# Altium project rev02.PrjPcb (part 1 of 2)
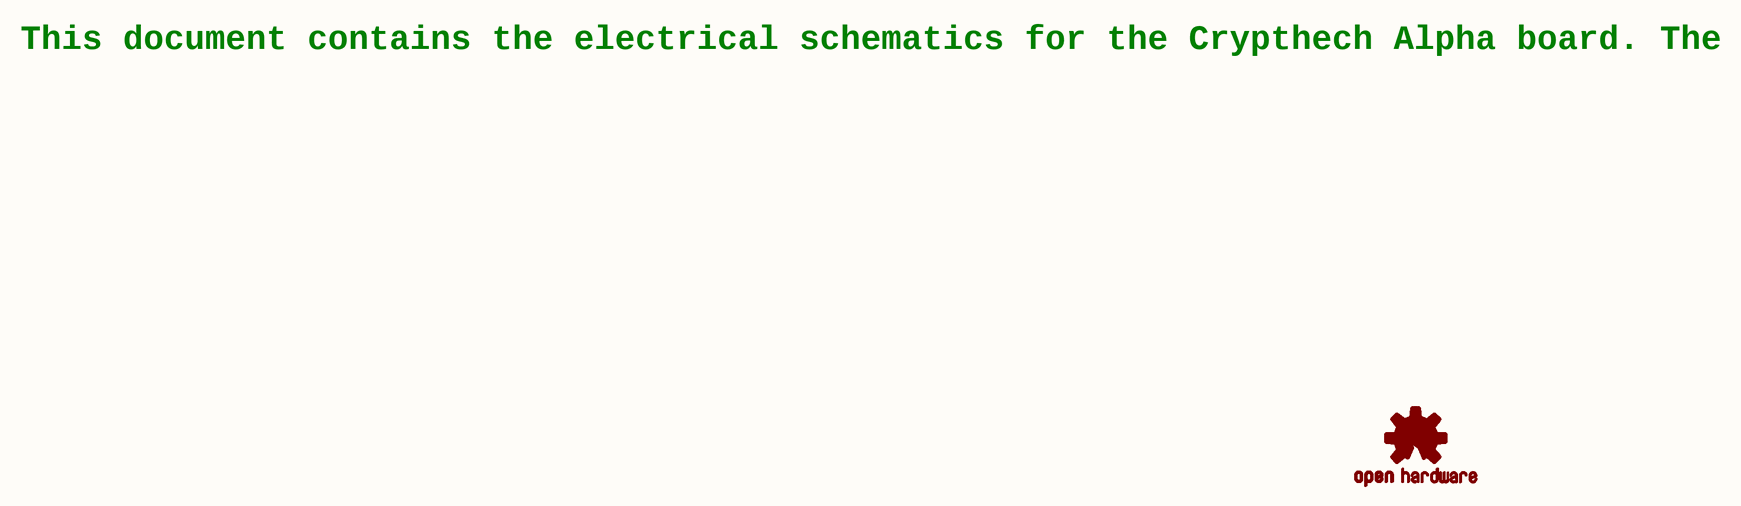
[diagram p0: rev02_0.SchDoc]
26 sheets, 386 parts. Net scope: global (net labels, ports and power ports of the same name join across sheets).
Board file: CrypTech.PcbDoc
Sheets:
  rev02_0.SchDoc
  rev02_1.SchDoc
  rev02_2.SchDoc
  rev02_3.SchDoc
  rev02_4.SchDoc
  rev02_5.SchDoc
  rev02_6.SchDoc
  rev02_7.SchDoc
  rev02_8.SchDoc
  rev02_9.SchDoc
  rev02_10.SchDoc
  rev02_11.SchDoc
  rev02_12.SchDoc
  rev02_13.SchDoc
  rev02_14.SchDoc
  rev02_15.SchDoc
  rev02_16.SchDoc
  rev02_17.SchDoc
  rev02_18.SchDoc
  rev02_19.SchDoc
  rev02_20.SchDoc
  rev02_21.SchDoc
  rev02_22.SchDoc
  rev02_23.SchDoc
  rev02_24.SchDoc
  rev02_25.SchDoc

## Sheet rev02_0.SchDoc
size 409 x 282 mm

### Parts
LOGO1  OSHW-LOGOL-COPPER  [OSHW-LOGO-L_COPPER]  (value not drawn)

### Notes on the sheet
- This document contains the electrical schematics for the Crypthech Alpha board.
  The latest version of these schematics can be found here:
  https://wiki.cryptech.is/browser/hardware/eagle/alpha
  For more information about the Alpha board including functionality, goals
  and block diagram, please see:
  https://wiki.cryptech.is/wiki/AlphaBoardStrategy
  For more information about the Cryptech project, please see:
  https://cryptech.is/

### Library data of the parts
LOGO1 = OSHW-LOGOL-COPPER: Open Source Hardware Logo as defined here :http://freedomdefined.org/OSHW

## Sheet rev02_1.SchDoc
size 409 x 282 mm
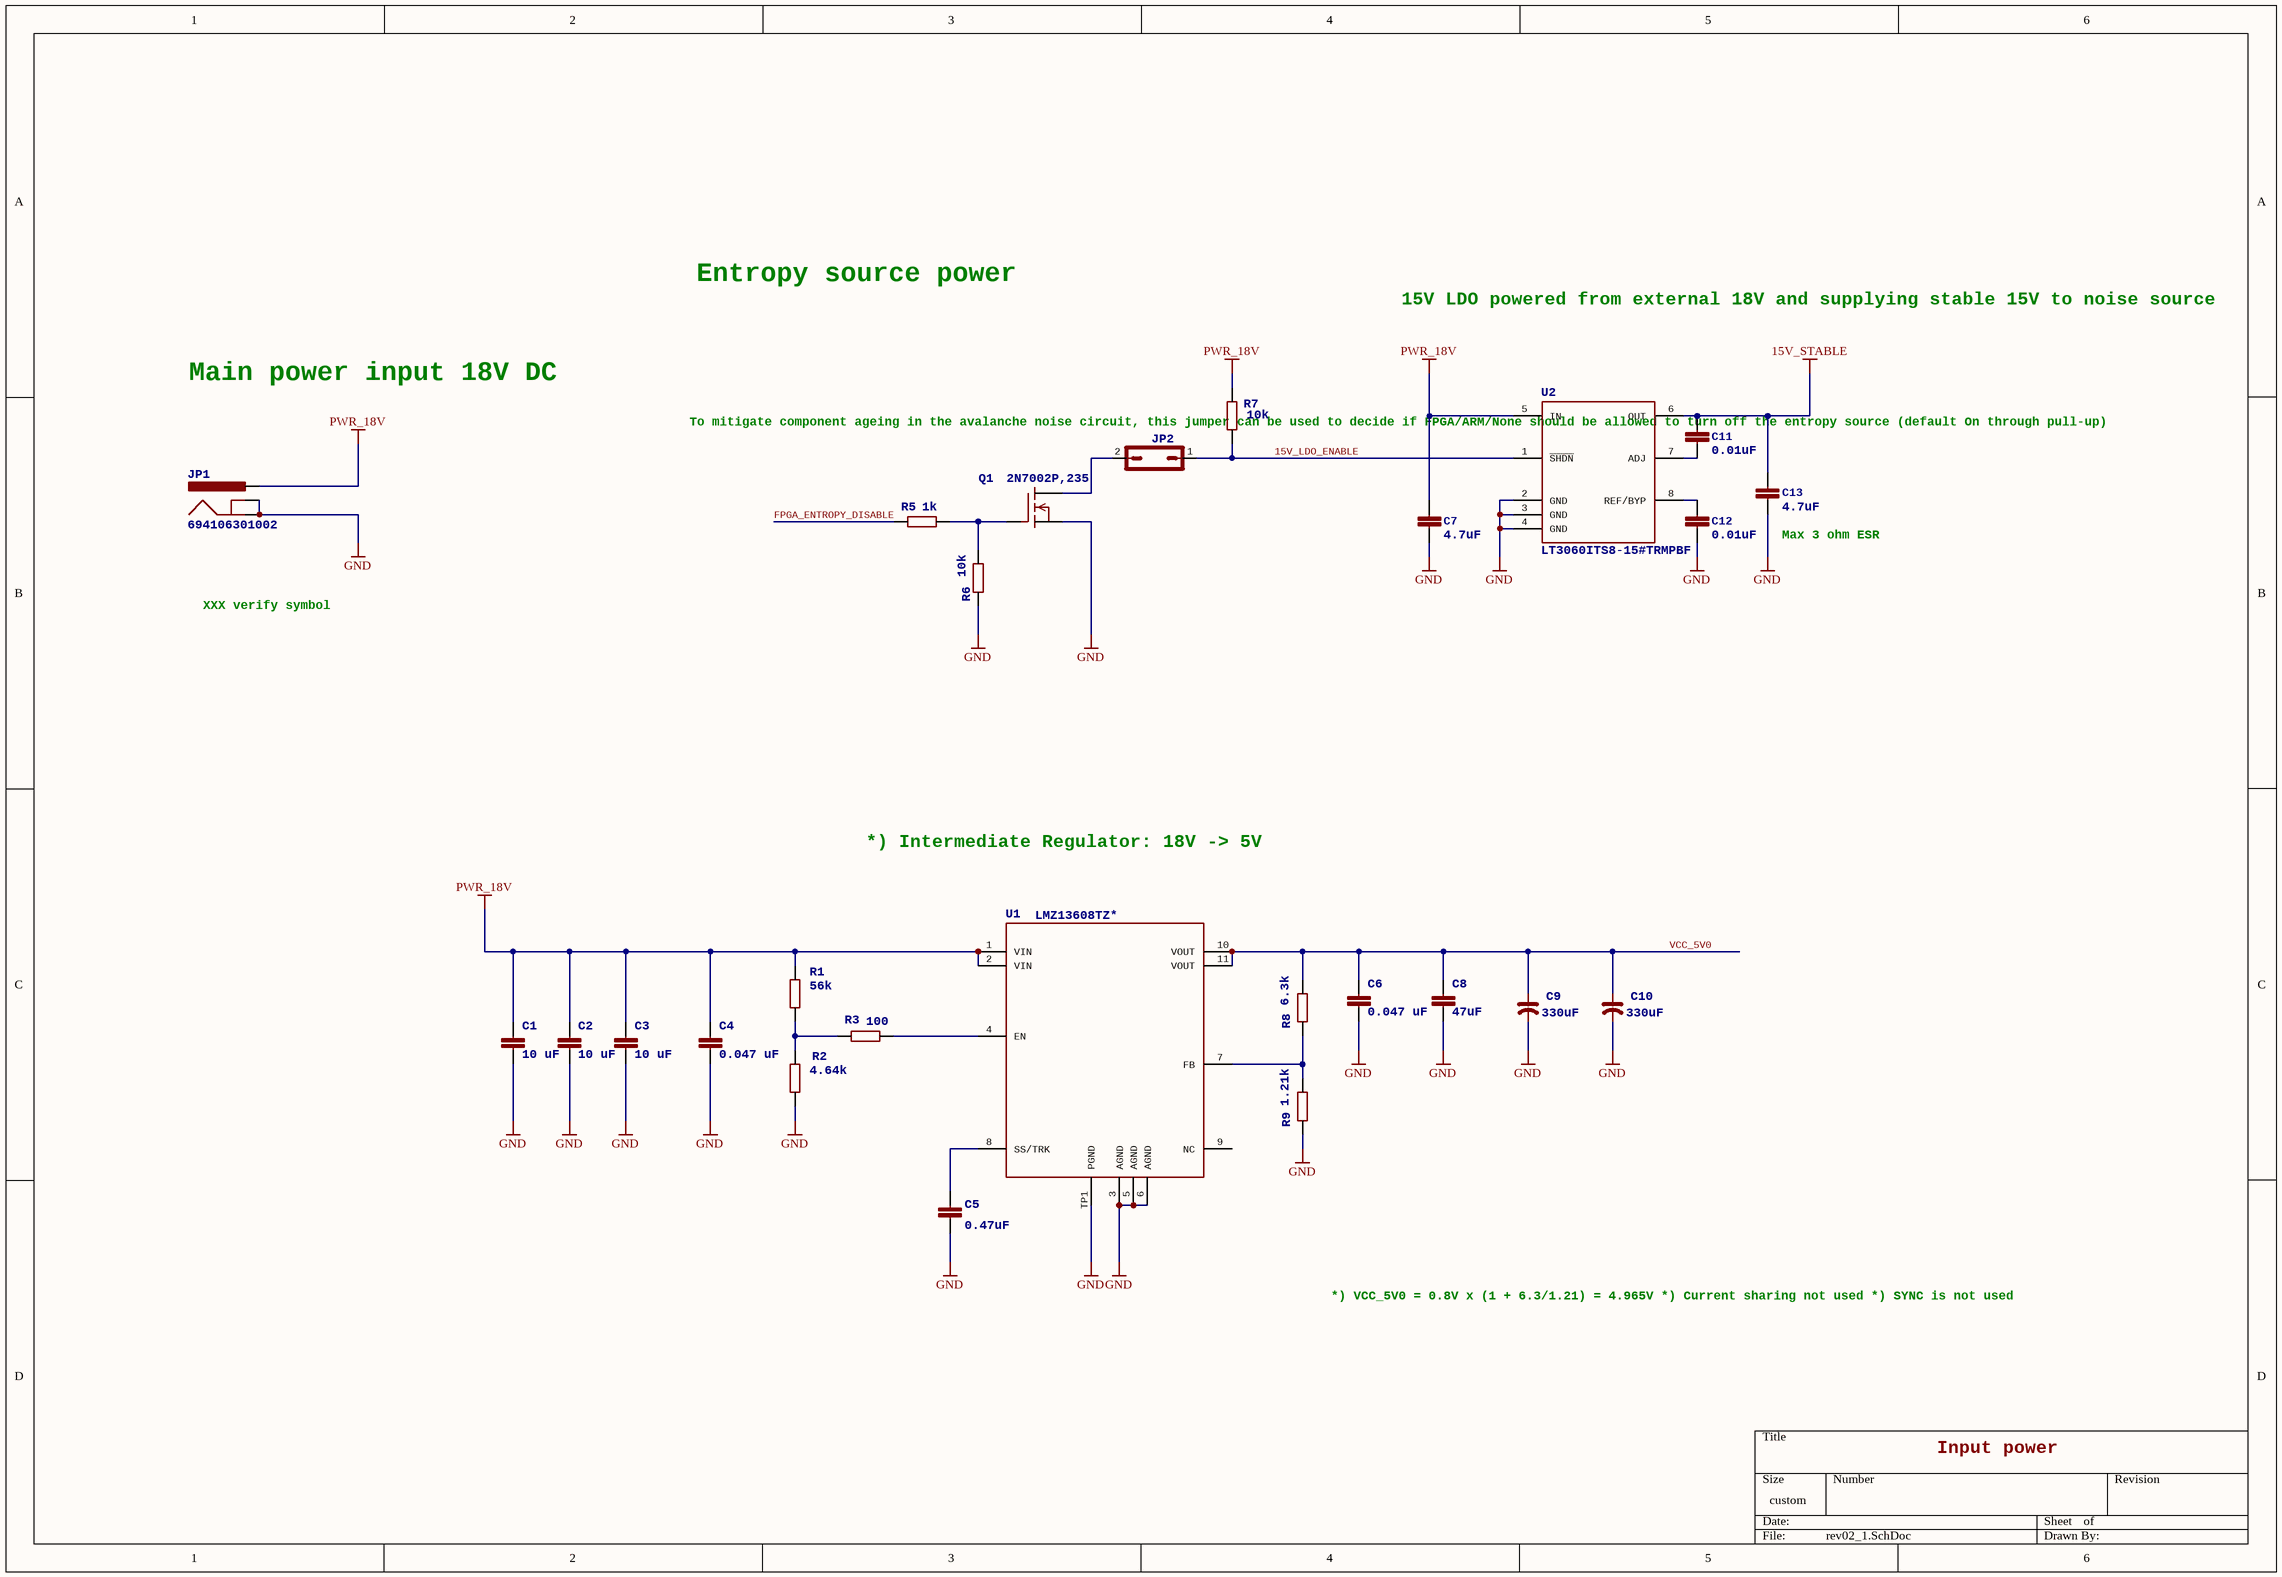
[diagram p1: rev02_1.SchDoc]

### Parts
C1  value 10 uF  >NAME: C1  [C_1210]
C2  value 10 uF  >NAME: C2  [C_1210]
C3  value 10 uF  >NAME: C3  [C_1210]
C4  value 0.047 uF  >NAME: C4  [C_0402]
C5  value 0.47uF  [C_0402]  (hidden comment: GRM155R61A474KE15D)
C6  value 0.047 uF  >NAME: C6  [C_0402]
C7  value 4.7uF  [C_0805]  (hidden comment: TMK212AB7475KG-T)
C8  value 47uF  >NAME: C8  [C_1210]  (hidden comment: GRM32ER70J476ME20L)
C9  value 330uF  [C_D]  (hidden comment: T520D337M006ATE015)
C10  value 330uF  [C_D]  (hidden comment: T520D337M006ATE015)
C11  value 0.01uF  [C_0402]
C12  value 0.01uF  [C_0402]
C13  value 4.7uF  [C_0805]  (hidden comment: TMK212AB7475KG-T)
JP1  694106301002  [694106301002]
JP2  >NAME: JP2  [PLS-2]  (hidden comment: 61300211121)
Q1  2N7002P,235  >NAME: Q1  [SOT-23]
R1  value 56k  [R_0402]
R2  value 4.64k  [R_0402]
R3  value 100  >NAME: R3  [R_0402]
R5  value 1k  [R_0402]
R6  value 10k  >NAME: R6  [R_0402]
R7  value 10k  >NAME: R7  [R_0402]
R8  value 6.3k  [R_0402]
R9  value 1.21k  [R_0402]
U1  LMZ13608TZ*  [NDY]
U2  LT3060ITS8-15#TRMPBF  [TSOT-8-23]

### Nets
15V_STABLE: C11.2 C13.1 U2.6(OUT)
GND: C1.2 C2.2 C3.2 C4.2 C5.2 C6.2 C7.2 C8.2 C9.2(-) C10.2(-) C12.1 C13.2 JP1.2(GND) JP1.3(GNDBREAK) Q1.2(S) R2.1 R6.2 R9.1 U1.3(AGND) U1.5(AGND) U1.6(AGND) U1.TP1(PGND) U2.2(GND) U2.3(GND) U2.4(GND)
PWR_18V: C1.1 C2.1 C3.1 C4.1 C7.1 JP1.1(PWR) R1.2 R7.1 U1.1(VIN) U1.2(VIN) U2.5(IN)
VCC_5V0: C6.1 C8.1 C9.1(+) C10.1(+) R8.2 U1.10(VOUT) U1.11(VOUT)
15V_LDO_ENABLE: JP2.1 R7.2 U2.1(~{SHDN})
FPGA_ENTROPY_DISABLE: R5.1
NetC5_1: C5.1 U1.8(SS/TRK)
NetC11_1: C11.1 U2.7(ADJ)
NetC12_2: C12.2 U2.8(REF/BYP)
NetJP2_2: JP2.2 Q1.3(D)
NetQ1_1: Q1.1(G) R5.2 R6.1
NetR1_1: R1.1 R2.2 R3.1
NetR3_2: R3.2 U1.4(EN)
NetR8_1: R8.1 R9.2 U1.7(FB)

Not connected (* = marked no-connect by the designer): U1 9(NC)

### Notes on the sheet
- Entropy source power
- 15V LDO powered from external 18V
  and supplying stable 15V to noise source
- Main power input
  18V DC
- To mitigate component ageing in the avalanche noise circuit,
  this jumper can be used to decide if FPGA/ARM/None should
  be allowed to turn off the entropy source
  (default On through pull-up)
- (near C13) Max 3 ohm ESR
- XXX verify symbol
- *) Intermediate Regulator: 18V -> 5V
- *) VCC_5V0 = 0.8V x (1 + 6.3/1.21) = 4.965V
  *) Current sharing not used
  *) SYNC is not used
- Input power

### Library data of the parts
C1-C3 = C-EUC1210: 1210 CAPACITOR; DIELECTRIC: X7R; RATED_VOLTAGE: 50V; TOLERANCE: 10%
C4 C6 = C-EUC0402: 0402 CAPACITOR; DIELECTRIC: X7R; RATED_VOLTAGE: 50V; TOLERANCE: 10%
C5 = C-EUC0402: 0402 CAPACITOR; DIELECTRIC: X5R; RATED_VOLTAGE: 6.3V; TOLERANCE: 10%; >NAME: C124
C7 C13 = C-EUC0603: 0805 CAPACITOR X7R 25V
C8 = C-EUC1210: 1210 CAPACITOR X5R 6.3V; RATED_VOLTAGE: 16V; TOLERANCE: 20%; DIELECTRIC: X5R
C9 C10 = CP_E-035X080: Kemet Tantalum Capacitor
C11 C12 = C-EUC0402: 0402 CAPACITOR
JP1 = POWER_JACKSMD: Wurth Power Connector 5.5x2.1mm Barrel; PROD_ID: CONN-08106; SF_ID: PRT-12748
JP2 = JP1Q: Wurth 2pins connector (for jumper); >VALUE: JP1Q
Q1 = 2N7002: OnSemi FET; >VALUE: 2N7002
R1 R2 R8 R9 = R-EU_R0402: 0402 Resistor 1%
R3 R5-R7 = R-EU_R0402: 0402 Resistor 5%
  R3 R6 R7: TOLERANCE: 5%
U1 = LMZ13608: 8-A SIMPLE SWITCHER® Power Module With 36-V Maximum Input Voltage; MPN: LMZ13608TZ/NOPB; OC_FARNELL: 2492265; PACKAGE: NDY (11); SUPPLIER: Texas Instruments
U2 = LT3060ITS8-15: Micropower, Low Noise, 100mA LDO, Linear Regulator; SUPPLIER: Linear Technology; MPN: LT3060ITS8-15#TRMPBF; OC_FARNELL: 2471073

## Sheet rev02_2.SchDoc
size 409 x 282 mm
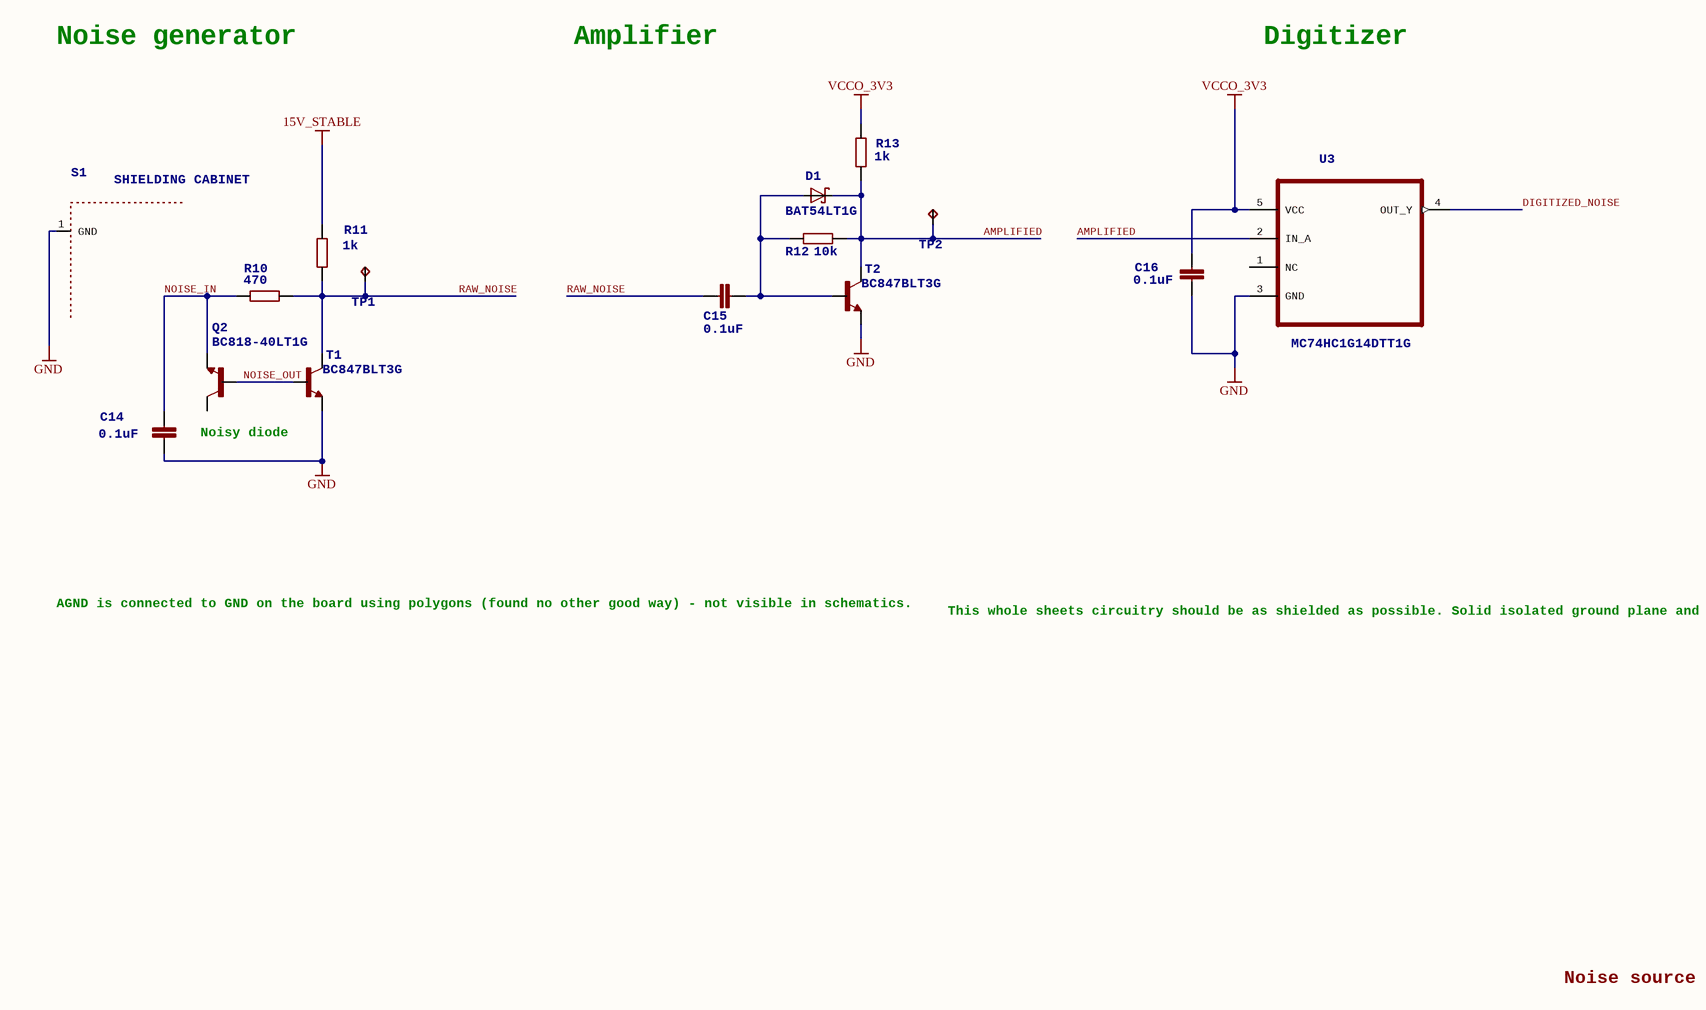
[diagram p2: rev02_2.SchDoc]

### Parts
C14  value 0.1uF  [C_0402]
C15  value 0.1uF  [C_0402]
C16  value 0.1uF  [C_0402]
D1  BAT54LT1G  [SOT-23]
Q2  BC818-40LT1G  [SOT-23]
R10  value 470  [R_0402]
R11  value 1k  [R_0402]
R12  value 10k  [R_0402]
R13  value 1k  [R_0402]
S1  SHIELDING CABINET  [WE-SHC_36103205_NO_CREAM]
T1  BC847BLT3G  [SOT-23]
T2  BC847BLT3G  [SOT-23]
TP1  TPB1,27  [B1,27]  (value not drawn)
TP2  TPB1,27  [B1,27]  (value not drawn)
U3  >NAME: U3  [SOT-23-5]  (hidden comment: MC74HC1G14DTT1G)

### Nets
15V_STABLE: R11.1
GND: C14.1 C16.1 S1.1(GND) T1.2(E) T2.2(E) U3.3(GND)
VCCO_3V3: C16.2 R13.2 U3.5(VCC)
AMPLIFIED: D1.3(C) R12.2 R13.1 T2.3(C) TP2.TP U3.2(IN_A)
DIGITIZED_NOISE: U3.4(OUT_Y)
NOISE_IN: C14.2 Q2.2(E) R10.2
NOISE_OUT: Q2.1(B) T1.1(B)
RAW_NOISE: C15.1 R10.1 R11.2 T1.3(C) TP1.TP
NetC15_2: C15.2 D1.1(A) R12.1 T2.1(B)

Not connected (* = marked no-connect by the designer): Q2 3(C); U3 1(NC)

### Notes on the sheet
- Noise generator
- Amplifier
- Digitizer
- Noisy diode
- AGND is connected to GND on the board using polygons
  (found no other good way) - not visible in schematics.
- This whole sheets circuitry should be as shielded as possible.
  Solid isolated ground plane and internal planes connected
  to the rest of the board at a single point is expected.
- Noise source

### Library data of the parts
C14-C16 = C-EUC0603: 0402 CAPACITOR
D1 = BAT54: OnSemi Schottky Diode
Q2 T1 T2 = BC818*SMD: NPN Transistor
R10-R13 = R-EU_R0402: 0402 Resistor 1%
S1 = WE-SHC: WE-SHC Shielding cabinet
TP1 TP2 = TPB1,27: Test pad
U3 = MC74HC1G14DTT1G: Single Inverter with Schmitt-Trigger Input; MPN: MC74HC1G14DTT1G; OC_FARNELL: 1468757; OC_NEWARK: 71J5593; PACKAGE: SOT-23-5; SUPPLIER: ON SEMICONDUCTOR; >VALUE: MC74HC1G14DTT1G

## Sheet rev02_3.SchDoc
size 409 x 282 mm
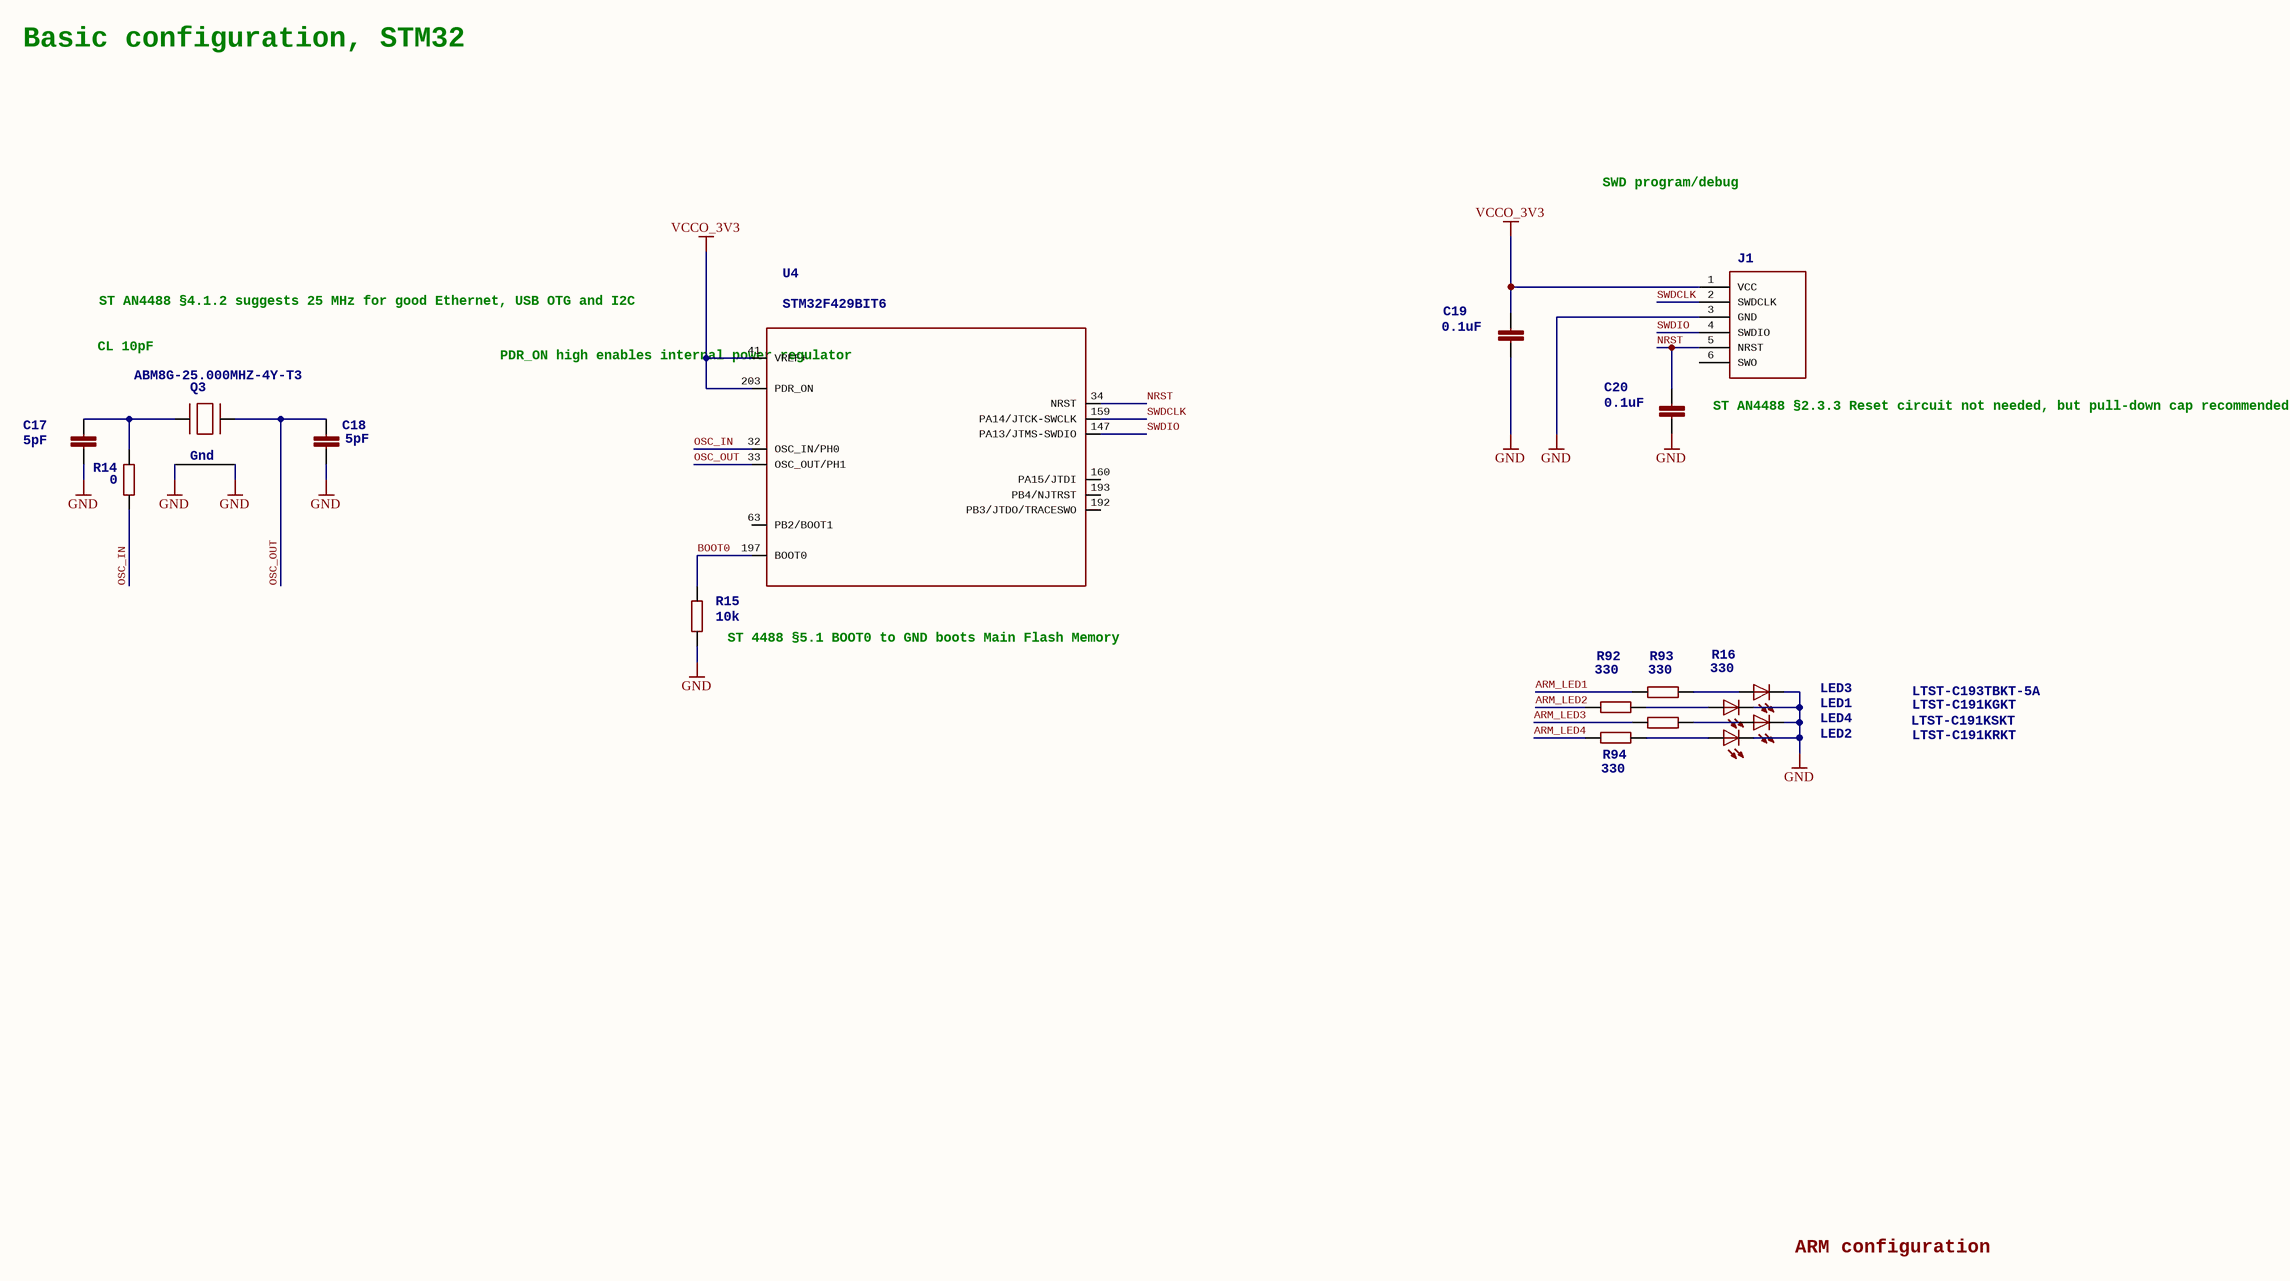
[diagram p3: rev02_3.SchDoc]

### Parts
C17  value 5pF  [C_0402]
C18  value 5pF  [C_0402]
C19  value 0.1uF  [C_0402]
C20  value 0.1uF  [C_0402]
J1  STM32-SWD  [PLS-6]  (value not drawn)
LED1  LTST-C191KGKT  [VD_0603]
LED2  LTST-C191KRKT  [VD_0603]
LED3  LTST-C193TBKT-5A  [VD_0603]
LED4  LTST-C191KSKT  [VD_0603]
Q3  ABM8G-25.000MHZ-4Y-T3  >NAME: Q3  [CRYSTAL_3.2X2.5]
R14  value 0  >NAME: R14  [R_0402]
R15  value 10k  >NAME: R15  [R_0402]
R16  value 330  [R_0402]
R92  value 330  [R_0402]
R93  value 330  [R_0402]
R94  value 330  [R_0402]
U4  >NAME: U4  (hidden comment: STM32F429BIT6)  (part B of 4)

### Nets
GND: C17.1 C18.1 C19.2 C20.2 J1.3(GND) LED1.2(C) LED2.2(C) LED3.2(C) LED4.2(C) Q3.2(G2) Q3.4(G1) R15.1
VCCO_3V3: C19.1 J1.1(VCC) U4.41(VREF+) U4.203(PDR_ON)
ARM_LED1: R93.2
ARM_LED2: R92.2
ARM_LED3: R16.2
ARM_LED4: R94.2
BOOT0: R15.2 U4.197(BOOT0)
NRST: C20.1 J1.5(NRST) U4.34(NRST)
OSC_IN: R14.1 U4.32(OSC_IN/PH0)
OSC_OUT: C18.2 Q3.3(X2) U4.33(OSC_OUT/PH1)
SWDCLK: J1.2(SWDCLK) U4.159(PA14/JTCK-SWCLK)
SWDIO: J1.4(SWDIO) U4.147(PA13/JTMS-SWDIO)
NetC17_2: C17.2 Q3.1(X1) R14.2
NetLED1_1: LED1.1(A) R92.1
NetLED2_1: LED2.1(A) R94.1
NetLED3_1: LED3.1(A) R93.1
NetLED4_1: LED4.1(A) R16.1

Not connected (* = marked no-connect by the designer): J1 6(SWO); U4 63(PB2/BOOT1) 160(PA15/JTDI) 192(PB3/JTDO/TRACESWO) 193(PB4/NJTRST)

### Notes on the sheet
- Basic configuration, STM32
- SWD program/debug
- ST AN4488 §4.1.2
  suggests 25 MHz for good
  Ethernet, USB OTG and I2C
- CL 10pF
- (near U4) PDR_ON high enables
  internal power regulator
- ST AN4488 §2.3.3
  Reset circuit not needed,
  but pull-down cap
  recommended.
- (near R15) ST 4488 §5.1
  BOOT0 to GND boots
  Main Flash Memory
- ARM configuration

### Library data of the parts
C17-C20 = C-EUC0402: 0402 CAPACITOR
J1 = STM32-SWD: STM32 SWD connector
LED1 = LEDCHIP-LED0603: GREEN LED
LED2 = LEDCHIP-LED0603: RED LED
LED3 = LEDCHIP-LED0603: BLUE LED
LED4 = LEDCHIP-LED0603: YELLOW LED
Q3 = XTAL-4-3225: Abracon 25MHz 10pF 4-pin 3.2 x 2.5mm crystal; MPN: ABM8G-25.000MHZ-4Y-T3; OC_FARNELL: 2467848; >VALUE: XTAL-4-3225; Gnd: Gnd
R14-R16 R92-R94 = R-EU_R0402: 0402 Resistor 5%
  R15: TOLERANCE: 5%
U4 = STM32F429BIT6: STM32F429 Cortex-M4 CPU / 180 MHz, 256 KB RAM, 2 MB Flash; OC_FARNELL: 2469581; >VALUE: STM32F429BIT6

## Sheet rev02_4.SchDoc
size 409 x 282 mm
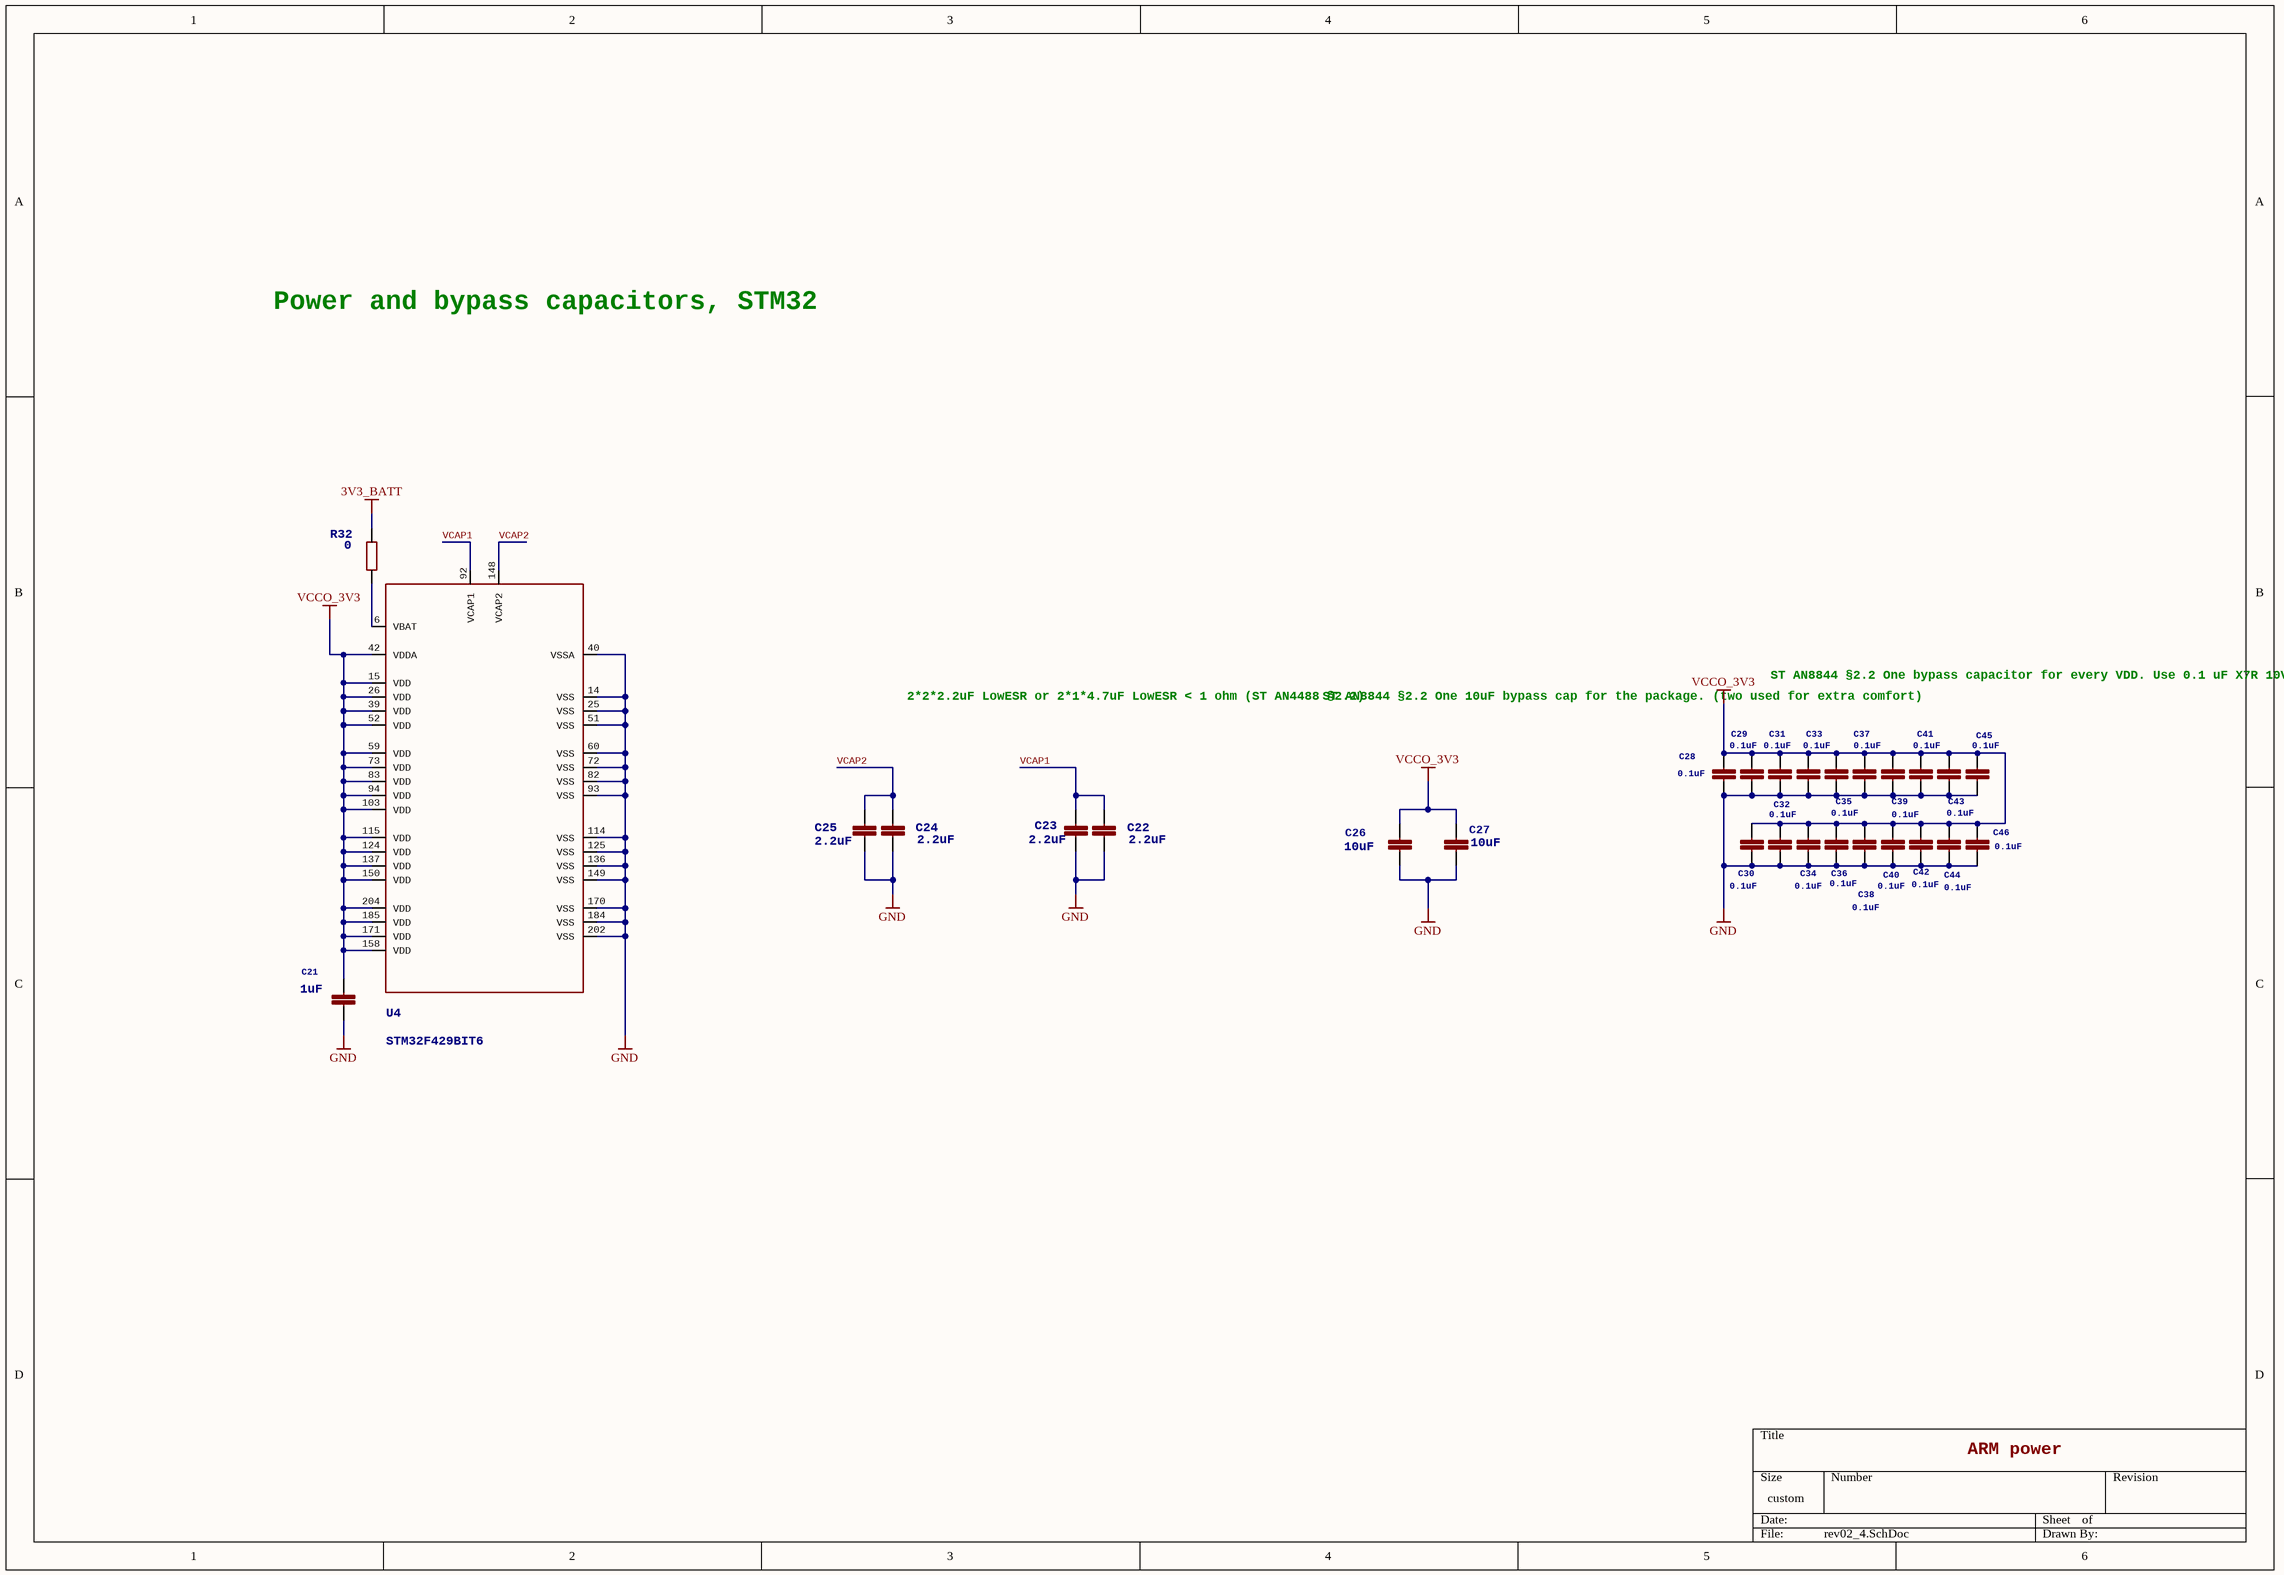
[diagram p4: rev02_4.SchDoc]

### Parts
C21  value 1uF  [C_0603]
C22  value 2.2uF  [C_0603]
C23  value 2.2uF  [C_0603]
C24  value 2.2uF  [C_0603]
C25  value 2.2uF  [C_0603]
C26  value 10uF  [C_0805]
C27  value 10uF  [C_0805]
C28  value 0.1uF  [C_0402]
C29  value 0.1uF  [C_0402]
C30  value 0.1uF  [C_0402]
C31  value 0.1uF  [C_0402]
C32  value 0.1uF  [C_0402]
C33  value 0.1uF  [C_0402]
C34  value 0.1uF  [C_0402]
C35  value 0.1uF  [C_0402]
C36  value 0.1uF  [C_0402]
C37  value 0.1uF  [C_0402]
C38  value 0.1uF  [C_0402]
C39  value 0.1uF  [C_0402]
C40  value 0.1uF  [C_0402]
C41  value 0.1uF  [C_0402]
C42  value 0.1uF  [C_0402]
C43  value 0.1uF  [C_0402]
C44  value 0.1uF  [C_0402]
C45  value 0.1uF  [C_0402]
C46  value 0.1uF  [C_0402]
R32  value 0  [R_0402]
U4  >NAME: U4  (hidden comment: STM32F429BIT6)  (part C of 4)

### Nets
3V3_BATT: R32.1
GND: C21.2 C22.1 C23.1 C24.1 C25.1 C26.2 C27.2 C28.2 C29.2 C30.2 C31.2 C32.2 C33.2 C34.2 C35.2 C36.2 C37.2 C38.2 C39.2 C40.2 C41.2 C42.2 C43.2 C44.2 C45.2 C46.2 U4.14(VSS) U4.25(VSS) U4.40(VSSA) U4.51(VSS) U4.60(VSS) U4.72(VSS) U4.82(VSS) U4.93(VSS) U4.114(VSS) U4.125(VSS) U4.136(VSS) U4.149(VSS) U4.170(VSS) U4.184(VSS) U4.202(VSS)
VCCO_3V3: C21.1 C26.1 C27.1 C28.1 C29.1 C30.1 C31.1 C32.1 C33.1 C34.1 C35.1 C36.1 C37.1 C38.1 C39.1 C40.1 C41.1 C42.1 C43.1 C44.1 C45.1 C46.1 U4.15(VDD) U4.26(VDD) U4.39(VDD) U4.42(VDDA) U4.52(VDD) U4.59(VDD) U4.73(VDD) U4.83(VDD) U4.94(VDD) U4.103(VDD) U4.115(VDD) U4.124(VDD) U4.137(VDD) U4.150(VDD) U4.158(VDD) U4.171(VDD) U4.185(VDD) U4.204(VDD)
VCAP1: C22.2 C23.2 U4.92(VCAP1)
VCAP2: C24.2 C25.2 U4.148(VCAP2)
NetR32_2: R32.2 U4.6(VBAT)

### Notes on the sheet
- Power and bypass capacitors, STM32
- ST AN8844 §2.2
  One bypass capacitor for every VDD.
  Use 0.1 uF X7R 10V.
- 2*2*2.2uF LowESR or
  2*1*4.7uF LowESR
  < 1 ohm
  (ST AN4488 §2.2)
- ST AN8844 §2.2
  One 10uF bypass cap for the package.
  (two used for extra comfort)
- ARM power

### Library data of the parts
C21-C25 = C-EUC0603: 0603 CAPACITOR
C26 C27 = C-EUC0805: 0805 CAPACITOR
C28-C46 = C-EUC0402: 0402 CAPACITOR
R32 = R-EU_R0402: 0402 Resistor 5%
U4 = STM32F429BIT6: as U4 on sheet rev02_3; OC_FARNELL: 2469581; >VALUE: STM32F429BIT6

## Sheet rev02_5.SchDoc
size 409 x 282 mm
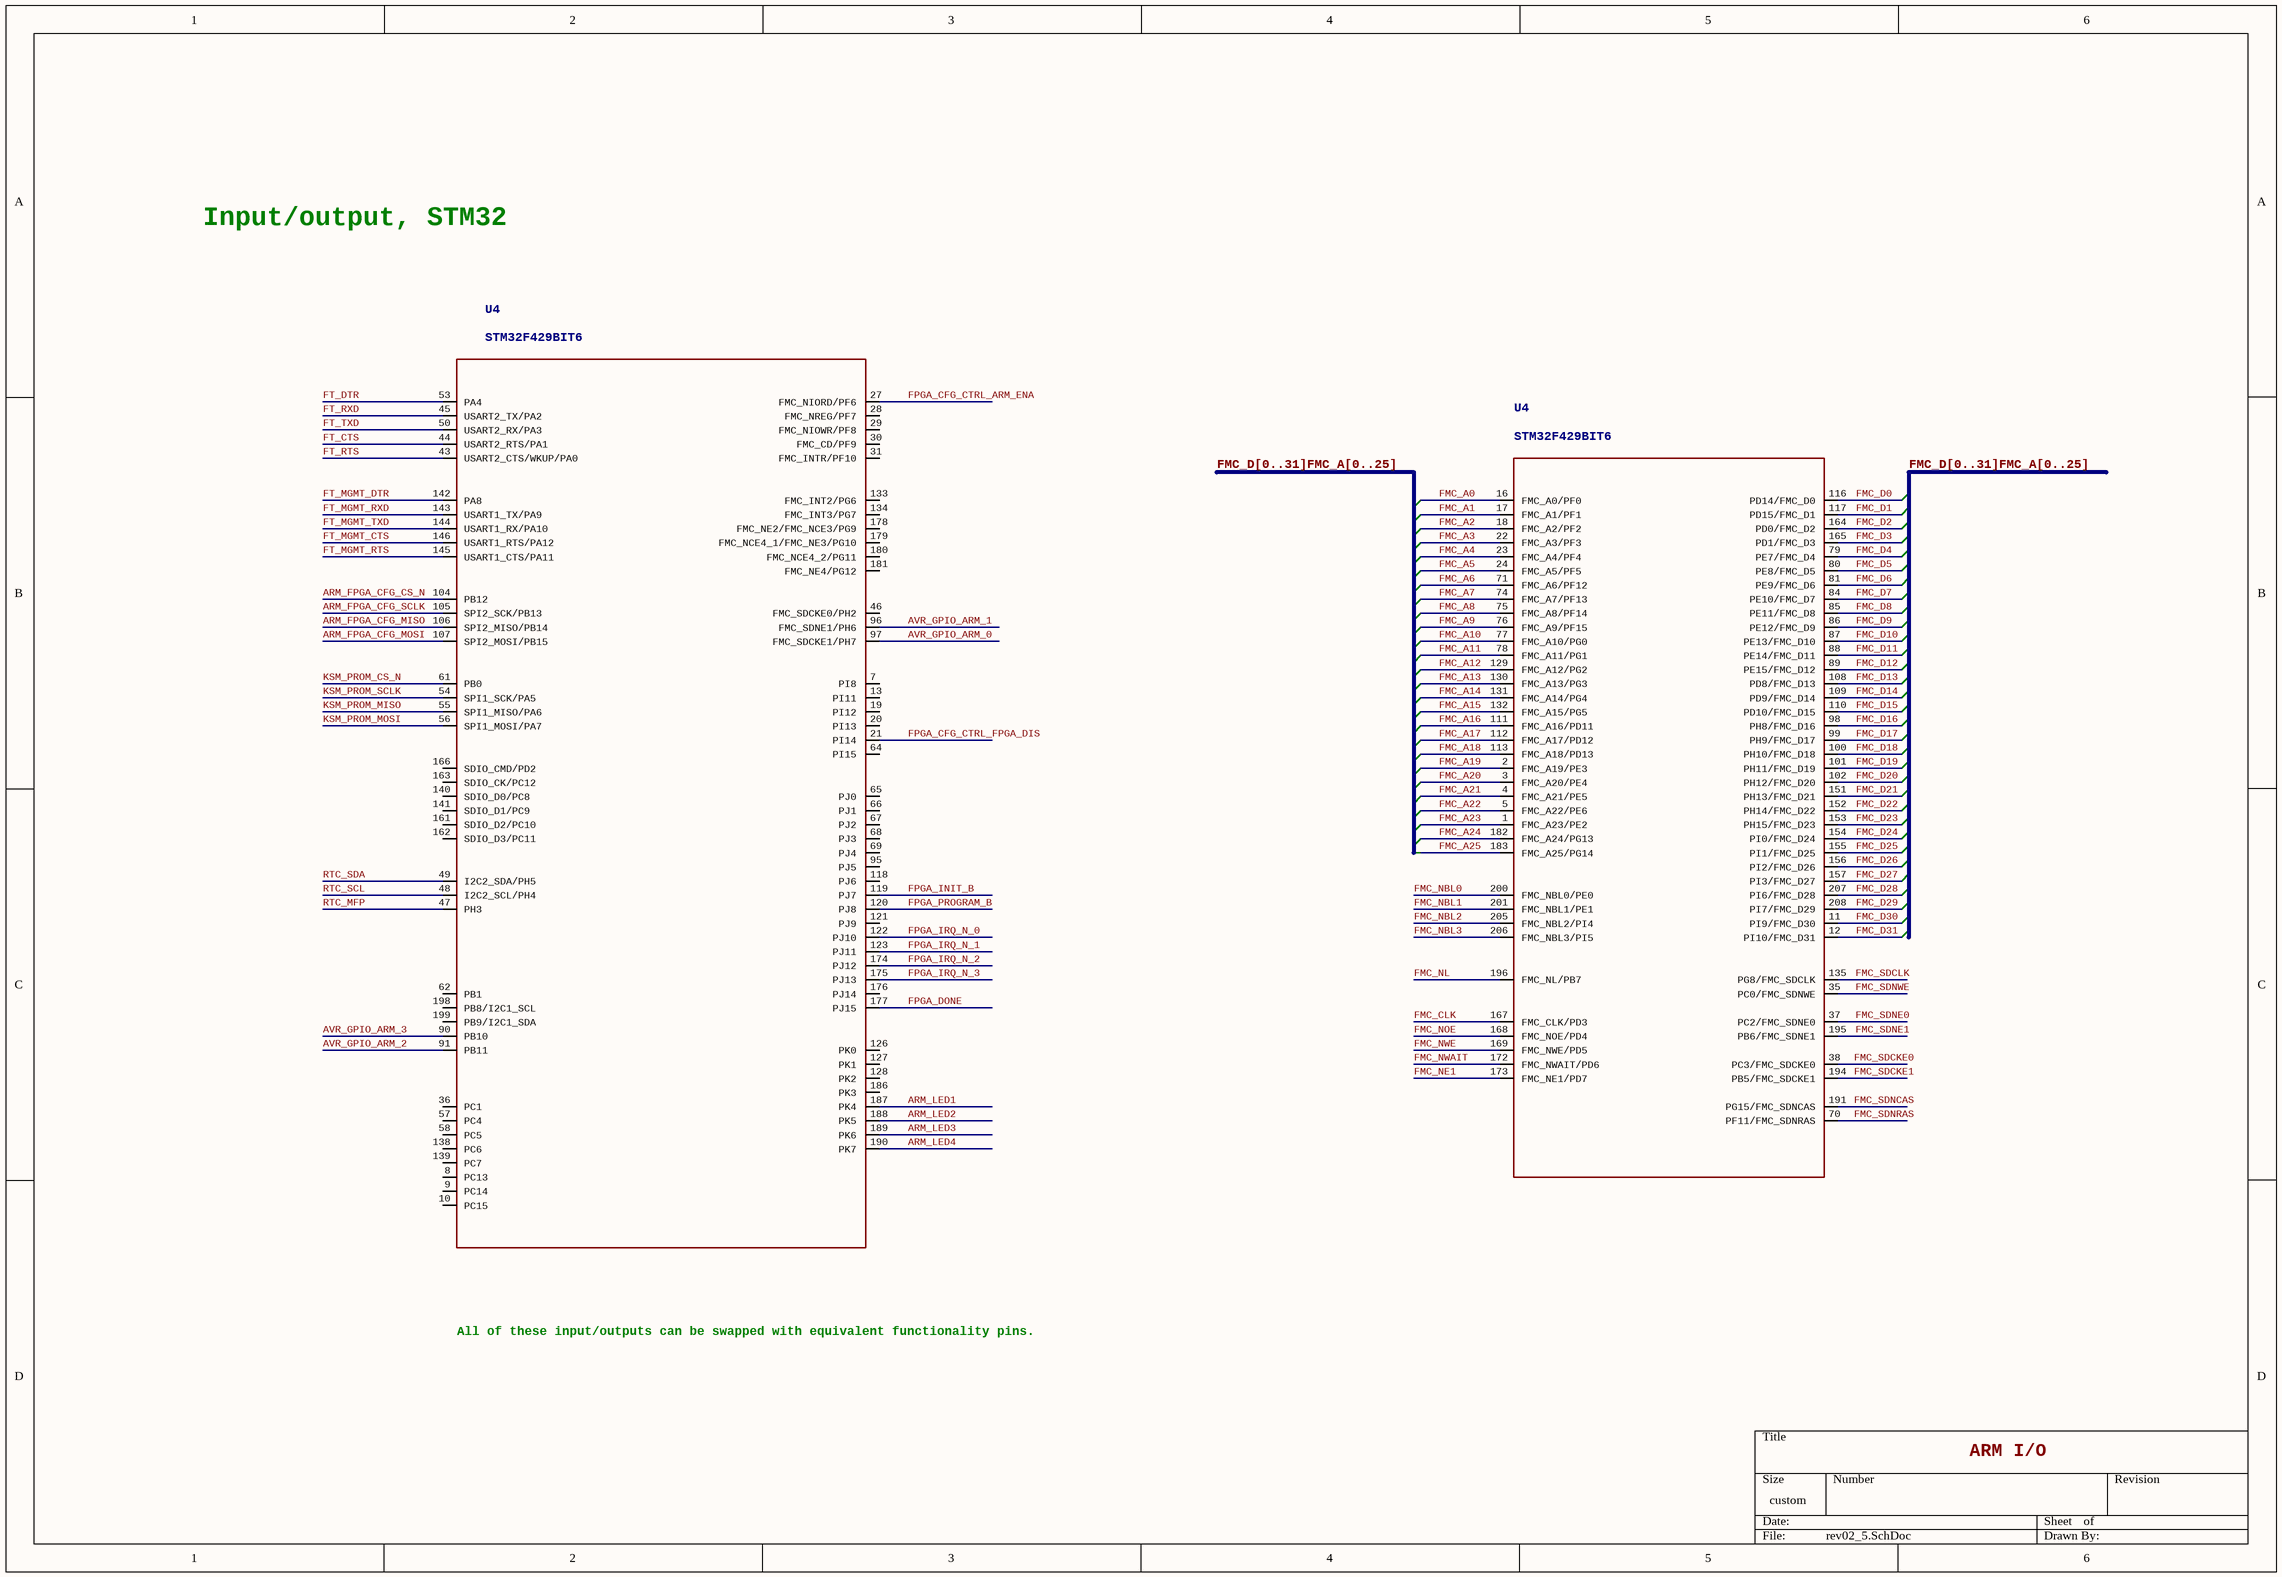
[diagram p5: rev02_5.SchDoc]

### Parts
U4  >NAME: U4  [TSQFP50P3000X3000X160-208N]  (hidden comment: STM32F429BIT6)  (parts A,D of 4)

### Nets
ARM_FPGA_CFG_CS_N: U4.104(PB12)
ARM_FPGA_CFG_MISO: U4.106(SPI2_MISO/PB14)
ARM_FPGA_CFG_MOSI: U4.107(SPI2_MOSI/PB15)
ARM_FPGA_CFG_SCLK: U4.105(SPI2_SCK/PB13)
ARM_LED1: U4.187(PK4)
ARM_LED2: U4.188(PK5)
ARM_LED3: U4.189(PK6)
ARM_LED4: U4.190(PK7)
AVR_GPIO_ARM_0: U4.97(FMC_SDCKE1/PH7)
AVR_GPIO_ARM_1: U4.96(FMC_SDNE1/PH6)
AVR_GPIO_ARM_2: U4.91(PB11)
AVR_GPIO_ARM_3: U4.90(PB10)
FMC_A0: U4.16(FMC_A0/PF0)
FMC_A1: U4.17(FMC_A1/PF1)
FMC_A2: U4.18(FMC_A2/PF2)
FMC_A3: U4.22(FMC_A3/PF3)
FMC_A4: U4.23(FMC_A4/PF4)
FMC_A5: U4.24(FMC_A5/PF5)
FMC_A6: U4.71(FMC_A6/PF12)
FMC_A7: U4.74(FMC_A7/PF13)
FMC_A8: U4.75(FMC_A8/PF14)
FMC_A9: U4.76(FMC_A9/PF15)
FMC_A10: U4.77(FMC_A10/PG0)
FMC_A11: U4.78(FMC_A11/PG1)
FMC_A12: U4.129(FMC_A12/PG2)
FMC_A13: U4.130(FMC_A13/PG3)
FMC_A14: U4.131(FMC_A14/PG4)
FMC_A15: U4.132(FMC_A15/PG5)
FMC_A16: U4.111(FMC_A16/PD11)
FMC_A17: U4.112(FMC_A17/PD12)
FMC_A18: U4.113(FMC_A18/PD13)
FMC_A19: U4.2(FMC_A19/PE3)
FMC_A20: U4.3(FMC_A20/PE4)
FMC_A21: U4.4(FMC_A21/PE5)
FMC_A22: U4.5(FMC_A22/PE6)
FMC_A23: U4.1(FMC_A23/PE2)
FMC_A24: U4.182(FMC_A24/PG13)
FMC_A25: U4.183(FMC_A25/PG14)
FMC_CLK: U4.167(FMC_CLK/PD3)
FMC_D0: U4.116(PD14/FMC_D0)
FMC_D1: U4.117(PD15/FMC_D1)
FMC_D2: U4.164(PD0/FMC_D2)
FMC_D3: U4.165(PD1/FMC_D3)
FMC_D4: U4.79(PE7/FMC_D4)
FMC_D5: U4.80(PE8/FMC_D5)
FMC_D6: U4.81(PE9/FMC_D6)
FMC_D7: U4.84(PE10/FMC_D7)
FMC_D8: U4.85(PE11/FMC_D8)
FMC_D9: U4.86(PE12/FMC_D9)
FMC_D10: U4.87(PE13/FMC_D10)
FMC_D11: U4.88(PE14/FMC_D11)
FMC_D12: U4.89(PE15/FMC_D12)
FMC_D13: U4.108(PD8/FMC_D13)
FMC_D14: U4.109(PD9/FMC_D14)
FMC_D15: U4.110(PD10/FMC_D15)
FMC_D16: U4.98(PH8/FMC_D16)
FMC_D17: U4.99(PH9/FMC_D17)
FMC_D18: U4.100(PH10/FMC_D18)
FMC_D19: U4.101(PH11/FMC_D19)
FMC_D20: U4.102(PH12/FMC_D20)
FMC_D21: U4.151(PH13/FMC_D21)
FMC_D22: U4.152(PH14/FMC_D22)
FMC_D23: U4.153(PH15/FMC_D23)
FMC_D24: U4.154(PI0/FMC_D24)
FMC_D25: U4.155(PI1/FMC_D25)
FMC_D26: U4.156(PI2/FMC_D26)
FMC_D27: U4.157(PI3/FMC_D27)
FMC_D28: U4.207(PI6/FMC_D28)
FMC_D29: U4.208(PI7/FMC_D29)
FMC_D30: U4.11(PI9/FMC_D30)
FMC_D31: U4.12(PI10/FMC_D31)
FMC_NBL0: U4.200(FMC_NBL0/PE0)
FMC_NBL1: U4.201(FMC_NBL1/PE1)
FMC_NBL2: U4.205(FMC_NBL2/PI4)
FMC_NBL3: U4.206(FMC_NBL3/PI5)
FMC_NE1: U4.173(FMC_NE1/PD7)
FMC_NL: U4.196(FMC_NL/PB7)
FMC_NOE: U4.168(FMC_NOE/PD4)
FMC_NWAIT: U4.172(FMC_NWAIT/PD6)
FMC_NWE: U4.169(FMC_NWE/PD5)
FMC_SDCKE0: U4.38(PC3/FMC_SDCKE0)
FMC_SDCKE1: U4.194(PB5/FMC_SDCKE1)
FMC_SDCLK: U4.135(PG8/FMC_SDCLK)
FMC_SDNCAS: U4.191(PG15/FMC_SDNCAS)
FMC_SDNE0: U4.37(PC2/FMC_SDNE0)
FMC_SDNE1: U4.195(PB6/FMC_SDNE1)
FMC_SDNRAS: U4.70(PF11/FMC_SDNRAS)
FMC_SDNWE: U4.35(PC0/FMC_SDNWE)
FPGA_CFG_CTRL_ARM_ENA: U4.27(FMC_NIORD/PF6)
FPGA_CFG_CTRL_FPGA_DIS: U4.21(PI14)
FPGA_DONE: U4.177(PJ15)
FPGA_INIT_B: U4.119(PJ7)
FPGA_IRQ_N_0: U4.122(PJ10)
FPGA_IRQ_N_1: U4.123(PJ11)
FPGA_IRQ_N_2: U4.174(PJ12)
FPGA_IRQ_N_3: U4.175(PJ13)
FPGA_PROGRAM_B: U4.120(PJ8)
FT_CTS: U4.44(USART2_RTS/PA1)
FT_DTR: U4.53(PA4)
FT_MGMT_CTS: U4.146(USART1_RTS/PA12)
FT_MGMT_DTR: U4.142(PA8)
FT_MGMT_RTS: U4.145(USART1_CTS/PA11)
FT_MGMT_RXD: U4.143(USART1_TX/PA9)
FT_MGMT_TXD: U4.144(USART1_RX/PA10)
FT_RTS: U4.43(USART2_CTS/WKUP/PA0)
FT_RXD: U4.45(USART2_TX/PA2)
FT_TXD: U4.50(USART2_RX/PA3)
KSM_PROM_CS_N: U4.61(PB0)
KSM_PROM_MISO: U4.55(SPI1_MISO/PA6)
KSM_PROM_MOSI: U4.56(SPI1_MOSI/PA7)
KSM_PROM_SCLK: U4.54(SPI1_SCK/PA5)
RTC_MFP: U4.47(PH3)
RTC_SCL: U4.48(I2C2_SCL/PH4)
RTC_SDA: U4.49(I2C2_SDA/PH5)

Not connected (* = marked no-connect by the designer): U4 7(PI8) 8(PC13) 9(PC14) 10(PC15) 13(PI11) 19(PI12) 20(PI13) 28(FMC_NREG/PF7) 29(FMC_NIOWR/PF8) 30(FMC_CD/PF9) 31(FMC_INTR/PF10) 36(PC1) 46(FMC_SDCKE0/PH2) 57(PC4) 58(PC5) 62(PB1) 64(PI15) 65(PJ0) 66(PJ1) 67(PJ2) 68(PJ3) 69(PJ4) 95(PJ5) 118(PJ6) 121(PJ9) 126(PK0) 127(PK1) 128(PK2) 133(FMC_INT2/PG6) 134(FMC_INT3/PG7) 138(PC6) 139(PC7) 140(SDIO_D0/PC8) 141(SDIO_D1/PC9) 161(SDIO_D2/PC10) 162(SDIO_D3/PC11) 163(SDIO_CK/PC12) 166(SDIO_CMD/PD2) 176(PJ14) 178(FMC_NE2/FMC_NCE3/PG9) 179(FMC_NCE4_1/FMC_NE3/PG10) 180(FMC_NCE4_2/PG11) 181(FMC_NE4/PG12) 186(PK3) 198(PB8/I2C1_SCL) 199(PB9/I2C1_SDA)

### Buses and harness runs
bus FMC_D[0..31]FMC_A[0..25]

### Notes on the sheet
- Input/output, STM32
- All of these input/outputs can be swapped
  with equivalent functionality pins.
- ARM I/O

### Library data of the parts
U4 = STM32F429BIT6: as U4 on sheet rev02_3; OC_FARNELL: 2469581; >VALUE: STM32F429BIT6

## Sheet rev02_6.SchDoc
size 409 x 282 mm
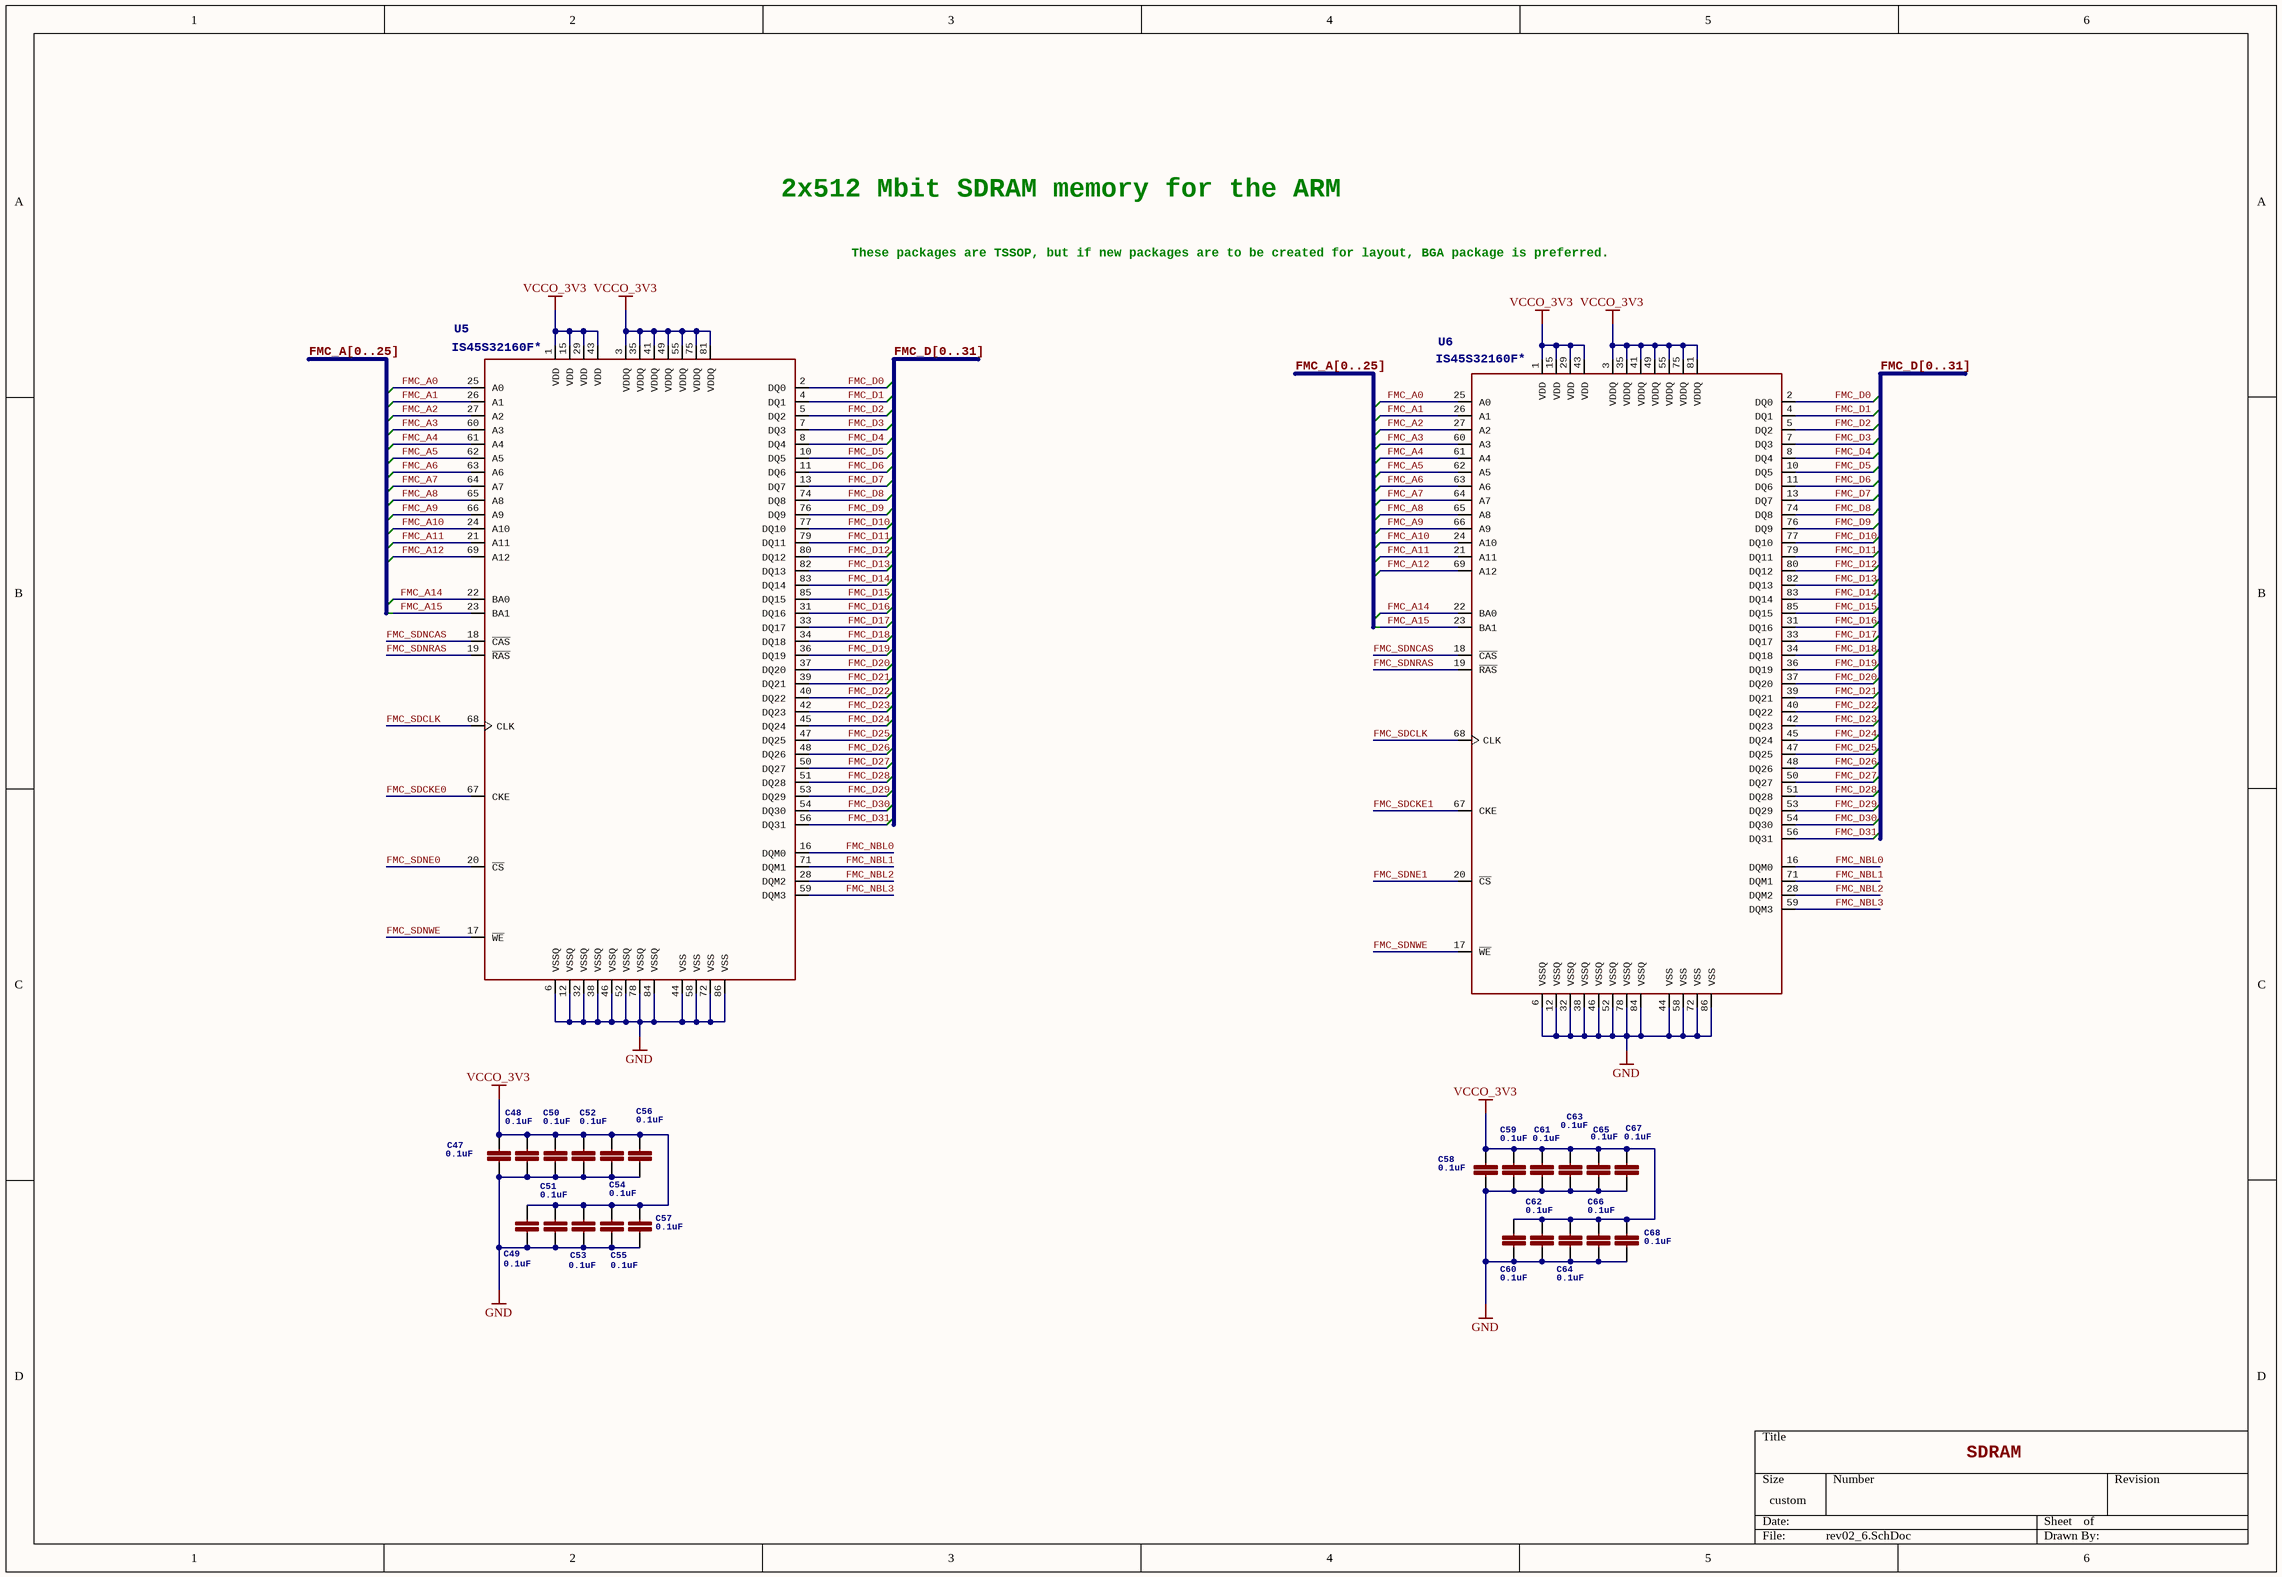
[diagram p6: rev02_6.SchDoc]

### Parts
C47  value 0.1uF  [C_0402]
C48  value 0.1uF  [C_0402]
C49  value 0.1uF  [C_0402]
C50  value 0.1uF  [C_0402]
C51  value 0.1uF  [C_0402]
C52  value 0.1uF  [C_0402]
C53  value 0.1uF  [C_0402]
C54  value 0.1uF  [C_0402]
C55  value 0.1uF  [C_0402]
C56  value 0.1uF  [C_0402]
C57  value 0.1uF  [C_0402]
C58  value 0.1uF  [C_0402]
C59  value 0.1uF  [C_0402]
C60  value 0.1uF  [C_0402]
C61  value 0.1uF  [C_0402]
C62  value 0.1uF  [C_0402]
C63  value 0.1uF  [C_0402]
C64  value 0.1uF  [C_0402]
C65  value 0.1uF  [C_0402]
C66  value 0.1uF  [C_0402]
C67  value 0.1uF  [C_0402]
C68  value 0.1uF  [C_0402]
U5  IS45S32160F*  >NAME: U5  [TSSOP50P1180X120-86N]
U6  IS45S32160F*  >NAME: U6  [TSSOP50P1180X120-86N]

### Nets
GND: C47.2 C48.2 C49.2 C50.2 C51.2 C52.2 C53.2 C54.2 C55.2 C56.2 C57.2 C58.2 C59.2 C60.2 C61.2 C62.2 C63.2 C64.2 C65.2 C66.2 C67.2 C68.2 U5.6(VSSQ) U5.12(VSSQ) U5.32(VSSQ) U5.38(VSSQ) U5.44(VSS) U5.46(VSSQ) U5.52(VSSQ) U5.58(VSS) U5.72(VSS) U5.78(VSSQ) U5.84(VSSQ) U5.86(VSS) U6.6(VSSQ) U6.12(VSSQ) U6.32(VSSQ) U6.38(VSSQ) U6.44(VSS) U6.46(VSSQ) U6.52(VSSQ) U6.58(VSS) U6.72(VSS) U6.78(VSSQ) U6.84(VSSQ) U6.86(VSS)
VCCO_3V3: C47.1 C48.1 C49.1 C50.1 C51.1 C52.1 C53.1 C54.1 C55.1 C56.1 C57.1 C58.1 C59.1 C60.1 C61.1 C62.1 C63.1 C64.1 C65.1 C66.1 C67.1 C68.1 U5.1(VDD) U5.3(VDDQ) U5.15(VDD) U5.29(VDD) U5.35(VDDQ) U5.41(VDDQ) U5.43(VDD) U5.49(VDDQ) U5.55(VDDQ) U5.75(VDDQ) U5.81(VDDQ) U6.1(VDD) U6.3(VDDQ) U6.15(VDD) U6.29(VDD) U6.35(VDDQ) U6.41(VDDQ) U6.43(VDD) U6.49(VDDQ) U6.55(VDDQ) U6.75(VDDQ) U6.81(VDDQ)
FMC_A0: U5.25(A0) U6.25(A0)
FMC_A1: U5.26(A1) U6.26(A1)
FMC_A2: U5.27(A2) U6.27(A2)
FMC_A3: U5.60(A3) U6.60(A3)
FMC_A4: U5.61(A4) U6.61(A4)
FMC_A5: U5.62(A5) U6.62(A5)
FMC_A6: U5.63(A6) U6.63(A6)
FMC_A7: U5.64(A7) U6.64(A7)
FMC_A8: U5.65(A8) U6.65(A8)
FMC_A9: U5.66(A9) U6.66(A9)
FMC_A10: U5.24(A10) U6.24(A10)
FMC_A11: U5.21(A11) U6.21(A11)
FMC_A12: U5.69(A12) U6.69(A12)
FMC_A14: U5.22(BA0) U6.22(BA0)
FMC_A15: U5.23(BA1) U6.23(BA1)
FMC_D0: U5.2(DQ0) U6.2(DQ0)
FMC_D1: U5.4(DQ1) U6.4(DQ1)
FMC_D2: U5.5(DQ2) U6.5(DQ2)
FMC_D3: U5.7(DQ3) U6.7(DQ3)
FMC_D4: U5.8(DQ4) U6.8(DQ4)
FMC_D5: U5.10(DQ5) U6.10(DQ5)
FMC_D6: U5.11(DQ6) U6.11(DQ6)
FMC_D7: U5.13(DQ7) U6.13(DQ7)
FMC_D8: U5.74(DQ8) U6.74(DQ8)
FMC_D9: U5.76(DQ9) U6.76(DQ9)
FMC_D10: U5.77(DQ10) U6.77(DQ10)
FMC_D11: U5.79(DQ11) U6.79(DQ11)
FMC_D12: U5.80(DQ12) U6.80(DQ12)
FMC_D13: U5.82(DQ13) U6.82(DQ13)
FMC_D14: U5.83(DQ14) U6.83(DQ14)
FMC_D15: U5.85(DQ15) U6.85(DQ15)
FMC_D16: U5.31(DQ16) U6.31(DQ16)
FMC_D17: U5.33(DQ17) U6.33(DQ17)
FMC_D18: U5.34(DQ18) U6.34(DQ18)
FMC_D19: U5.36(DQ19) U6.36(DQ19)
FMC_D20: U5.37(DQ20) U6.37(DQ20)
FMC_D21: U5.39(DQ21) U6.39(DQ21)
FMC_D22: U5.40(DQ22) U6.40(DQ22)
FMC_D23: U5.42(DQ23) U6.42(DQ23)
FMC_D24: U5.45(DQ24) U6.45(DQ24)
FMC_D25: U5.47(DQ25) U6.47(DQ25)
FMC_D26: U5.48(DQ26) U6.48(DQ26)
FMC_D27: U5.50(DQ27) U6.50(DQ27)
FMC_D28: U5.51(DQ28) U6.51(DQ28)
FMC_D29: U5.53(DQ29) U6.53(DQ29)
FMC_D30: U5.54(DQ30) U6.54(DQ30)
FMC_D31: U5.56(DQ31) U6.56(DQ31)
FMC_NBL0: U5.16(DQM0) U6.16(DQM0)
FMC_NBL1: U5.71(DQM1) U6.71(DQM1)
FMC_NBL2: U5.28(DQM2) U6.28(DQM2)
FMC_NBL3: U5.59(DQM3) U6.59(DQM3)
FMC_SDCKE0: U5.67(CKE)
FMC_SDCKE1: U6.67(CKE)
FMC_SDCLK: U5.68(CLK) U6.68(CLK)
FMC_SDNCAS: U5.18(~{CAS}) U6.18(~{CAS})
FMC_SDNE0: U5.20(~{CS})
FMC_SDNE1: U6.20(~{CS})
FMC_SDNRAS: U5.19(~{RAS}) U6.19(~{RAS})
FMC_SDNWE: U5.17(~{WE}) U6.17(~{WE})

### Buses and harness runs
bus FMC_A[0..25]
bus FMC_D[0..31]

### Notes on the sheet
- 2x512 Mbit SDRAM memory for the ARM
- These packages are TSSOP, but if new packages are to be created
  for layout, BGA package is preferred.
- SDRAM

### Library data of the parts
C47-C68 = C-EUC0402: 0402 CAPACITOR
U5 U6 = IS45S32160F: 16Mx32, 512Mb SDRAM / Clock frequency: 166, 143 MHz; MPN: IS45S32160F; SUPPLIER: ISSI; >VALUE: IS45S32160F

## Sheet rev02_7.SchDoc
size 409 x 282 mm
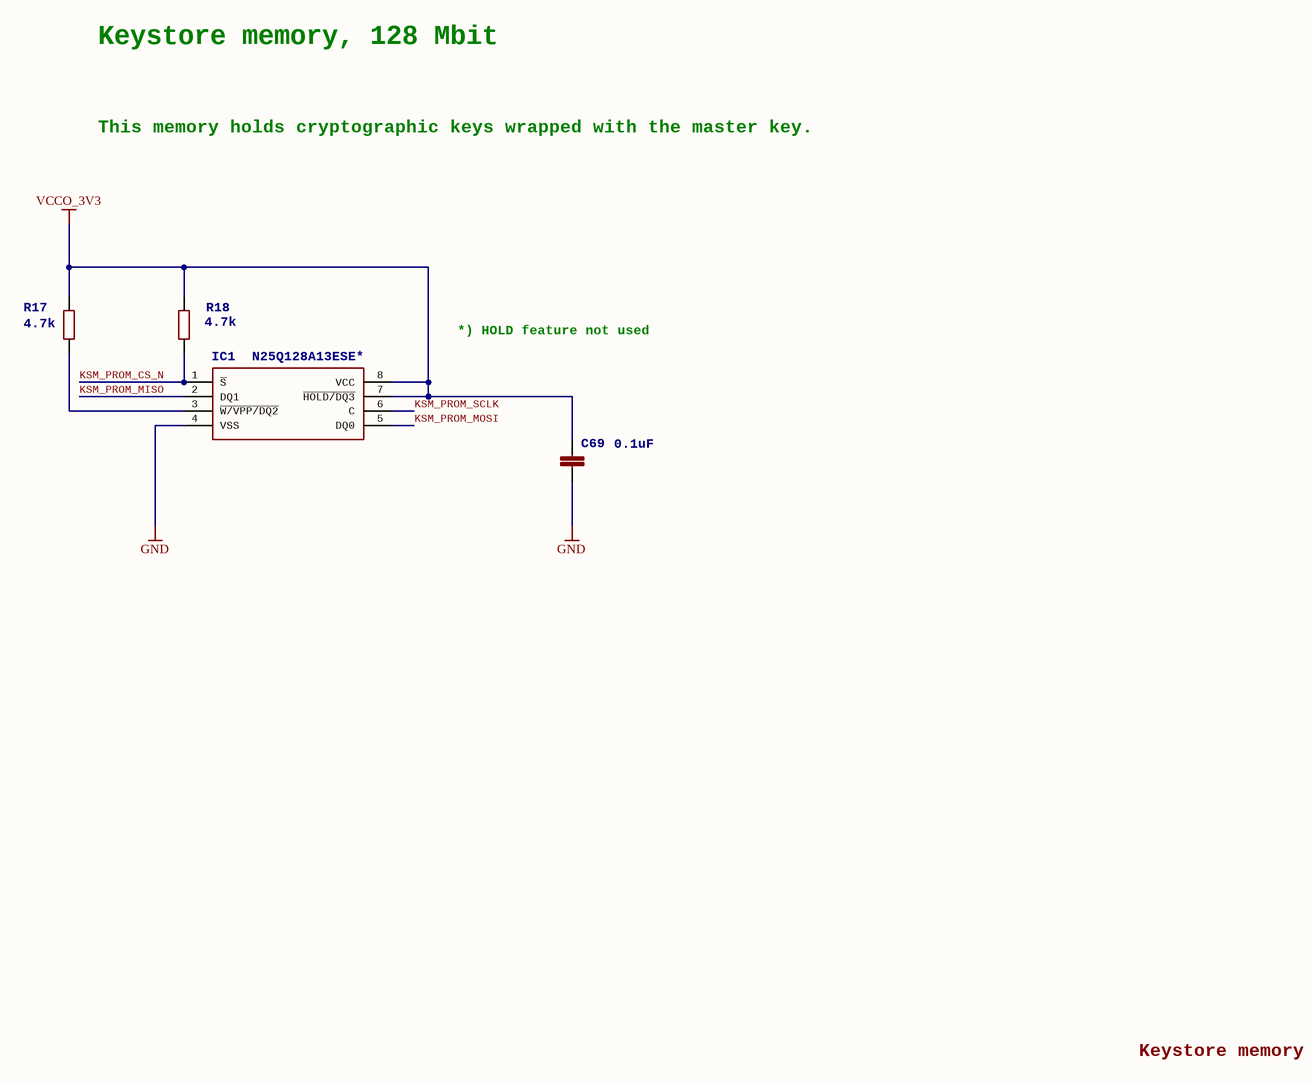
[diagram p7: rev02_7.SchDoc]

### Parts
C69  value 0.1uF  >NAME: C69  [C_0402]
IC1  N25Q128A13ESE*  >Name: IC1  [SO08]
R17  value 4.7k  [R_0402]
R18  value 4.7k  [R_0402]

### Nets
GND: C69.2 IC1.4(VSS)
VCCO_3V3: C69.1 IC1.7(~{HOLD/DQ3}) IC1.8(VCC) R17.1 R18.1
KSM_PROM_CS_N: IC1.1(~{S}) R18.2
KSM_PROM_MISO: IC1.2(DQ1)
KSM_PROM_MOSI: IC1.5(DQ0)
KSM_PROM_SCLK: IC1.6(C)
NetIC1_3: IC1.3(~{W/VPP/DQ2}) R17.2

### Notes on the sheet
- Keystore memory, 128 Mbit
- This memory holds cryptographic keys
  wrapped with the master key.
- *) HOLD feature not used
- Keystore memory

### Library data of the parts
C69 = C-EUC0402: 0402 CAPACITOR; DIELECTRIC: X7R; RATED_VOLTAGE: 50V; TOLERANCE: 10%; >VALUE: 0.1 uF
IC1 = N25Q128A13ES: NOR Flash; OC_DIGIKEY: 557-1562-ND; OC_FARNELL: 2253682; PRICE100_DIGIKEY: 1.30470; PRICE100_FARNELL: 5.10; >Value: N25Q128A13ES
R17 R18 = R-EU_R0402: 0402 Resistor 5%

## Sheet rev02_8.SchDoc
size 409 x 282 mm
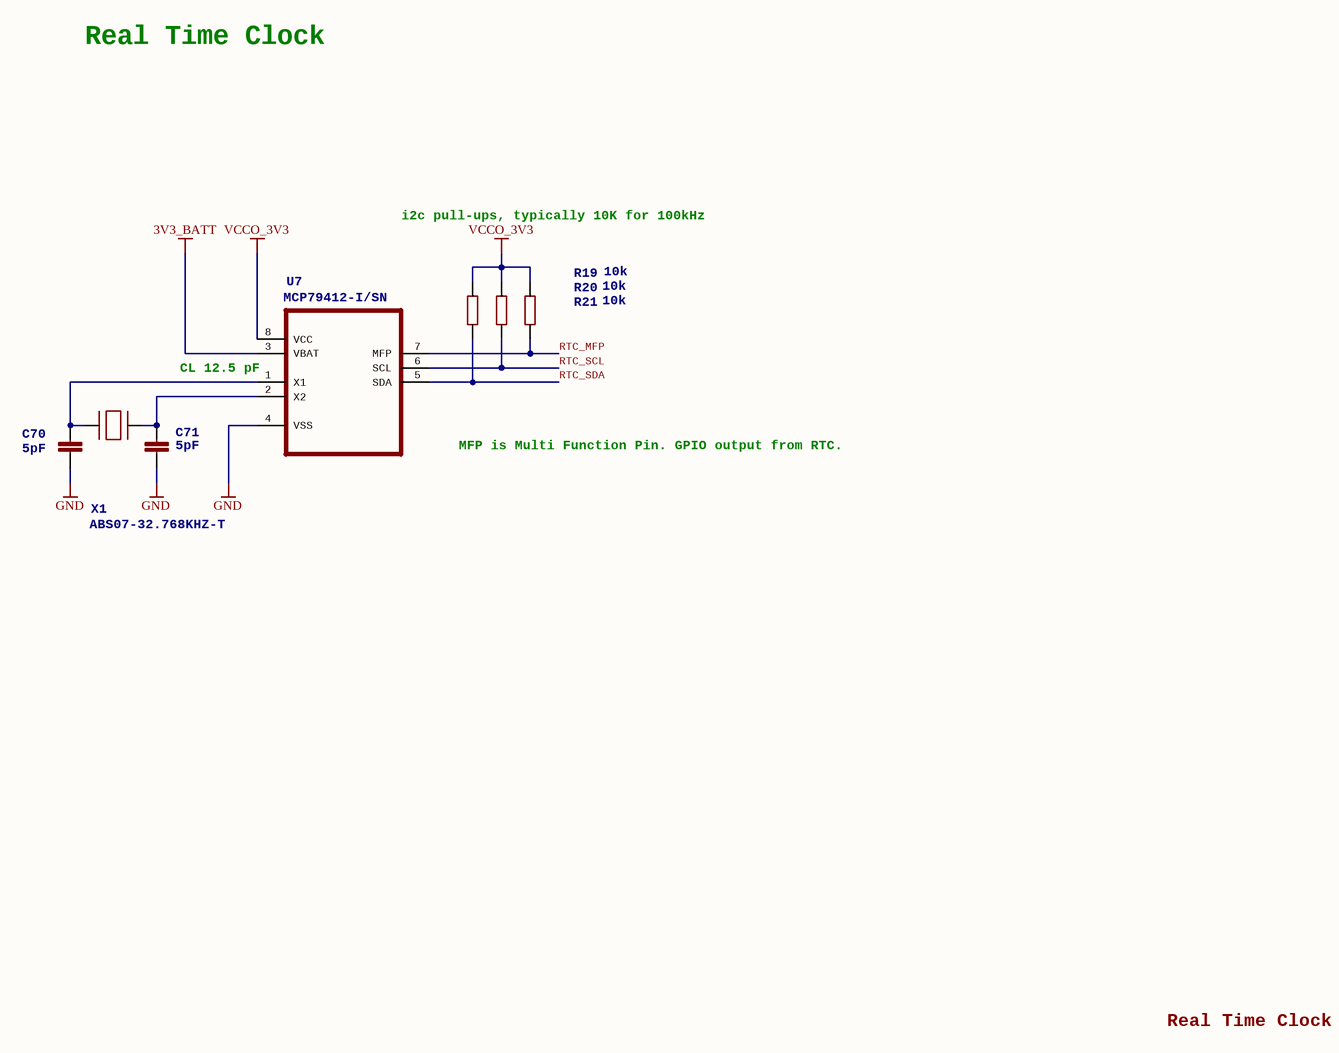
[diagram p8: rev02_8.SchDoc]

### Parts
C70  value 5pF  [C_0402]
C71  value 5pF  [C_0402]
R19  value 10k  [R_0402]
R20  value 10k  [R_0402]
R21  value 10k  [R_0402]
U7  MCP79412-I/SN  >NAME: U7  [SOIC127P600X175-8N]
X1  ABS07-32.768KHZ-T  >NAME: X1  [XTAL3215]

### Nets
3V3_BATT: U7.3(VBAT)
GND: C70.1 C71.1 U7.4(VSS)
VCCO_3V3: R19.1 R20.1 R21.1 U7.8(VCC)
RTC_MFP: R21.2 U7.7(MFP)
RTC_SCL: R20.2 U7.6(SCL)
RTC_SDA: R19.2 U7.5(SDA)
NetC70_2: C70.2 U7.1(X1) X1.P$1
NetC71_2: C71.2 U7.2(X2) X1.P$2

### Notes on the sheet
- Real Time Clock
- i2c pull-ups, typically 10K for 100kHz
- (near U7) CL 12.5 pF
- MFP is Multi Function Pin.
  GPIO output from RTC.

### Library data of the parts
C70 C71 = C-EUC0402: 0402 CAPACITOR
R19-R21 = R-EU_R0402: 0402 Resistor 5%
U7 = MCP79412-I/SN: RTCC, I2C, 1K EE, 64B SRAM, 8SOIC; MPN: MCP79412-I/SN; OC_FARNELL: 2103565; OC_NEWARK: 94T5863; PACKAGE: SOIC-8; SUPPLIER: Microchip; >VALUE: MCP79412-I/SN
X1 = XTAL-3.2X1.5: Crystal 32.768kHz; MPN: ABS07-32.768KHZ-T; OC_FARNELL: 2101347; >VALUE: XTAL-3.2X1.5

## Sheet rev02_9.SchDoc
size 409 x 282 mm
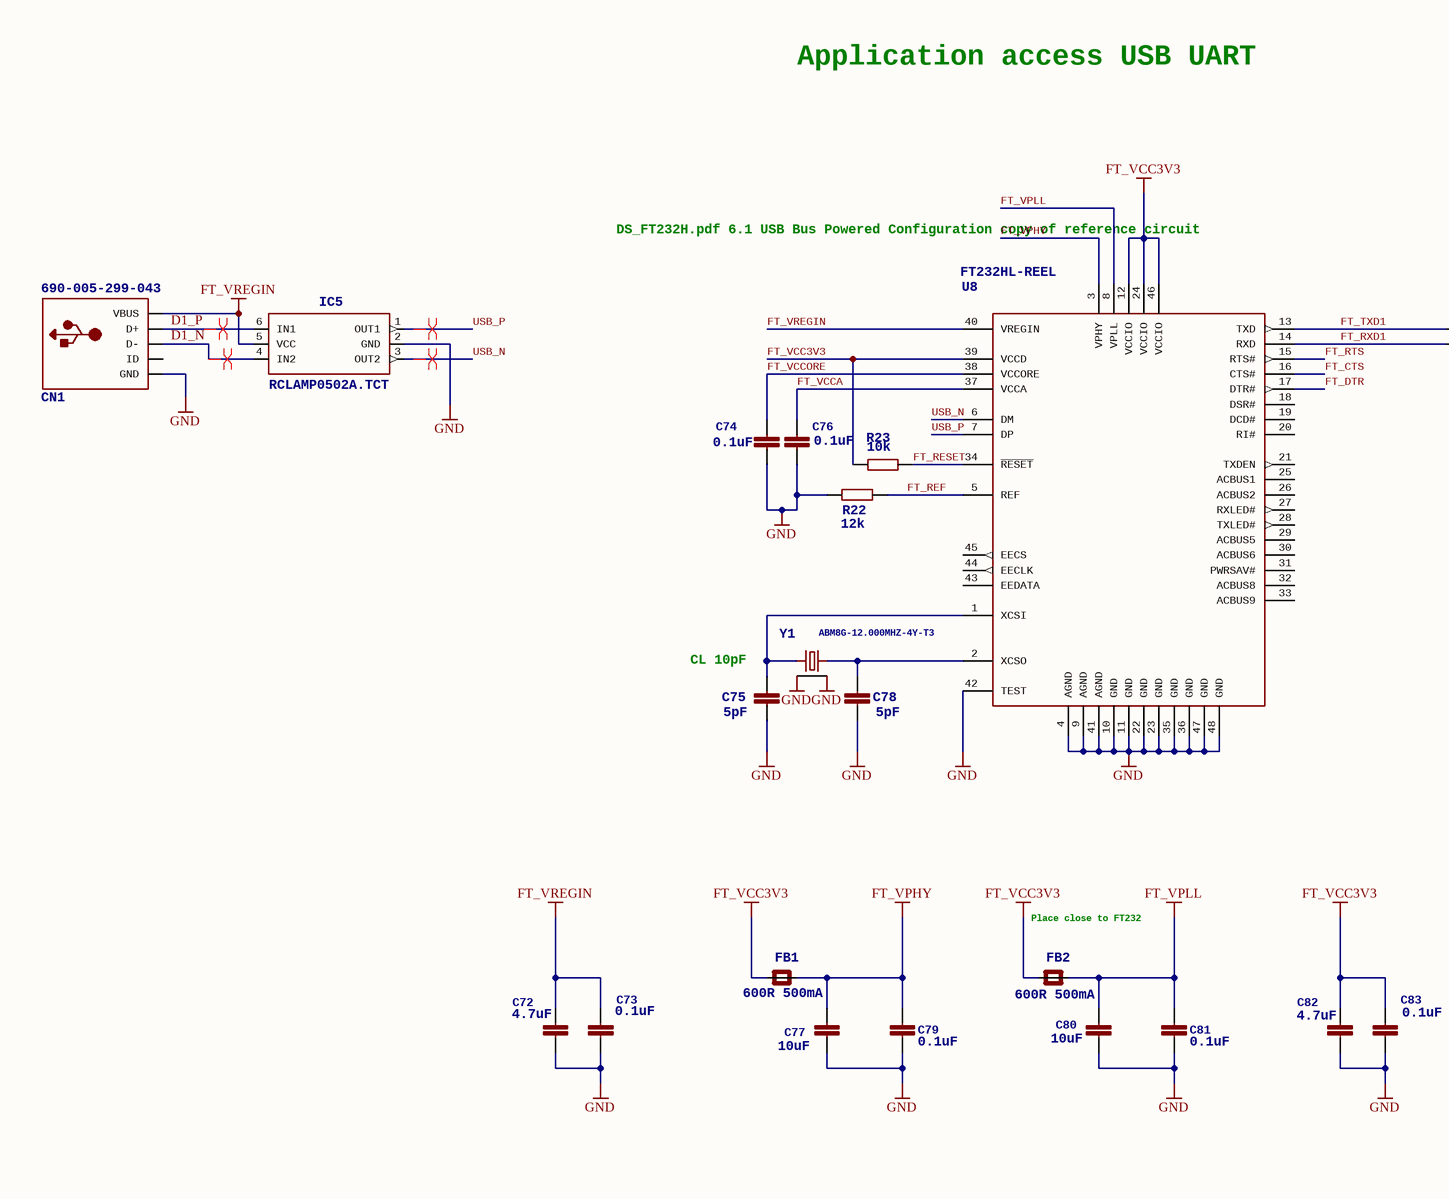
[diagram p9: rev02_9.SchDoc, left]
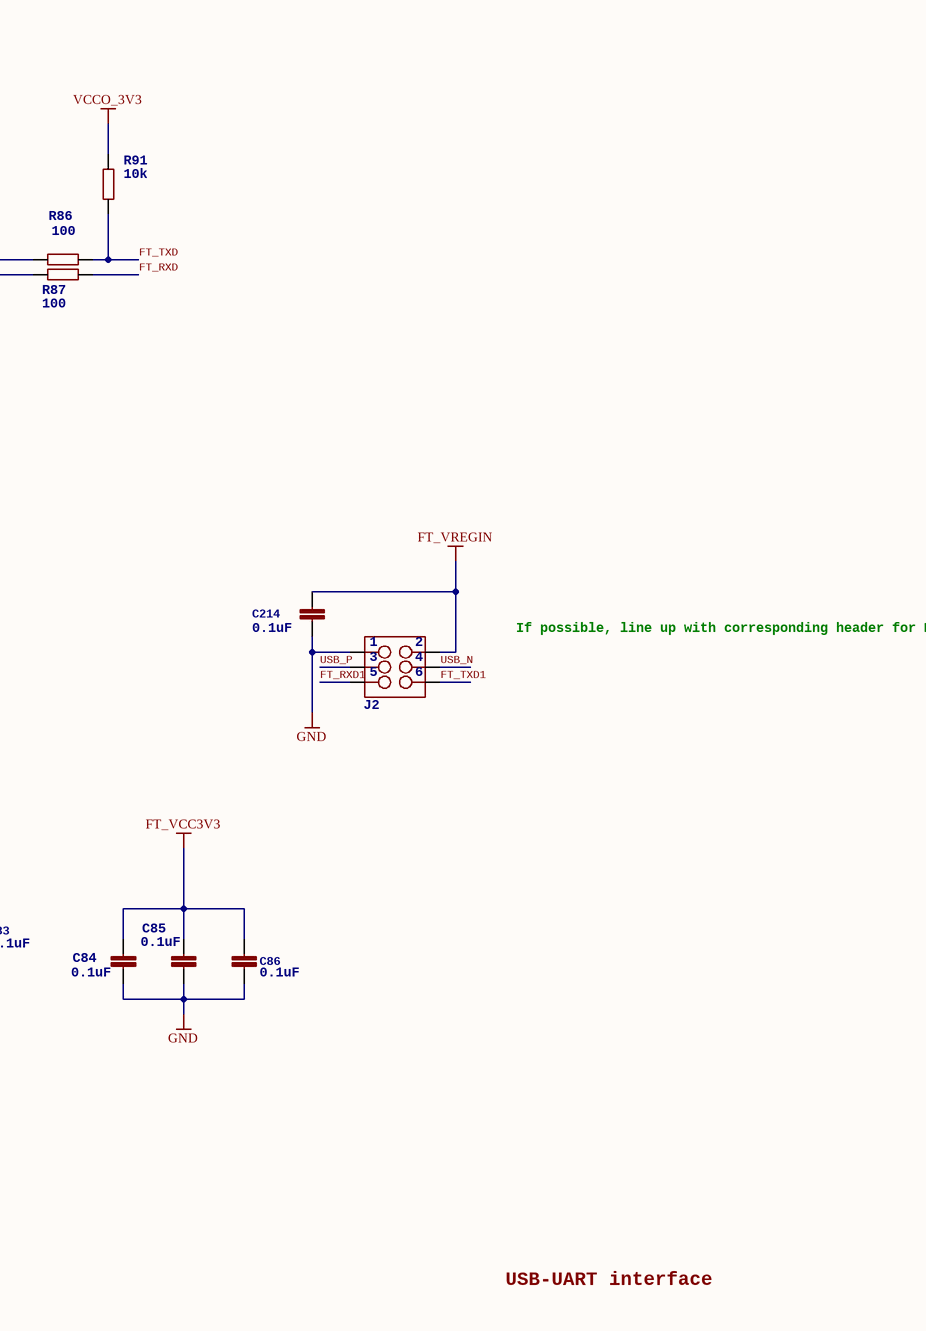
[diagram p10: rev02_9.SchDoc, right]

### Parts
C72  value 4.7uF  [C_0805]  (hidden comment: GRM21BR71A475KA73L)
C73  value 0.1uF  [C_0402]
C74  value 0.1uF  [C_0402]
C75  value 5pF  [C_0402]
C76  value 0.1uF  [C_0402]
C77  value 10uF  [C_0805]
C78  value 5pF  [C_0402]
C79  value 0.1uF  [C_0402]
C80  value 10uF  [C_0805]
C81  value 0.1uF  [C_0402]
C82  value 4.7uF  [C_0805]  (hidden comment: GRM21BR71A475KA73L)
C83  value 0.1uF  [C_0402]
C84  value 0.1uF  [C_0402]
C85  value 0.1uF  [C_0402]
C86  value 0.1uF  [C_0402]
C214  value 0.1uF  [C_0402]
CN1  690-005-299-043  [USB-MINIB]
FB1  >NAME: FB1  >VALUE: 600R 500mA  [L_0603]  (hidden comment: FBMH1608HL601-T)
FB2  >NAME: FB2  >VALUE: 600R 500mA  [L_0603]  (hidden comment: FBMH1608HL601-T)
IC5  RCLAMP0502A.TCT  >NAME: IC5  [RCLAMP0502A]
J2  M03X2NO_SILK  [PLD-6]  (value not drawn)
R22  value 12k  [R_0402]
R23  value 10k  >NAME: R23  [R_0402]
R86  value 100  [R_0402]
R87  value 100  [R_0402]
R91  value 10k  [R_0402]
U8  FT232HL-REEL  >NAME: U8  [LQFP-48]
Y1  ABM8G-12.000MHZ-4Y-T3  [CRYSTAL_3.2X2.5]

### Nets
FT_VCC3V3: C82.1 C83.1 C84.1 C85.1 C86.1 FB1.1(P$1) FB2.1(P$1) R23.2 U8.12(VCCIO) U8.24(VCCIO) U8.39(VCCD) U8.46(VCCIO)
FT_VPHY: C77.1 C79.1 FB1.2(P$2) U8.3(VPHY)
FT_VPLL: C80.1 C81.1 FB2.2(P$2) U8.8(VPLL)
FT_VREGIN: C72.1 C73.1 C214.1 CN1.VBUS IC5.5(VCC) J2.2 U8.40(VREGIN)
GND: C72.2 C73.2 C74.2 C75.1 C76.2 C77.2 C78.1 C79.2 C80.2 C81.2 C82.2 C83.2 C84.2 C85.2 C86.2 C214.2 CN1.GND IC5.2(GND) J2.1 R22.2 U8.4(AGND) U8.9(AGND) U8.10(GND) U8.11(GND) U8.22(GND) U8.23(GND) U8.35(GND) U8.36(GND) U8.41(AGND) U8.42(TEST) U8.47(GND) U8.48(GND) Y1.2 Y1.4
VCCO_3V3: R91.1
D1_N: CN1.D- IC5.4(IN2)
D1_P: CN1.D+ IC5.6(IN1)
FT_CTS: U8.16(CTS#)
FT_DTR: U8.17(DTR#)
FT_REF: R22.1 U8.5(REF)
FT_RESET: R23.1 U8.34(~{RESET})
FT_RTS: U8.15(RTS#)
FT_RXD: R87.1
FT_RXD1: J2.5 R87.2 U8.14(RXD)
FT_TXD: R86.1 R91.2
FT_TXD1: J2.6 R86.2 U8.13(TXD)
FT_VCCA: C76.1 U8.37(VCCA)
FT_VCCORE: C74.1 U8.38(VCCORE)
USB_N: IC5.3(OUT2) J2.4 U8.6(DM)
USB_P: IC5.1(OUT1) J2.3 U8.7(DP)
NetC75_2: C75.2 U8.1(XCSI) Y1.3
NetC78_2: C78.2 U8.2(XCSO) Y1.1

Not connected (* = marked no-connect by the designer): CN1 ID; U8 18(DSR#) 19(DCD#) 20(RI#) 21(TXDEN) 25(ACBUS1) 26(ACBUS2) 27(RXLED#) 28(TXLED#) 29(ACBUS5) 30(ACBUS6) 31(PWRSAV#) 32(ACBUS8) 33(ACBUS9) 43(EEDATA) 44(EECLK) 45(EECS)

### Layout directives
differential pair: D1_N, D1_P, USB_N, USB_P

### Notes on the sheet
- Application access USB UART
- DS_FT232H.pdf
  6.1 USB Bus Powered Configuration
  copy of reference circuit
- CL 10pF
- If possible, line up with
  corresponding header
  for MGMT USB-UART and
  label pins on silk screen
- (near FB2) Place close to FT232
- USB-UART interface

### Library data of the parts
C72 C82 = C-EUC0603: 0805 CAPACITOR
C73-C76 C78 C79 C81 C83-C86 C214 = C-EUC0402: 0402 CAPACITOR
C77 C80 = C-EUC0805: 0805 CAPACITOR
CN1 = USBMINIB: mini USB type B Connector
FB1 FB2 = FERRITE_0603MP: Ferrite Bead 600 Ohm 500mA
IC5 = RCLAMP0502ASC-89: USB protective diodes; MFR: SEMTECH; MPN: RCLAMP0502A; OC_FARNELL: 2058982; >VALUE: RCLAMP0502ASC-89
J2 = M03X2NO_SILK: 2x3 .1" header; 1: 1; 2: 2; 3: 3; 4: 4; 5: 5; 6: 6
R22 = R-EU_R0402: 0402 Resistor 1%
R23 R86 R87 R91 = R-EU_R0402: 0402 Resistor 5%
  R23: TOLERANCE: 5%
U8 = FT232H_SERIAL: INTERFACE, USB - UART/FIFO; OC_FARNELL: 1870924; >VALUE: FT232H_SERIAL
Y1 = CRYSTALTHIN: Crystal 12MHz

## Sheet rev02_10.SchDoc
size 409 x 282 mm
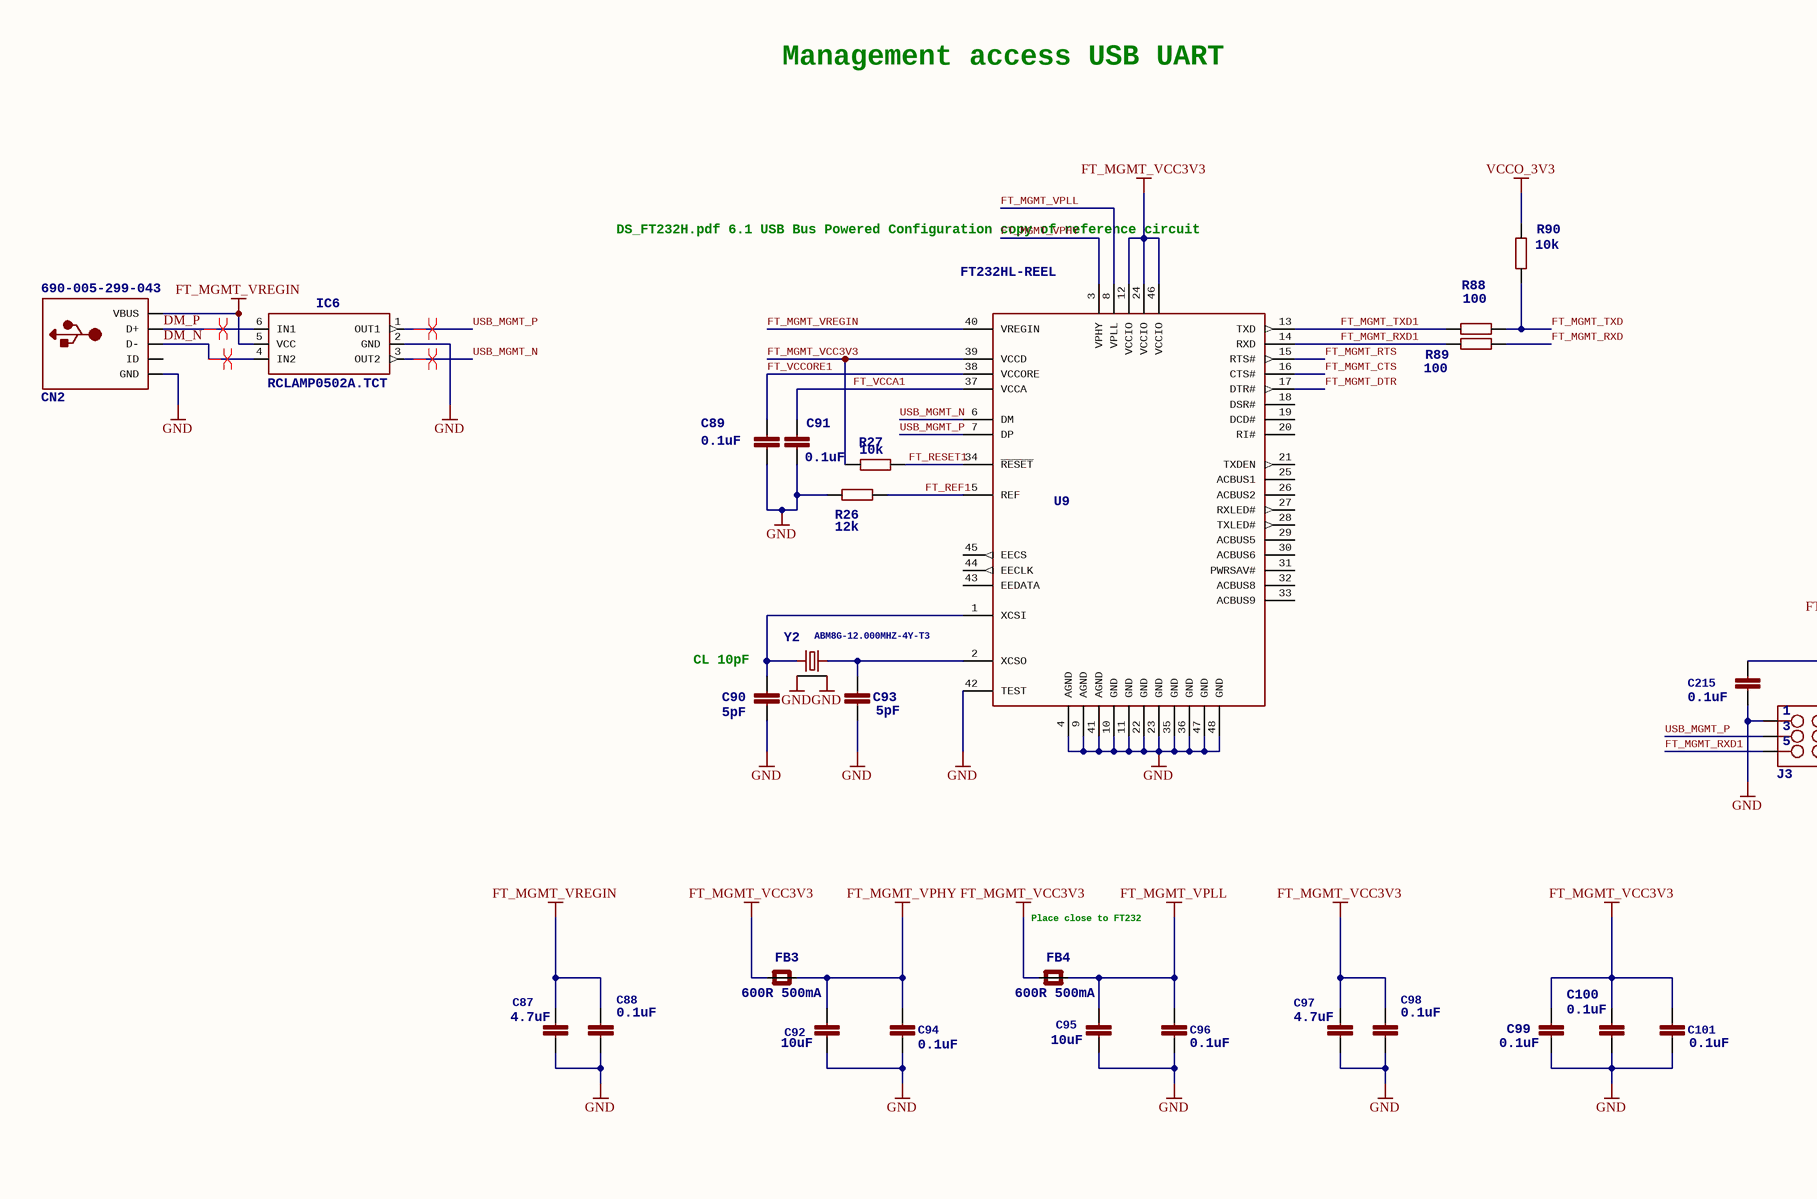
[diagram p11: rev02_10.SchDoc, left]
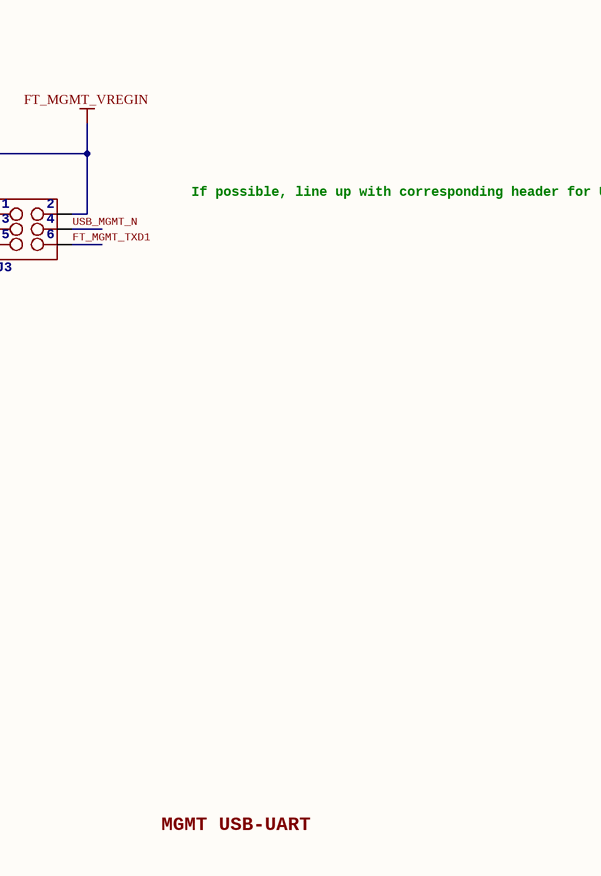
[diagram p12: rev02_10.SchDoc, right]

### Parts
C87  value 4.7uF  [C_0805]  (hidden comment: GRM21BR71A475KA73L)
C88  value 0.1uF  [C_0402]
C89  value 0.1uF  [C_0402]
C90  value 5pF  [C_0402]
C91  value 0.1uF  >NAME: C91  [C_0402]
C92  value 10uF  [C_0805]
C93  value 5pF  [C_0402]
C94  value 0.1uF  [C_0402]
C95  value 10uF  [C_0805]
C96  value 0.1uF  [C_0402]
C97  value 4.7uF  [C_0805]  (hidden comment: GRM21BR71A475KA73L)
C98  value 0.1uF  [C_0402]
C99  value 0.1uF  [C_0402]
C100  value 0.1uF  [C_0402]
C101  value 0.1uF  [C_0402]
C215  value 0.1uF  [C_0402]
CN2  690-005-299-043  [USB-MINIB]
FB3  >NAME: FB3  >VALUE: 600R 500mA  [L_0603]  (hidden comment: FBMH1608HL601-T)
FB4  >NAME: FB4  >VALUE: 600R 500mA  [L_0603]  (hidden comment: FBMH1608HL601-T)
IC6  RCLAMP0502A.TCT  >NAME: IC6  [RCLAMP0502A]
J3  M03X2NO_SILK  [PLD-6]  (value not drawn)
R26  value 12k  [R_0402]
R27  value 10k  >NAME: R27  [R_0402]
R88  value 100  [R_0402]
R89  value 100  [R_0402]
R90  value 10k  [R_0402]
U9  FT232HL-REEL  >NAME: U9  [LQFP-48]
Y2  ABM8G-12.000MHZ-4Y-T3  [CRYSTAL_3.2X2.5]

### Nets
FT_MGMT_VCC3V3: C97.1 C98.1 C99.1 C100.1 C101.1 FB3.1(P$1) FB4.1(P$1) R27.2 U9.12(VCCIO) U9.24(VCCIO) U9.39(VCCD) U9.46(VCCIO)
FT_MGMT_VPHY: C92.1 C94.1 FB3.2(P$2) U9.3(VPHY)
FT_MGMT_VPLL: C95.1 C96.1 FB4.2(P$2) U9.8(VPLL)
FT_MGMT_VREGIN: C87.1 C88.1 C215.1 CN2.VBUS IC6.5(VCC) J3.2 U9.40(VREGIN)
GND: C87.2 C88.2 C89.2 C90.1 C91.2 C92.2 C93.1 C94.2 C95.2 C96.2 C97.2 C98.2 C99.2 C100.2 C101.2 C215.2 CN2.GND IC6.2(GND) J3.1 R26.2 U9.4(AGND) U9.9(AGND) U9.10(GND) U9.11(GND) U9.22(GND) U9.23(GND) U9.35(GND) U9.36(GND) U9.41(AGND) U9.42(TEST) U9.47(GND) U9.48(GND) Y2.2 Y2.4
VCCO_3V3: R90.1
DM_N: CN2.D- IC6.4(IN2)
DM_P: CN2.D+ IC6.6(IN1)
FT_MGMT_CTS: U9.16(CTS#)
FT_MGMT_DTR: U9.17(DTR#)
FT_MGMT_RTS: U9.15(RTS#)
FT_MGMT_RXD: R89.1
FT_MGMT_RXD1: J3.5 R89.2 U9.14(RXD)
FT_MGMT_TXD: R88.1 R90.2
FT_MGMT_TXD1: J3.6 R88.2 U9.13(TXD)
FT_REF1: R26.1 U9.5(REF)
FT_RESET1: R27.1 U9.34(~{RESET})
FT_VCCA1: C91.1 U9.37(VCCA)
FT_VCCORE1: C89.1 U9.38(VCCORE)
USB_MGMT_N: IC6.3(OUT2) J3.4 U9.6(DM)
USB_MGMT_P: IC6.1(OUT1) J3.3 U9.7(DP)
NetC90_2: C90.2 U9.1(XCSI) Y2.3
NetC93_2: C93.2 U9.2(XCSO) Y2.1

Not connected (* = marked no-connect by the designer): CN2 ID; U9 18(DSR#) 19(DCD#) 20(RI#) 21(TXDEN) 25(ACBUS1) 26(ACBUS2) 27(RXLED#) 28(TXLED#) 29(ACBUS5) 30(ACBUS6) 31(PWRSAV#) 32(ACBUS8) 33(ACBUS9) 43(EEDATA) 44(EECLK) 45(EECS)

### Layout directives
differential pair: DM_N, DM_P, USB_MGMT_N, USB_MGMT_P

### Notes on the sheet
- Management access USB UART
- DS_FT232H.pdf
  6.1 USB Bus Powered Configuration
  copy of reference circuit
- CL 10pF
- If possible, line up with
  corresponding header
  for USB-UART and label
  pins on silk screen
- (near FB4) Place close to FT232
- MGMT USB-UART

### Library data of the parts
C87 C97 = C-EUC0603: 0805 CAPACITOR
C88-C90 C93 C94 C96 C98-C101 C215 = C-EUC0402: 0402 CAPACITOR
C91 = C-EUC0402: 0402 CAPACITOR; DIELECTRIC: X7R; RATED_VOLTAGE: 10V; >VALUE: 0.1 uF
C92 C95 = C-EUC0805: 0805 CAPACITOR
CN2 = USBMINIB: mini USB type B Connector
FB3 FB4 = FERRITE_0603MP: Ferrite Bead 600 Ohm 500mA
IC6 = RCLAMP0502ASC-89: USB protective diodes; MFR: SEMTECH; MPN: RCLAMP0502A; OC_FARNELL: 2058982; >VALUE: RCLAMP0502ASC-89
J3 = M03X2NO_SILK: 2x3 .1" header; 1: 1; 2: 2; 3: 3; 4: 4; 5: 5; 6: 6
R26 = R-EU_R0402: 0402 Resistor 1%
R27 R88-R90 = R-EU_R0402: 0402 Resistor 5%
  R27: TOLERANCE: 5%
U9 = FT232H_SERIAL: INTERFACE, USB - UART/FIFO; OC_FARNELL: 1870924; >VALUE: FT232H_SERIAL
Y2 = CRYSTALTHIN: Crystal 12MHz

## Sheet rev02_11.SchDoc
size 409 x 282 mm
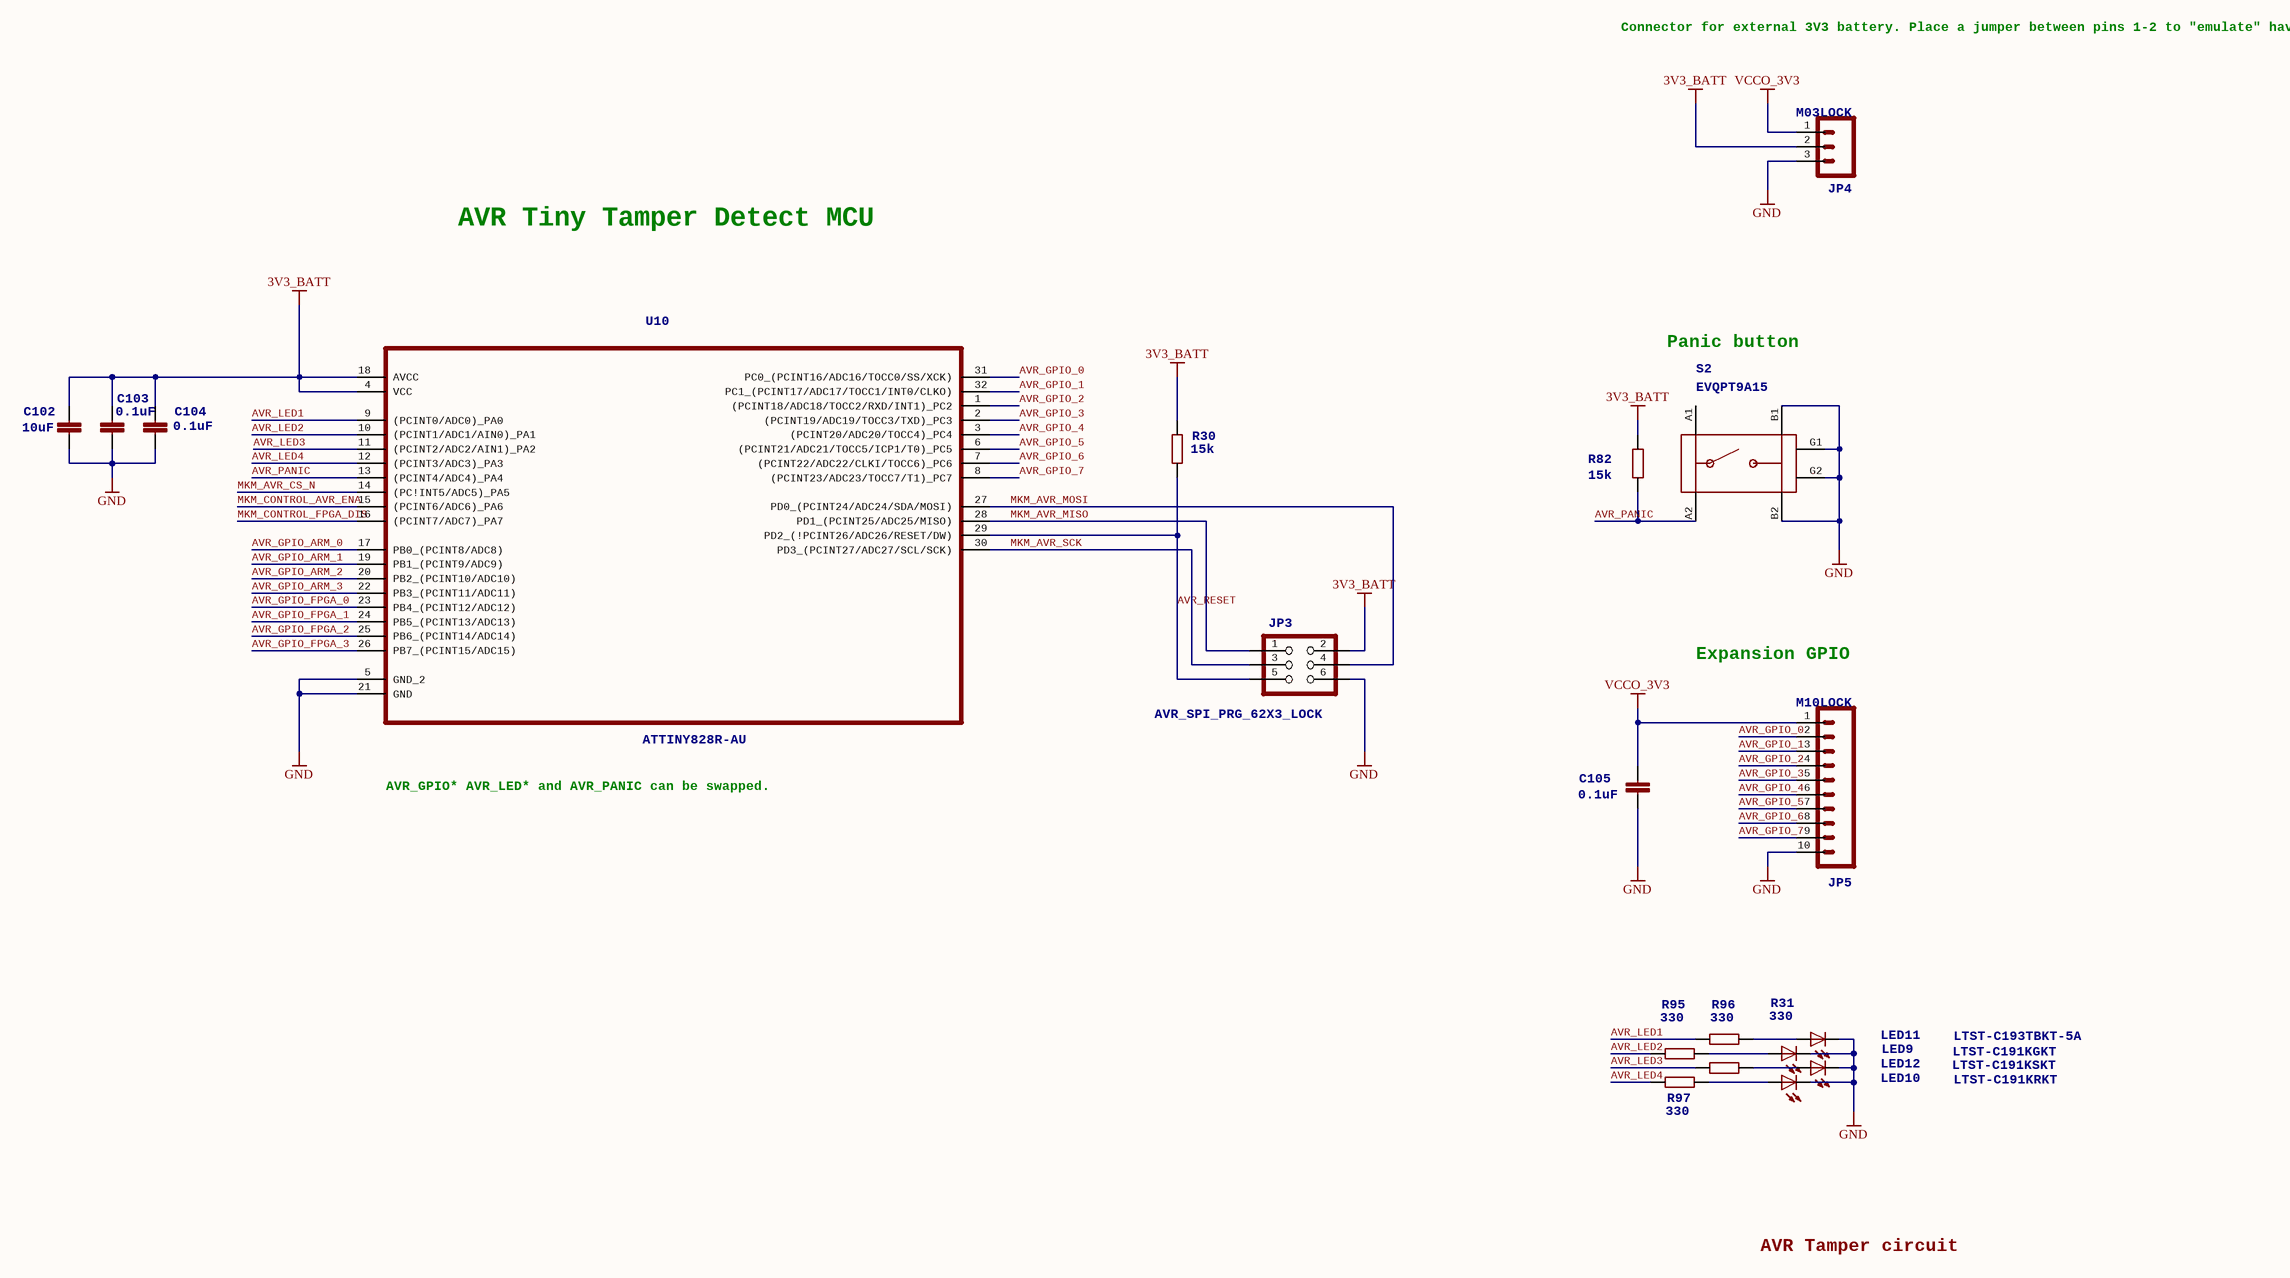
[diagram p13: rev02_11.SchDoc]

### Parts
C102  value 10uF  [C_0805]
C103  value 0.1uF  [C_0402]
C104  value 0.1uF  [C_0402]
C105  value 0.1uF  [C_0402]
JP3  AVR_SPI_PRG_62X3_LOCK  [PLD-6]
JP4  >NAME: JP4  [PLS-3]  (hidden comment: M03LOCK)
JP5  >NAME: JP5  [HDR1X10]  (hidden comment: M10LOCK)
LED9  LTST-C191KGKT  [VD_0603]
LED10  LTST-C191KRKT  [VD_0603]
LED11  LTST-C193TBKT-5A  [VD_0603]
LED12  LTST-C191KSKT  [VD_0603]
R30  value 15k  >NAME: R30  [R_0402]
R31  value 330  [R_0402]
R82  value 15k  [R_0402]
R95  value 330  [R_0402]
R96  value 330  [R_0402]
R97  value 330  [R_0402]
S2  EVQPT9A15  >NAME: S2  [TACTILE_SWITCH]
U10  >NAME: U10  [LQFP-32]  (hidden comment: ATTINY828R-AU)

### Nets
3V3_BATT: C102.1 C103.1 C104.1 JP3.2 JP4.2 R30.2 R82.2 U10.4(VCC) U10.18(AVCC)
GND: C102.2 C103.2 C104.2 C105.2 JP3.6 JP4.3 JP5.10 LED9.2(C) LED10.2(C) LED11.2(C) LED12.2(C) S2.B1 S2.B2 S2.G1 S2.G2 U10.5(GND_2) U10.21(GND)
VCCO_3V3: C105.1 JP4.1 JP5.1
AVR_GPIO_0: JP5.2 U10.31(PC0_(PCINT16/ADC16/TOCC0/SS/XCK))
AVR_GPIO_1: JP5.3 U10.32(PC1_(PCINT17/ADC17/TOCC1/INT0/CLKO))
AVR_GPIO_2: JP5.4 U10.1((PCINT18/ADC18/TOCC2/RXD/INT1)_PC2)
AVR_GPIO_3: JP5.5 U10.2((PCINT19/ADC19/TOCC3/TXD)_PC3)
AVR_GPIO_4: JP5.6 U10.3((PCINT20/ADC20/TOCC4)_PC4)
AVR_GPIO_5: JP5.7 U10.6((PCINT21/ADC21/TOCC5/ICP1/T0)_PC5)
AVR_GPIO_6: JP5.8 U10.7((PCINT22/ADC22/CLKI/TOCC6)_PC6)
AVR_GPIO_7: JP5.9 U10.8((PCINT23/ADC23/TOCC7/T1)_PC7)
AVR_GPIO_ARM_0: U10.17(PB0_(PCINT8/ADC8))
AVR_GPIO_ARM_1: U10.19(PB1_(PCINT9/ADC9))
AVR_GPIO_ARM_2: U10.20(PB2_(PCINT10/ADC10))
AVR_GPIO_ARM_3: U10.22(PB3_(PCINT11/ADC11))
AVR_GPIO_FPGA_0: U10.23(PB4_(PCINT12/ADC12))
AVR_GPIO_FPGA_1: U10.24(PB5_(PCINT13/ADC13))
AVR_GPIO_FPGA_2: U10.25(PB6_(PCINT14/ADC14))
AVR_GPIO_FPGA_3: U10.26(PB7_(PCINT15/ADC15))
AVR_LED1: R96.2 U10.9((PCINT0/ADC0)_PA0)
AVR_LED2: R95.2 U10.10((PCINT1/ADC1/AIN0)_PA1)
AVR_LED3: R31.2 U10.11((PCINT2/ADC2/AIN1)_PA2)
AVR_LED4: R97.2 U10.12((PCINT3/ADC3)_PA3)
AVR_PANIC: R82.1 S2.A2 U10.13((PCINT4/ADC4)_PA4)
AVR_RESET: JP3.5 R30.1 U10.29(PD2_(!PCINT26/ADC26/RESET/DW))
MKM_AVR_CS_N: U10.14((PC!INT5/ADC5)_PA5)
MKM_AVR_MISO: JP3.1 U10.28(PD1_(PCINT25/ADC25/MISO))
MKM_AVR_MOSI: JP3.4 U10.27(PD0_(PCINT24/ADC24/SDA/MOSI))
MKM_AVR_SCK: JP3.3 U10.30(PD3_(PCINT27/ADC27/SCL/SCK))
MKM_CONTROL_AVR_ENA: U10.15((PCINT6/ADC6)_PA6)
MKM_CONTROL_FPGA_DIS: U10.16((PCINT7/ADC7)_PA7)
NetLED9_1: LED9.1(A) R95.1
NetLED10_1: LED10.1(A) R97.1
NetLED11_1: LED11.1(A) R96.1
NetLED12_1: LED12.1(A) R31.1

Not connected (* = marked no-connect by the designer): S2 A1

### Notes on the sheet
- Connector for external 3V3 battery.
  Place a jumper between pins 1-2
  to "emulate" having a battery present.
- AVR Tiny Tamper Detect MCU
- Panic button
- Expansion GPIO
- AVR_GPIO* AVR_LED* and AVR_PANIC can be swapped.
- AVR Tamper circuit

### Library data of the parts
C102 = C-EUC0805: 0805 CAPACITOR
C103-C105 = C-EUC0402: 0402 CAPACITOR
JP3 = AVR_SPI_PRG_62X3_LOCK: AVR ISP 6 Pin. / This is the reduced ISP connector for AVR programming. Common on Arduino. This footprint will take up less PCB space and can be used with a 10-pin to 6-pin adapter such as SKU: BOB-08508. *Special note about "TEST_POINT" package. The stop mask is on the top side, so if you want your programming test points to be on the bottom of your board, make sure to place this package on the bottom side of the board. This also ensure that the orientation to program from the bottom side will be correct.
JP4 = M03LOCK: Standard 3-pin 0.1" header. Use with straight break away headers (SKU : PRT-00116), right angle break away headers (PRT-00553), swiss pins (PRT-00743), machine pins (PRT-00117), and female headers (PRT-00115). Molex polarized connector foot print use with SKU : PRT-08232 with associated crimp pins and housings.; >VALUE: M03LOCK
JP5 = M10LOCK: Standard 10-pin 0.1" header. Use with straight break away headers (SKU : PRT-00116), right angle break away headers (PRT-00553), swiss pins (PRT-00743), machine pins (PRT-00117), and female headers (PRT-00115).; >VALUE: M10LOCK
LED9 = LEDCHIP-LED0603: GREEN LED
LED10 = LEDCHIP-LED0603: RED LED
LED11 = LEDCHIP-LED0603: BLUE LED
LED12 = LEDCHIP-LED0603: YELLOW LED
R30 R31 R82 R95-R97 = R-EU_R0402: 0402 Resistor 5%
S2 = TACTILE_SWITCH: Tacktile switch; OC_FARNELL: 2425618
U10 = ATTINY828R-AU: IC, MCU, 8KB, FLASH, 20MHZ, TQFP-32; MPN: ATTINY828R-AU; OC_FARNELL: 2249850; OC_NEWARK: Unknown; PACKAGE: TQFP-32; SUPPLIER: ATMEL; >VALUE: ATTINY828R-AU

## Sheet rev02_12.SchDoc
size 409 x 282 mm
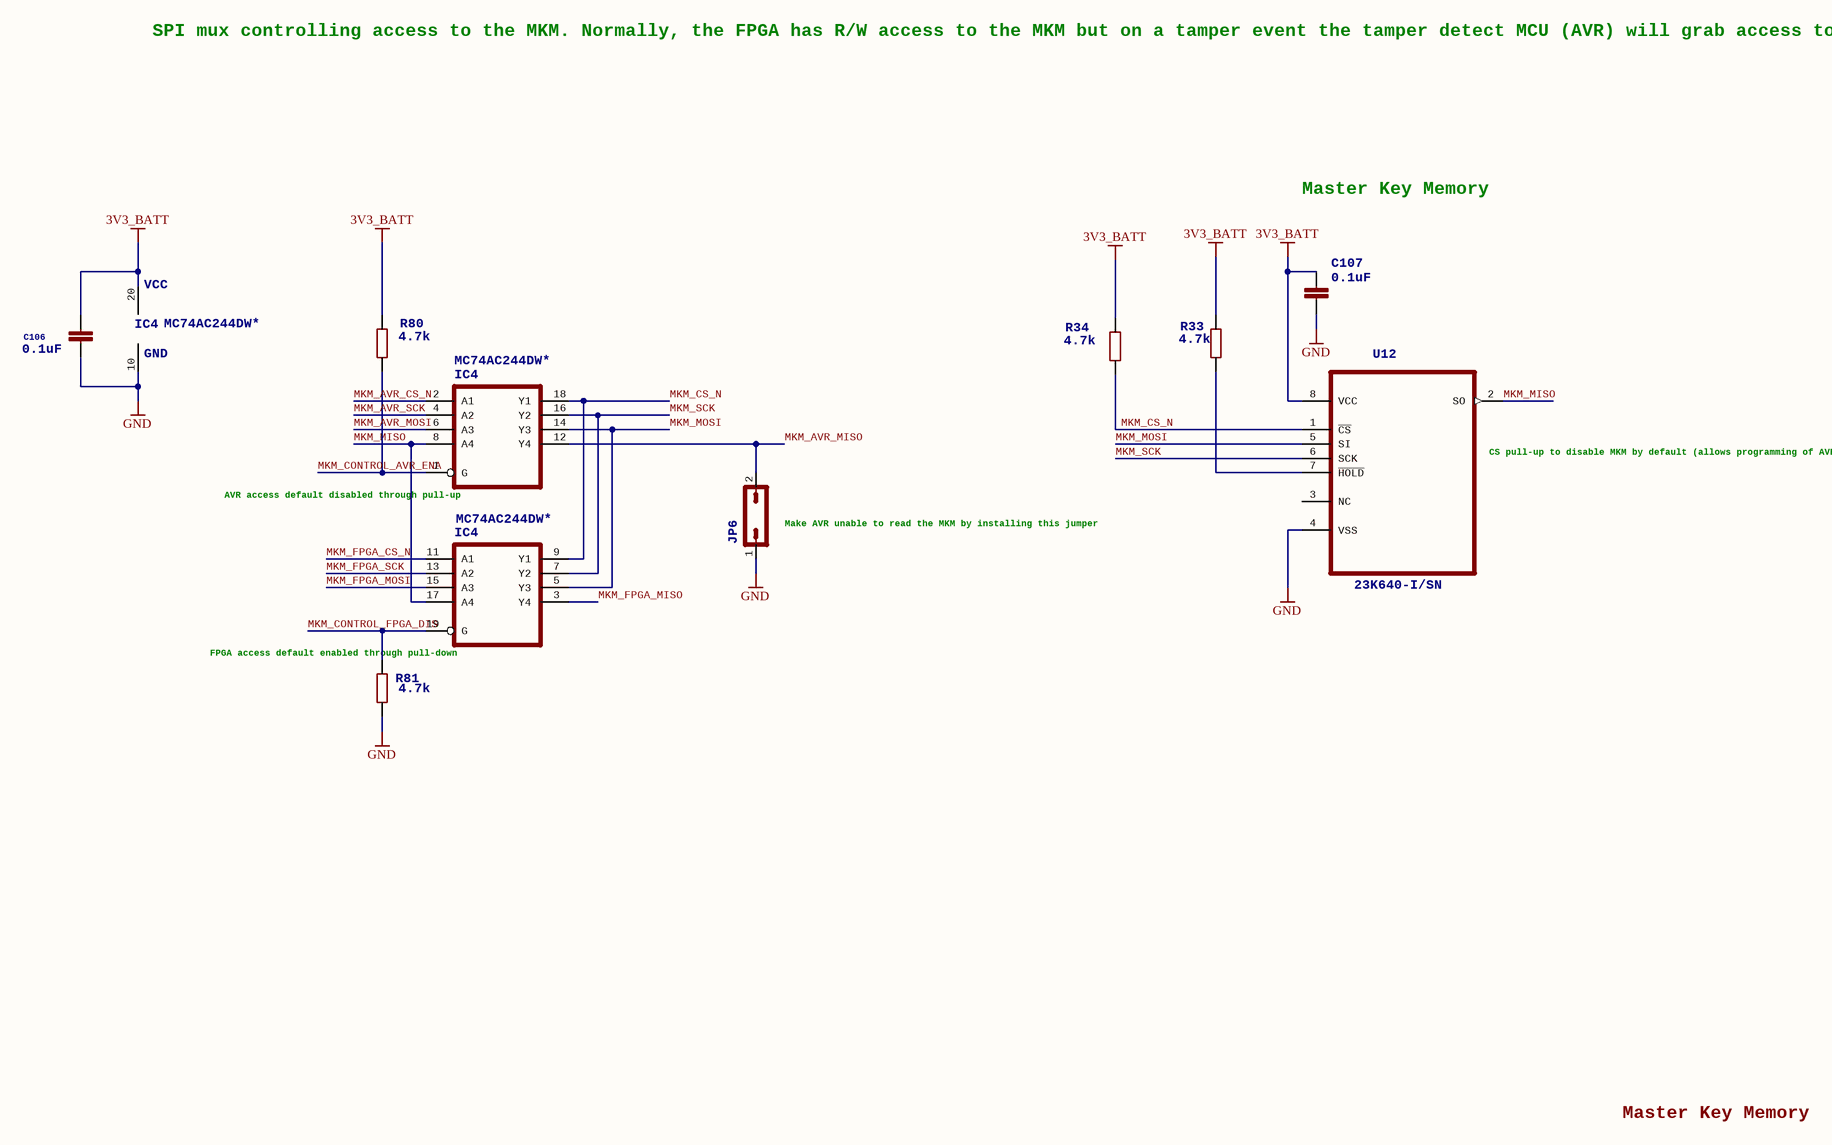
[diagram p14: rev02_12.SchDoc]

### Parts
C106  value 0.1uF  [C_0402]
C107  value 0.1uF  [C_0402]
IC4  MC74AC244DW*  >NAME: IC4  [SO20W]  (parts A,B,C of 3)
JP6  >NAME: JP6  [PLS-2]  (hidden comment: 61300211121)
R33  value 4.7k  [R_0402]
R34  value 4.7k  [R_0402]
R80  value 4.7k  >NAME: R80  [R_0402]
R81  value 4.7k  >NAME: R81  [R_0402]
U12  >NAME: U12  [SOIC127P600X175-8N]  (hidden comment: 23K640-I/SN)

### Nets
3V3_BATT: C106.1 C107.1 IC4.20(VCC) R33.1 R34.2 R80.2 U12.8(VCC)
GND: C106.2 C107.2 IC4.10(GND) JP6.1 R81.2 U12.4(VSS)
MKM_AVR_CS_N: IC4.2(A1)
MKM_AVR_MISO: IC4.12(Y4) JP6.2
MKM_AVR_MOSI: IC4.6(A3)
MKM_AVR_SCK: IC4.4(A2)
MKM_CONTROL_AVR_ENA: IC4.1(G) R80.1
MKM_CONTROL_FPGA_DIS: IC4.19(G) R81.1
MKM_CS_N: IC4.9(Y1) IC4.18(Y1) R34.1 U12.1(~{CS})
MKM_FPGA_CS_N: IC4.11(A1)
MKM_FPGA_MISO: IC4.3(Y4)
MKM_FPGA_MOSI: IC4.15(A3)
MKM_FPGA_SCK: IC4.13(A2)
MKM_MISO: IC4.8(A4) IC4.17(A4) U12.2(SO)
MKM_MOSI: IC4.5(Y3) IC4.14(Y3) U12.5(SI)
MKM_SCK: IC4.7(Y2) IC4.16(Y2) U12.6(SCK)
NetR33_2: R33.2 U12.7(~{HOLD})

Not connected (* = marked no-connect by the designer): U12 3(NC)

### Notes on the sheet
- SPI mux controlling access to the MKM.
  Normally, the FPGA has R/W access to the MKM but on a
  tamper event the tamper detect MCU (AVR) will grab access
  to the MKM and erase the contents.
- Master Key Memory
- (near U12) CS pull-up to disable MKM by
  default (allows programming
  of AVR)
- (near IC4) AVR access default
  disabled through pull-up
- (near JP6) Make AVR unable to read the
  MKM by installing this jumper
- (near R81) FPGA access default
  enabled through pull-down

### Library data of the parts
C106 C107 = C-EUC0402: 0402 CAPACITOR
IC4 = 74*244DW: Octal BUFFER and LINE DRIVER, 3-state; >VALUE: 74*244DW
JP6 = JP1Q: Wurth 2pins connector (for jumper); >VALUE: JP1Q
R33 R34 R80 R81 = R-EU_R0402: 0402 Resistor 5%
  R80 R81: TOLERANCE: 5%
U12 = 23K640-I/SN: 64K SPI Bus Low-Power Serial SRAM,SOIC-8; MPN: 23K640-I/SN; OC_FARNELL: 1695549; OC_NEWARK: 71P4706; PACKAGE: SOIC-8; SUPPLIER: MICROCHIP; >VALUE: 23K640-I/SN

## Sheet rev02_13.SchDoc
size 282 x 200 mm
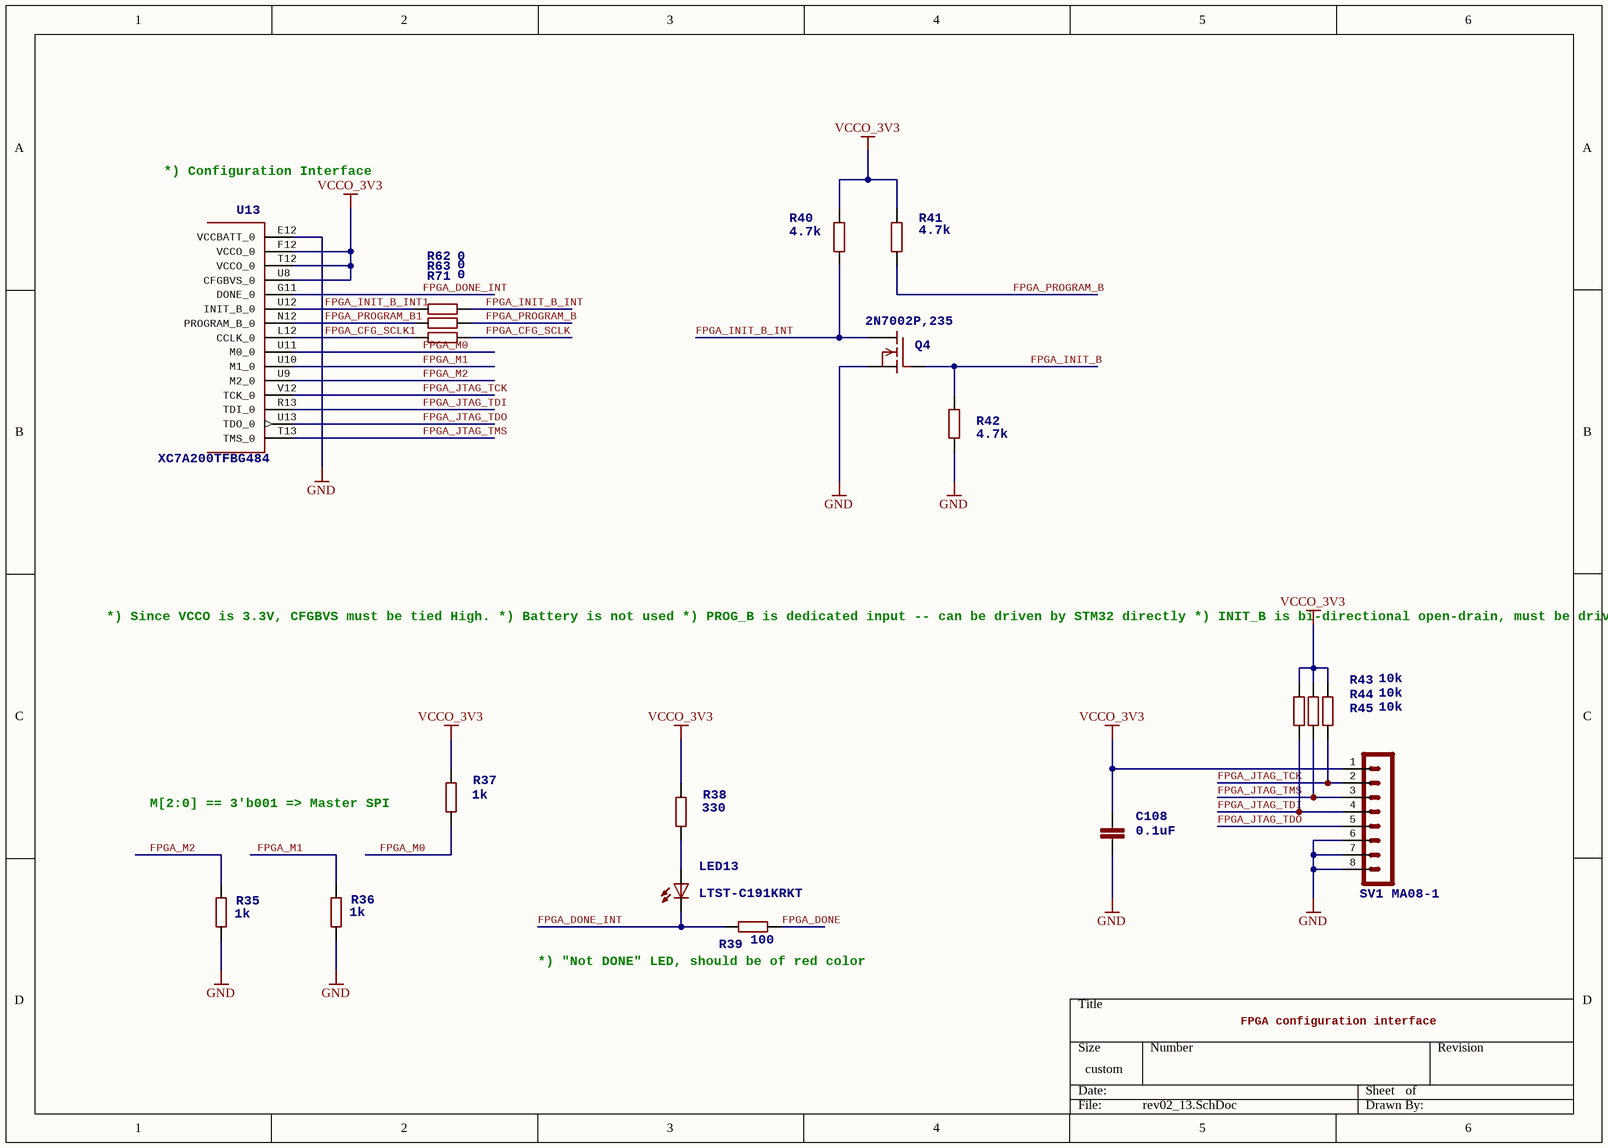
[diagram p15: rev02_13.SchDoc]

### Parts
C108  value 0.1uF  >NAME: C108  [C_0402]
LED13  LTST-C191KRKT  [VD_0603]
Q4  2N7002P,235  >NAME: Q4  [SOT-23]
R35  value 1k  >NAME: R35  [R_0402]
R36  value 1k  >NAME: R36  [R_0402]
R37  value 1k  [R_0402]
R38  value 330  [R_0402]
R39  value 100  >NAME: R39  [R_0402]
R40  value 4.7k  [R_0402]
R41  value 4.7k  [R_0402]
R42  value 4.7k  [R_0402]
R43  value 10k  [R_0402]
R44  value 10k  [R_0402]
R45  value 10k  [R_0402]
R62  value 0  [R_0402]
R63  value 0  [R_0402]
R71  value 0  [R_0402]
SV1  MA08-1  [PLS-8]
U13  >NAME: U13  [BGA484C100P22X22_2300X2300X254]  (hidden comment: XC7A200TFBG484)  (part A of 17)

### Nets
GND: C108.2 Q4.2(S) R35.1 R36.1 R42.1 SV1.6 SV1.7 SV1.8 U13.E12(VCCBATT_0)
VCCO_3V3: C108.1 R37.2 R38.2 R40.2 R41.2 R43.2 R44.2 R45.2 SV1.1 U13.F12(VCCO_0) U13.T12(VCCO_0) U13.U8(CFGBVS_0)
FPGA_CFG_SCLK: R71.1
FPGA_CFG_SCLK1: R71.2 U13.L12(CCLK_0)
FPGA_DONE: R39.1
FPGA_DONE_INT: LED13.2(C) R39.2 U13.G11(DONE_0)
FPGA_INIT_B: Q4.1(G) R42.2
FPGA_INIT_B_INT: Q4.3(D) R40.1 R62.1
FPGA_INIT_B_INT1: R62.2 U13.U12(INIT_B_0)
FPGA_JTAG_TCK: R45.1 SV1.2 U13.V12(TCK_0)
FPGA_JTAG_TDI: R43.1 SV1.4 U13.R13(TDI_0)
FPGA_JTAG_TDO: SV1.5 U13.U13(TDO_0)
FPGA_JTAG_TMS: R44.1 SV1.3 U13.T13(TMS_0)
FPGA_M0: R37.1 U13.U11(M0_0)
FPGA_M1: R36.2 U13.U10(M1_0)
FPGA_M2: R35.2 U13.U9(M2_0)
FPGA_PROGRAM_B: R41.1 R63.1
FPGA_PROGRAM_B1: R63.2 U13.N12(PROGRAM_B_0)
NetLED13_1: LED13.1(A) R38.1

### Notes on the sheet
- *) Configuration Interface
- *) Since VCCO is 3.3V, CFGBVS must be tied High.
  *) Battery is not used
  *) PROG_B is dedicated input -- can be driven by STM32 directly
  *) INIT_B is bi-directional open-drain, must be driven with MOSFET to ground
- M[2:0] == 3'b001 => Master SPI
- (near R39) *) "Not DONE" LED, should be of red color
- FPGA configuration interface

### Library data of the parts
C108 = C-EUC0402: as C69 on sheet rev02_7
LED13 = LEDCHIP-LED0603: RED LED
Q4 = 2N7002: OnSemi FET; >VALUE: 2N7002
R35-R45 = R-EU_R0402: 0402 Resistor 5%
  R35 R36 R39: TOLERANCE: 5%
R62 R63 R71 = R-EU_R0603: 0402 Resistor 5%
SV1 = MA08-1: PIN HEADER 0.1"; OC_FARNELL: unknown; OC_NEWARK: unknown
U13 = XC7A200TFBG484: Xilinx FPGA: XC7A200TFBG484; MPN: XC7A200T-1FBG484C; MFR: Xilinx; OC_DIGIKEY: 122-1871-ND; >VALUE: XC7A200TFBG484

## Sheet rev02_14.SchDoc
size 282 x 200 mm
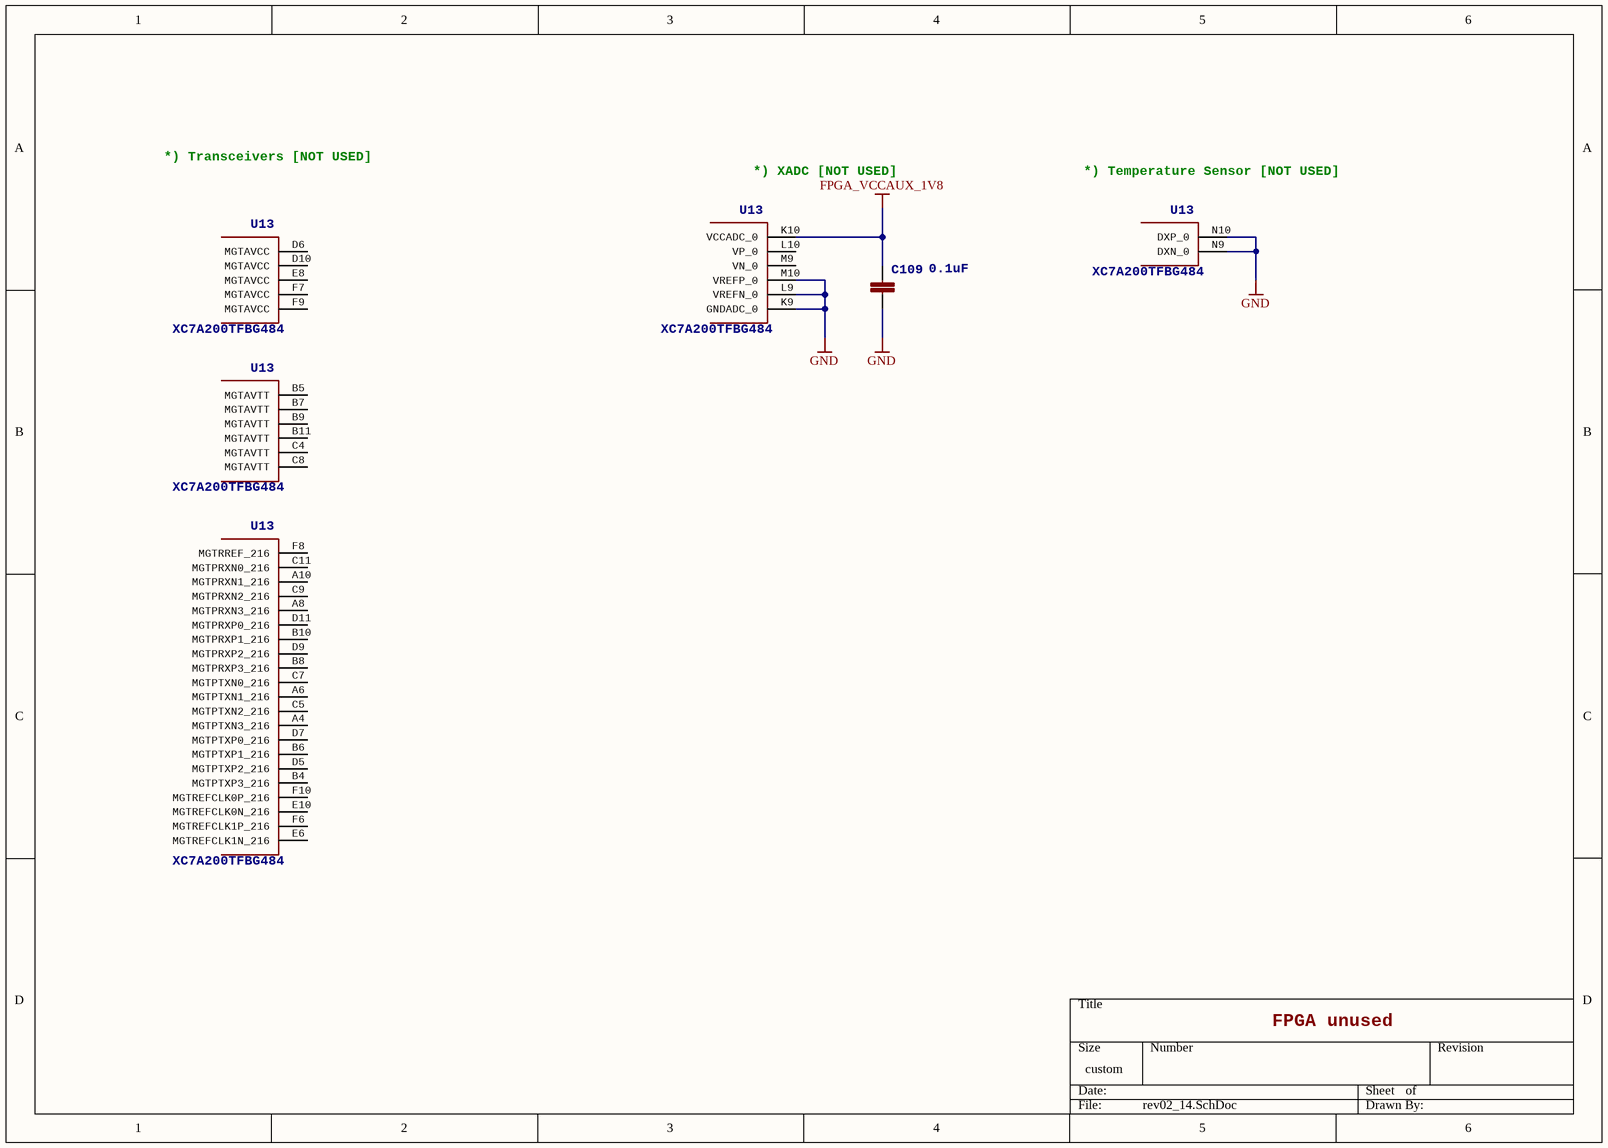
[diagram p16: rev02_14.SchDoc]

### Parts
C109  value 0.1uF  >NAME: C109  [C_0402]
U13  >NAME: U13  [BGA484C100P22X22_2300X2300X254]  (hidden comment: XC7A200TFBG484)  (parts H,K,L,M,Q of 17)

### Nets
FPGA_VCCAUX_1V8: C109.1 U13.K10(VCCADC_0)
GND: C109.2 U13.K9(GNDADC_0) U13.L9(VREFN_0) U13.M10(VREFP_0) U13.N9(DXN_0) U13.N10(DXP_0)

Not connected (* = marked no-connect by the designer): U13 A4(MGTPTXN3_216) A6(MGTPTXN1_216) A8(MGTPRXN3_216) A10(MGTPRXN1_216) B4(MGTPTXP3_216) B5(MGTAVTT) B6(MGTPTXP1_216) B7(MGTAVTT) B8(MGTPRXP3_216) B9(MGTAVTT) B10(MGTPRXP1_216) B11(MGTAVTT) C4(MGTAVTT) C5(MGTPTXN2_216) C7(MGTPTXN0_216) C8(MGTAVTT) C9(MGTPRXN2_216) C11(MGTPRXN0_216) D5(MGTPTXP2_216) D6(MGTAVCC) D7(MGTPTXP0_216) D9(MGTPRXP2_216) D10(MGTAVCC) D11(MGTPRXP0_216) E6(MGTREFCLK1N_216) E8(MGTAVCC) E10(MGTREFCLK0N_216) F6(MGTREFCLK1P_216) F7(MGTAVCC) F8(MGTRREF_216) F9(MGTAVCC) F10(MGTREFCLK0P_216) L10(VP_0) M9(VN_0)

### Notes on the sheet
- *) Transceivers [NOT USED]
- *) XADC [NOT USED]
- *) Temperature Sensor [NOT USED]
- FPGA unused

### Library data of the parts
C109 = C-EUC0402: as C69 on sheet rev02_7
U13 = XC7A200TFBG484: as U13 on sheet rev02_13; MFR: Xilinx; OC_DIGIKEY: 122-1871-ND; >VALUE: XC7A200TFBG484

## Sheet rev02_15.SchDoc
size 282 x 200 mm
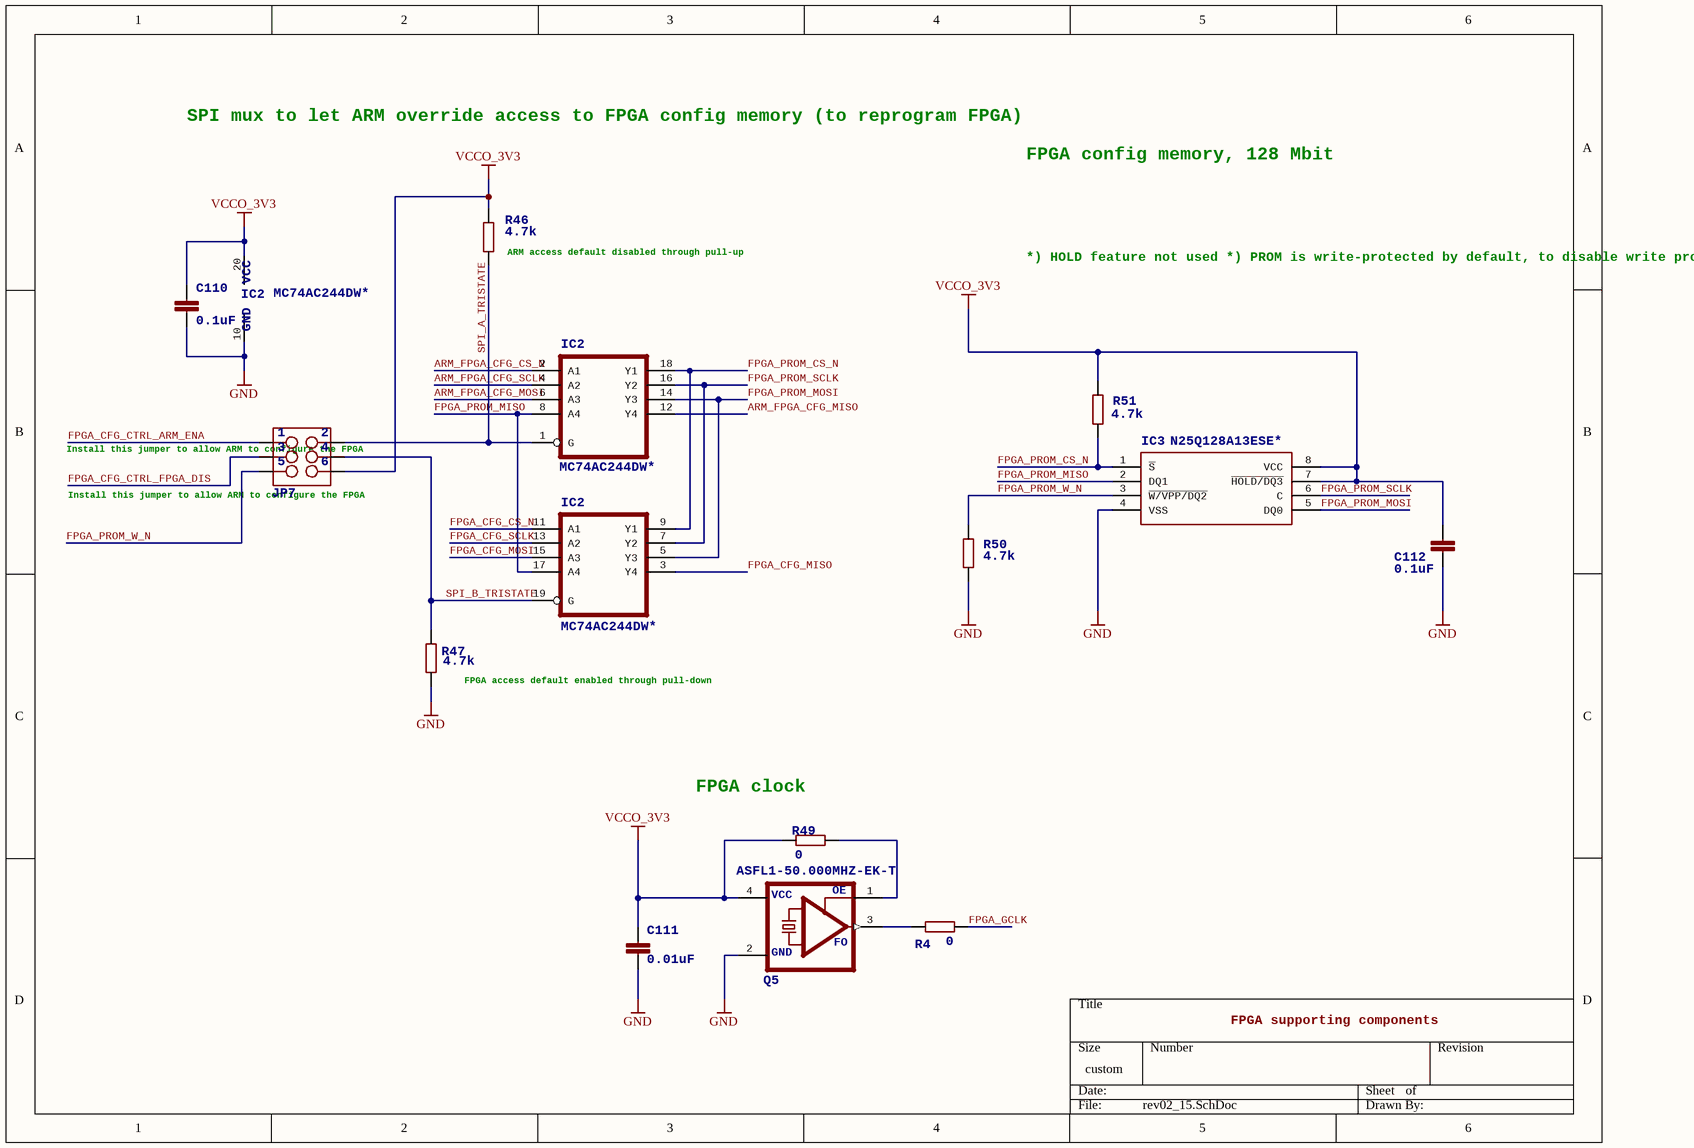
[diagram p17: rev02_15.SchDoc]

### Parts
C110  value 0.1uF  [C_0402]
C111  value 0.01uF  >NAME: C111  [C_0402]
C112  value 0.1uF  [C_0402]
IC2  MC74AC244DW*  >NAME: IC2  [SO20W]  (parts A,B,C of 3)
IC3  N25Q128A13ESE*  >Name: IC3  [SO08]
JP7  M03X2NO_SILK  [PLD-6]  (value not drawn)
Q5  ASFL1-50.000MHZ-EK-T  [ASF]
R4  value 0  >NAME: R4  [R_0402]
R46  value 4.7k  >NAME: R46  [R_0402]
R47  value 4.7k  >NAME: R47  [R_0402]
R49  value 0  >NAME: R49  [R_0402]
R50  value 4.7k  >NAME: R50  [R_0402]
R51  value 4.7k  >NAME: R51  [R_0402]

### Nets
GND: C110.2 C111.2 C112.2 IC2.10(GND) IC3.4(VSS) Q5.2(GND) R47.2 R50.1
VCCO_3V3: C110.1 C111.1 C112.1 IC2.20(VCC) IC3.7(~{HOLD/DQ3}) IC3.8(VCC) JP7.6 Q5.4(VCC) R46.2 R49.2 R51.2
ARM_FPGA_CFG_CS_N: IC2.2(A1)
ARM_FPGA_CFG_MISO: IC2.12(Y4)
ARM_FPGA_CFG_MOSI: IC2.6(A3)
ARM_FPGA_CFG_SCLK: IC2.4(A2)
FPGA_CFG_CS_N: IC2.11(A1)
FPGA_CFG_CTRL_ARM_ENA: JP7.1
FPGA_CFG_CTRL_FPGA_DIS: JP7.3
FPGA_CFG_MISO: IC2.3(Y4)
FPGA_CFG_MOSI: IC2.15(A3)
FPGA_CFG_SCLK: IC2.13(A2)
FPGA_GCLK: R4.1
FPGA_PROM_CS_N: IC2.9(Y1) IC2.18(Y1) IC3.1(~{S}) R51.1
FPGA_PROM_MISO: IC2.8(A4) IC2.17(A4) IC3.2(DQ1)
FPGA_PROM_MOSI: IC2.5(Y3) IC2.14(Y3) IC3.5(DQ0)
FPGA_PROM_SCLK: IC2.7(Y2) IC2.16(Y2) IC3.6(C)
FPGA_PROM_W_N: IC3.3(~{W/VPP/DQ2}) JP7.5 R50.2
SPI_A_TRISTATE: IC2.1(G) JP7.2 R46.1
SPI_B_TRISTATE: IC2.19(G) JP7.4 R47.1
NetQ5_1: Q5.1(OE) R49.1
NetQ5_3: Q5.3(FO) R4.2

### Notes on the sheet
- SPI mux to let ARM override access to
  FPGA config memory (to reprogram FPGA)
- FPGA config memory, 128 Mbit
- (near R46) ARM access default
  disabled through pull-up
- *) HOLD feature not used
  *) PROM is write-protected by default, to disable
  write protection (such as during firmware update),
  jumper must be inserted
- (near JP7) Install this jumper to allow
  ARM to configure the FPGA
- (near R47) FPGA access default
  enabled through pull-down
- (near R49) FPGA clock
- FPGA supporting components

### Library data of the parts
C110 C112 = C-EUC0402: 0402 CAPACITOR
C111 = C-EUC0402: as C4 on sheet rev02_1
IC2 = 74*244DW: Octal BUFFER and LINE DRIVER, 3-state; >VALUE: 74*244DW
IC3 = N25Q128A13ES: NOR Flash; OC_DIGIKEY: 557-1562-ND; OC_FARNELL: 2253682; PRICE100_DIGIKEY: 1.30470; PRICE100_FARNELL: 5.10; >Value: N25Q128A13ES
JP7 = M03X2NO_SILK: 2x3 .1" header; 1: 1; 2: 2; 3: 3; 4: 4; 5: 5; 6: 6
Q5 = ASF*: CRYSTAL CLOCK OSCILLATOR. 5.0 Vdc or 3.3 Vdc - LOW PROFILE ULTRA MINIATURE CERAMIC SURFACE MOUNT. / Source: http://www.abracon.com/Oscillators/asf1-L-L1.pdf; MPN: ASFL1-125.000MHZ-EC-T; MF: Abracon Corporation; OC_FARNELL: 1838931; OC_NEWARK: 19M1882; GND: GND; VCC: VCC; FO: FO; OE: OE
R4 R46 R47 R49-R51 = R-EU_R0402: 0402 Resistor 5%
  R46 R47 R50 R51: TOLERANCE: 5%

## Sheet rev02_16.SchDoc
size 282 x 200 mm
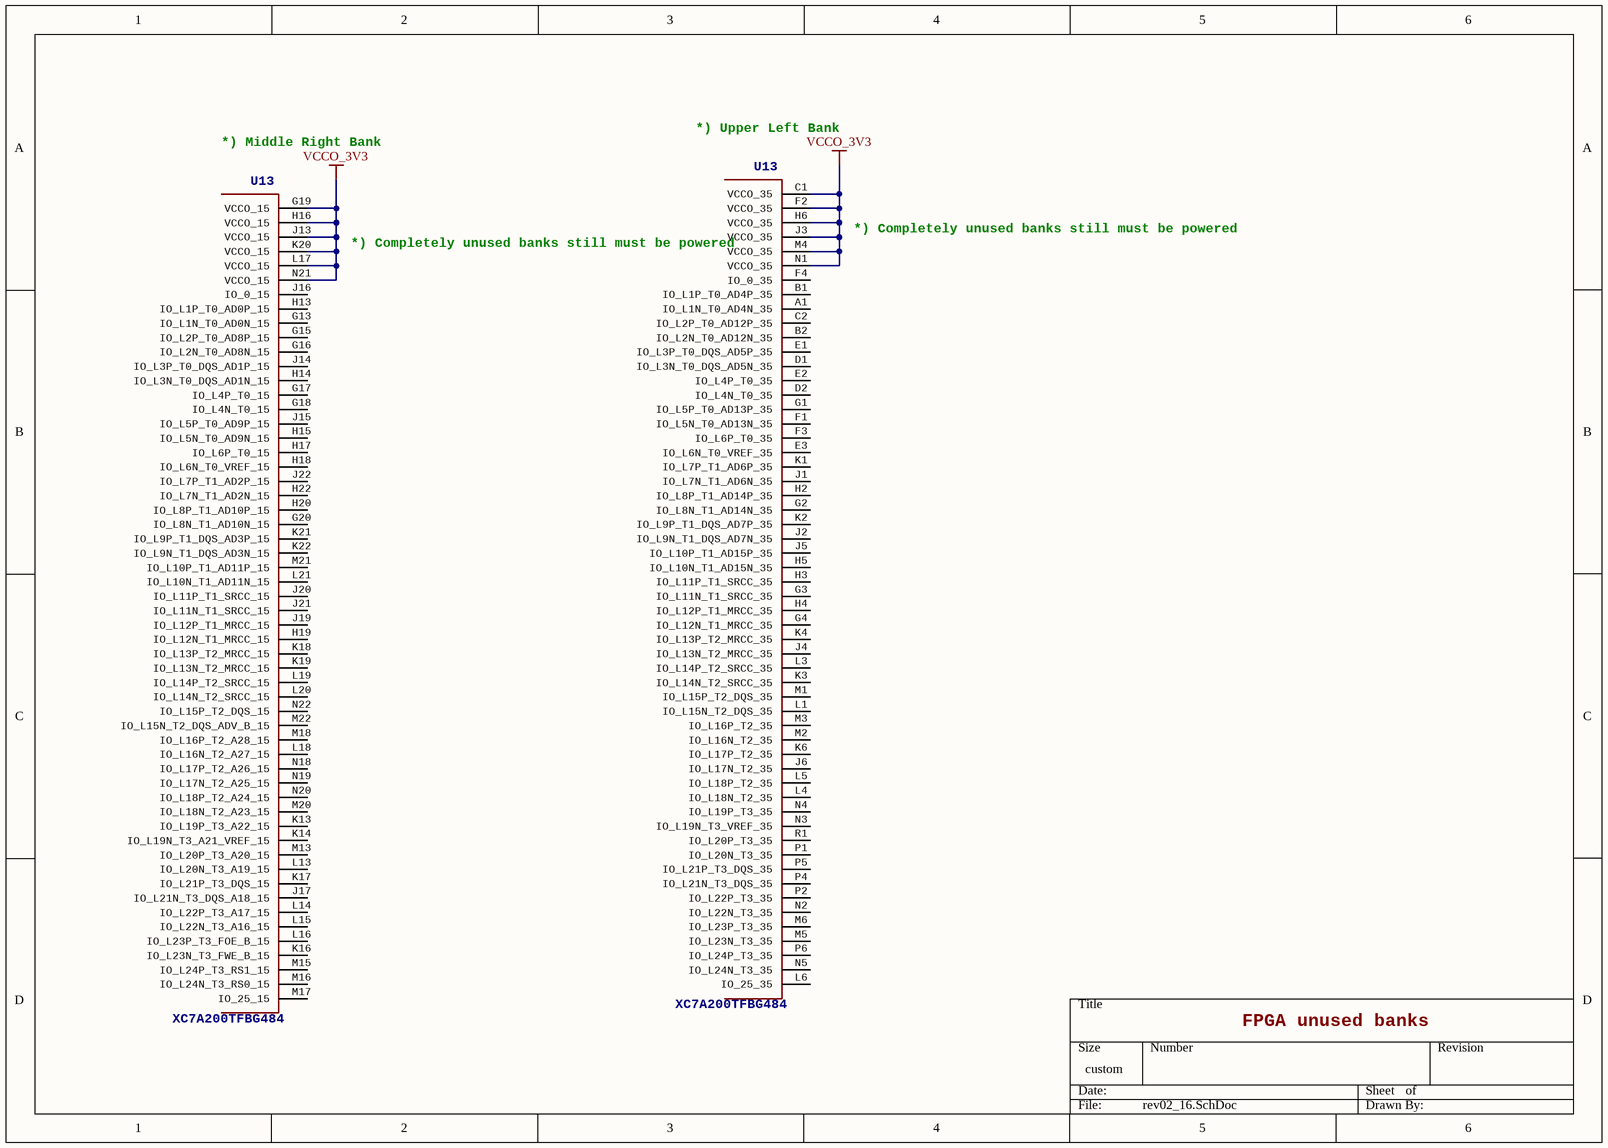
[diagram p18: rev02_16.SchDoc]

### Parts
U13  >NAME: U13  [BGA484C100P22X22_2300X2300X254]  (hidden comment: XC7A200TFBG484)  (parts D,G of 17)

### Nets
VCCO_3V3: U13.C1(VCCO_35) U13.F2(VCCO_35) U13.G19(VCCO_15) U13.H6(VCCO_35) U13.H16(VCCO_15) U13.J3(VCCO_35) U13.J13(VCCO_15) U13.K20(VCCO_15) U13.L17(VCCO_15) U13.M4(VCCO_35) U13.N1(VCCO_35) U13.N21(VCCO_15)

Not connected (* = marked no-connect by the designer): U13 A1(IO_L1N_T0_AD4N_35) B1(IO_L1P_T0_AD4P_35) B2(IO_L2N_T0_AD12N_35) C2(IO_L2P_T0_AD12P_35) D1(IO_L3N_T0_DQS_AD5N_35) D2(IO_L4N_T0_35) E1(IO_L3P_T0_DQS_AD5P_35) E2(IO_L4P_T0_35) E3(IO_L6N_T0_VREF_35) F1(IO_L5N_T0_AD13N_35) F3(IO_L6P_T0_35) F4(IO_0_35) G1(IO_L5P_T0_AD13P_35) G2(IO_L8N_T1_AD14N_35) G3(IO_L11N_T1_SRCC_35) G4(IO_L12N_T1_MRCC_35) G13(IO_L1N_T0_AD0N_15) G15(IO_L2P_T0_AD8P_15) G16(IO_L2N_T0_AD8N_15) G17(IO_L4P_T0_15) G18(IO_L4N_T0_15) G20(IO_L8N_T1_AD10N_15) H2(IO_L8P_T1_AD14P_35) H3(IO_L11P_T1_SRCC_35) H4(IO_L12P_T1_MRCC_35) H5(IO_L10N_T1_AD15N_35) H13(IO_L1P_T0_AD0P_15) H14(IO_L3N_T0_DQS_AD1N_15) H15(IO_L5N_T0_AD9N_15) H17(IO_L6P_T0_15) H18(IO_L6N_T0_VREF_15) H19(IO_L12N_T1_MRCC_15) H20(IO_L8P_T1_AD10P_15) H22(IO_L7N_T1_AD2N_15) J1(IO_L7N_T1_AD6N_35) J2(IO_L9N_T1_DQS_AD7N_35) J4(IO_L13N_T2_MRCC_35) J5(IO_L10P_T1_AD15P_35) J6(IO_L17N_T2_35) J14(IO_L3P_T0_DQS_AD1P_15) J15(IO_L5P_T0_AD9P_15) J16(IO_0_15) J17(IO_L21N_T3_DQS_A18_15) J19(IO_L12P_T1_MRCC_15) J20(IO_L11P_T1_SRCC_15) J21(IO_L11N_T1_SRCC_15) J22(IO_L7P_T1_AD2P_15) K1(IO_L7P_T1_AD6P_35) K2(IO_L9P_T1_DQS_AD7P_35) K3(IO_L14N_T2_SRCC_35) K4(IO_L13P_T2_MRCC_35) K6(IO_L17P_T2_35) K13(IO_L19P_T3_A22_15) K14(IO_L19N_T3_A21_VREF_15) K16(IO_L23N_T3_FWE_B_15) K17(IO_L21P_T3_DQS_15) K18(IO_L13P_T2_MRCC_15) K19(IO_L13N_T2_MRCC_15) K21(IO_L9P_T1_DQS_AD3P_15) K22(IO_L9N_T1_DQS_AD3N_15) L1(IO_L15N_T2_DQS_35) L3(IO_L14P_T2_SRCC_35) L4(IO_L18N_T2_35) L5(IO_L18P_T2_35) L6(IO_25_35) L13(IO_L20N_T3_A19_15) L14(IO_L22P_T3_A17_15) L15(IO_L22N_T3_A16_15) L16(IO_L23P_T3_FOE_B_15) L18(IO_L16N_T2_A27_15) L19(IO_L14P_T2_SRCC_15) L20(IO_L14N_T2_SRCC_15) L21(IO_L10N_T1_AD11N_15) M1(IO_L15P_T2_DQS_35) M2(IO_L16N_T2_35) M3(IO_L16P_T2_35) M5(IO_L23N_T3_35) M6(IO_L23P_T3_35) M13(IO_L20P_T3_A20_15) M15(IO_L24P_T3_RS1_15) M16(IO_L24N_T3_RS0_15) M17(IO_25_15) M18(IO_L16P_T2_A28_15) M20(IO_L18N_T2_A23_15) M21(IO_L10P_T1_AD11P_15) M22(IO_L15N_T2_DQS_ADV_B_15) N2(IO_L22N_T3_35) N3(IO_L19N_T3_VREF_35) N4(IO_L19P_T3_35) N5(IO_L24N_T3_35) N18(IO_L17P_T2_A26_15) N19(IO_L17N_T2_A25_15) N20(IO_L18P_T2_A24_15) N22(IO_L15P_T2_DQS_15) P1(IO_L20N_T3_35) P2(IO_L22P_T3_35) P4(IO_L21N_T3_DQS_35) P5(IO_L21P_T3_DQS_35) P6(IO_L24P_T3_35) R1(IO_L20P_T3_35)

### Notes on the sheet
- *) Middle Right Bank
- *) Upper Left Bank
- *) Completely unused banks
  still must be powered
- FPGA unused banks

### Library data of the parts
U13 = XC7A200TFBG484: as U13 on sheet rev02_13; MFR: Xilinx; OC_DIGIKEY: 122-1871-ND; >VALUE: XC7A200TFBG484

## Sheet rev02_17.SchDoc
size 282 x 200 mm
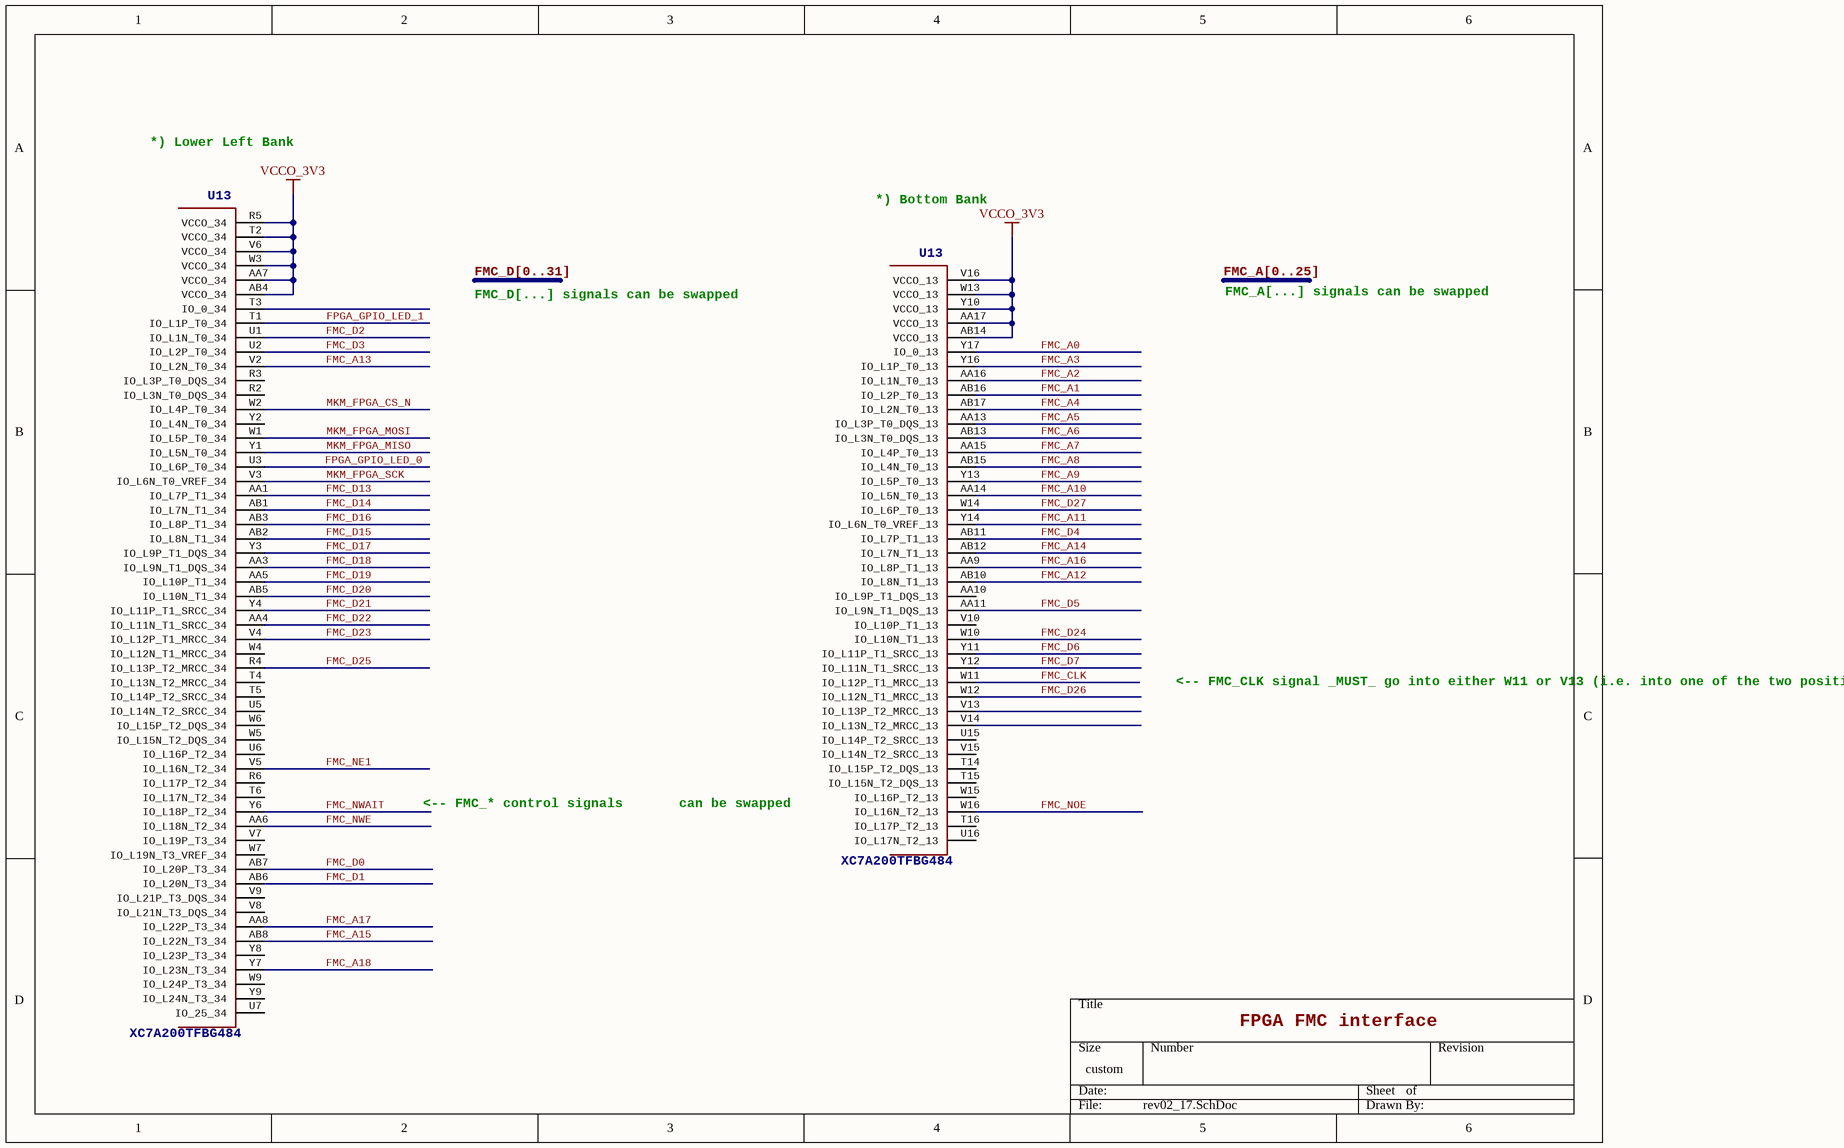
[diagram p19: rev02_17.SchDoc]

### Parts
U13  >NAME: U13  [BGA484C100P22X22_2300X2300X254]  (hidden comment: XC7A200TFBG484)  (parts B,F of 17)

### Nets
VCCO_3V3: U13.AA7(VCCO_34) U13.AA17(VCCO_13) U13.AB4(VCCO_34) U13.AB14(VCCO_13) U13.R5(VCCO_34) U13.T2(VCCO_34) U13.V6(VCCO_34) U13.V16(VCCO_13) U13.W3(VCCO_34) U13.W13(VCCO_13) U13.Y10(VCCO_13)
FMC_A0: U13.Y17(IO_0_13)
FMC_A1: U13.AB16(IO_L2P_T0_13)
FMC_A2: U13.AA16(IO_L1N_T0_13)
FMC_A3: U13.Y16(IO_L1P_T0_13)
FMC_A4: U13.AB17(IO_L2N_T0_13)
FMC_A5: U13.AA13(IO_L3P_T0_DQS_13)
FMC_A6: U13.AB13(IO_L3N_T0_DQS_13)
FMC_A7: U13.AA15(IO_L4P_T0_13)
FMC_A8: U13.AB15(IO_L4N_T0_13)
FMC_A9: U13.Y13(IO_L5P_T0_13)
FMC_A10: U13.AA14(IO_L5N_T0_13)
FMC_A11: U13.Y14(IO_L6N_T0_VREF_13)
FMC_A12: U13.AB10(IO_L8N_T1_13)
FMC_A13: U13.V2(IO_L2N_T0_34)
FMC_A14: U13.AB12(IO_L7N_T1_13)
FMC_A15: U13.AB8(IO_L22N_T3_34)
FMC_A16: U13.AA9(IO_L8P_T1_13)
FMC_A17: U13.AA8(IO_L22P_T3_34)
FMC_A18: U13.Y7(IO_L23N_T3_34)
FMC_CLK: U13.W11(IO_L12P_T1_MRCC_13)
FMC_D0: U13.AB7(IO_L20P_T3_34)
FMC_D1: U13.AB6(IO_L20N_T3_34)
FMC_D2: U13.U1(IO_L1N_T0_34)
FMC_D3: U13.U2(IO_L2P_T0_34)
FMC_D4: U13.AB11(IO_L7P_T1_13)
FMC_D5: U13.AA11(IO_L9N_T1_DQS_13)
FMC_D6: U13.Y11(IO_L11P_T1_SRCC_13)
FMC_D7: U13.Y12(IO_L11N_T1_SRCC_13)
FMC_D13: U13.AA1(IO_L7P_T1_34)
FMC_D14: U13.AB1(IO_L7N_T1_34)
FMC_D15: U13.AB2(IO_L8N_T1_34)
FMC_D16: U13.AB3(IO_L8P_T1_34)
FMC_D17: U13.Y3(IO_L9P_T1_DQS_34)
FMC_D18: U13.AA3(IO_L9N_T1_DQS_34)
FMC_D19: U13.AA5(IO_L10P_T1_34)
FMC_D20: U13.AB5(IO_L10N_T1_34)
FMC_D21: U13.Y4(IO_L11P_T1_SRCC_34)
FMC_D22: U13.AA4(IO_L11N_T1_SRCC_34)
FMC_D23: U13.V4(IO_L12P_T1_MRCC_34)
FMC_D24: U13.W10(IO_L10N_T1_13)
FMC_D25: U13.R4(IO_L13P_T2_MRCC_34)
FMC_D26: U13.W12(IO_L12N_T1_MRCC_13)
FMC_D27: U13.W14(IO_L6P_T0_13)
FMC_NE1: U13.V5(IO_L16N_T2_34)
FMC_NOE: U13.W16(IO_L16N_T2_13)
FMC_NWAIT: U13.Y6(IO_L18P_T2_34)
FMC_NWE: U13.AA6(IO_L18N_T2_34)
FPGA_GPIO_LED_0: U13.U3(IO_L6P_T0_34)
FPGA_GPIO_LED_1: U13.T1(IO_L1P_T0_34)
MKM_FPGA_CS_N: U13.W2(IO_L4P_T0_34)
MKM_FPGA_MISO: U13.Y1(IO_L5N_T0_34)
MKM_FPGA_MOSI: U13.W1(IO_L5P_T0_34)
MKM_FPGA_SCK: U13.V3(IO_L6N_T0_VREF_34)

Not connected (* = marked no-connect by the designer): U13 AA10(IO_L9P_T1_DQS_13) R2(IO_L3N_T0_DQS_34) R3(IO_L3P_T0_DQS_34) R6(IO_L17P_T2_34) T3(IO_0_34) T4(IO_L13N_T2_MRCC_34) T5(IO_L14P_T2_SRCC_34) T6(IO_L17N_T2_34) T14(IO_L15P_T2_DQS_13) T15(IO_L15N_T2_DQS_13) T16(IO_L17P_T2_13) U5(IO_L14N_T2_SRCC_34) U6(IO_L16P_T2_34) U7(IO_25_34) U15(IO_L14P_T2_SRCC_13) U16(IO_L17N_T2_13) V7(IO_L19P_T3_34) V8(IO_L21N_T3_DQS_34) V9(IO_L21P_T3_DQS_34) V10(IO_L10P_T1_13) V13(IO_L13P_T2_MRCC_13) V14(IO_L13N_T2_MRCC_13) V15(IO_L14N_T2_SRCC_13) W4(IO_L12N_T1_MRCC_34) W5(IO_L15N_T2_DQS_34) W6(IO_L15P_T2_DQS_34) W7(IO_L19N_T3_VREF_34) W9(IO_L24P_T3_34) W15(IO_L16P_T2_13) Y2(IO_L4N_T0_34) Y8(IO_L23P_T3_34) Y9(IO_L24N_T3_34)

### Buses and harness runs
bus FMC_A[0..25]
bus FMC_D[0..31]

### Notes on the sheet
- *) Lower Left Bank
- *) Bottom Bank
- FMC_D[...] signals can be swapped
- FMC_A[...] signals can be swapped
- <-- FMC_CLK signal _MUST_ go
  into either W11 or V13 (i.e. into
  one of the two positive (master)
  sides of the two available
  MRCC differential pairs)
- <-- FMC_* control signals
  can be swapped
- FPGA FMC interface

### Library data of the parts
U13 = XC7A200TFBG484: as U13 on sheet rev02_13; MFR: Xilinx; OC_DIGIKEY: 122-1871-ND; >VALUE: XC7A200TFBG484